# Altium project RK3288.PrjPcb (part 1 of 2)
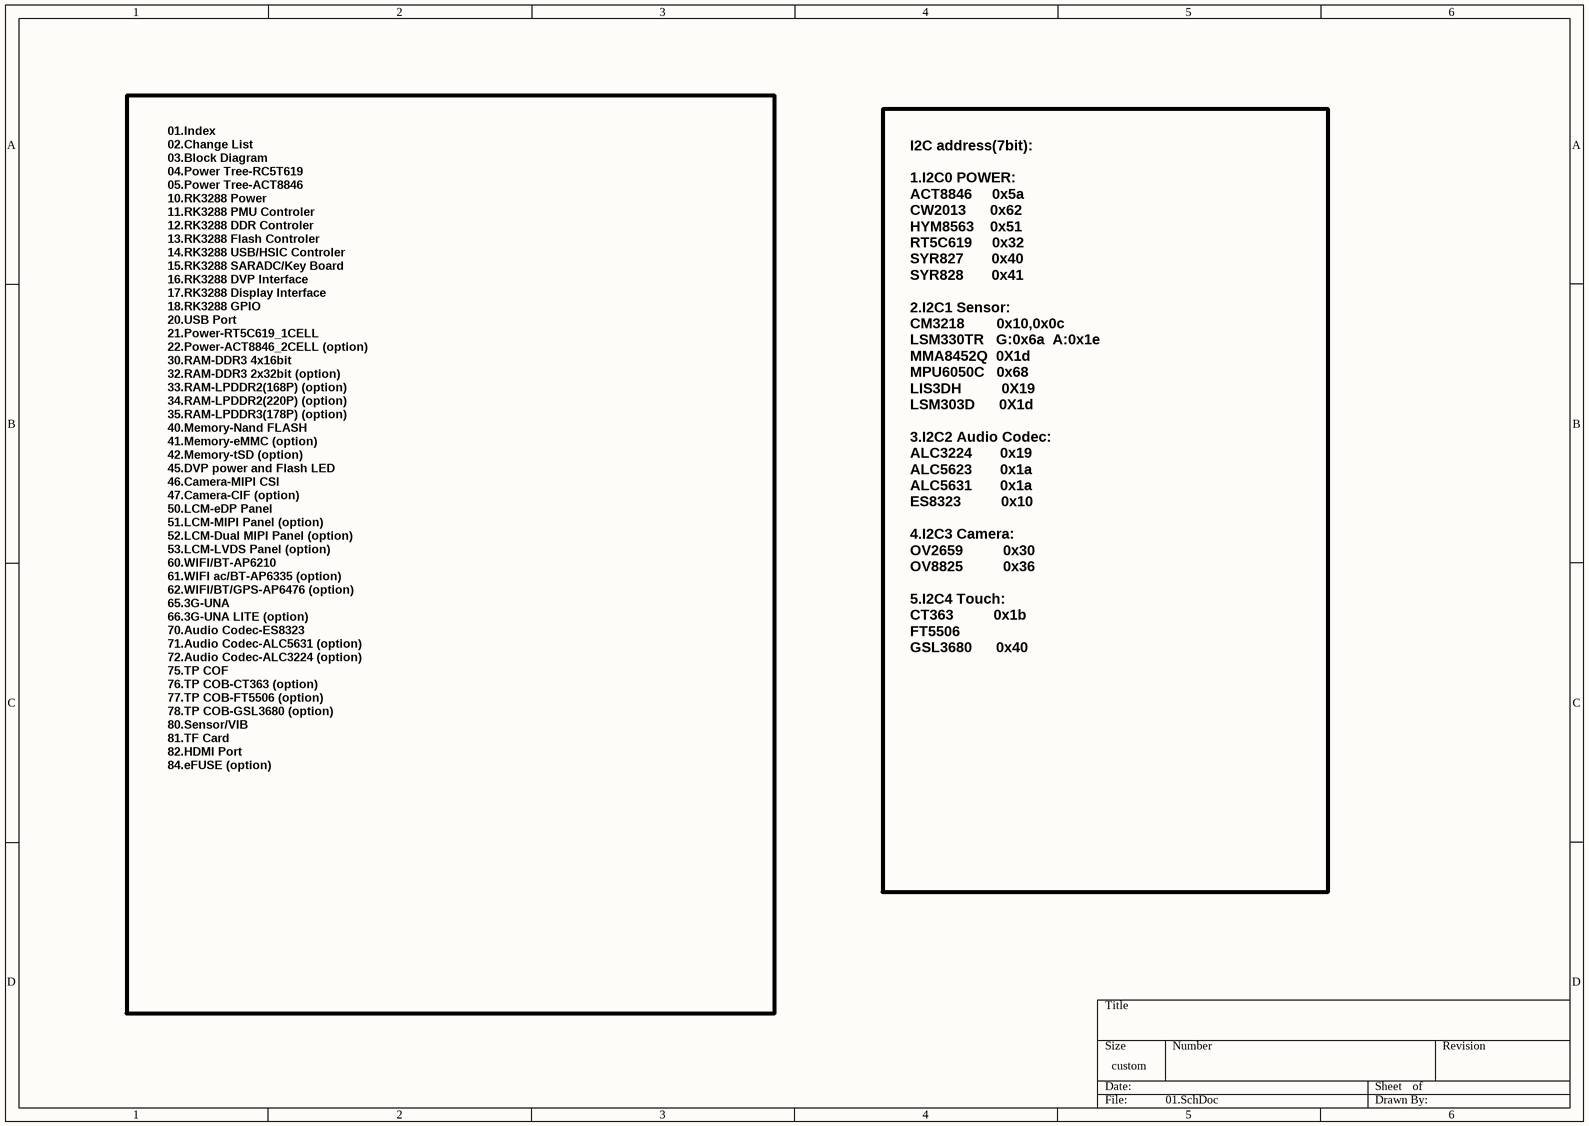
[diagram p0: 01.SchDoc]
24 sheets, 575 parts. Net scope: global (net labels, ports and power ports of the same name join across sheets).
Sheets:
  01.SchDoc
  02.SchDoc
  03.SchDoc
  04.SchDoc
  05.SchDoc
  06.SchDoc
  07.SchDoc
  08.SchDoc
  09.SchDoc
  10.SchDoc
  11.SchDoc
  13.SchDoc
  14.SchDoc
  15.SchDoc
  16.SchDoc
  17.SchDoc
  18.SchDoc
  19.SchDoc
  20.SchDoc
  21.SchDoc
  22.SchDoc
  23.SchDoc
  24.SchDoc
  25.SchDoc

## Sheet 01.SchDoc
size 297 x 209 mm

### Notes on the sheet
- 01.Index
  02.Change List
  03.Block Diagram
  04.Power Tree-RC5T619
  05.Power Tree-ACT8846
  10.RK3288 Power
  11.RK3288 PMU Controler
  12.RK3288 DDR Controler
  13.RK3288 Flash Controler
  14.RK3288 USB/HSIC Controler
  15.RK3288 SARADC/Key Board
  16.RK3288 DVP Interface
  17.RK3288 Display Interface
  18.RK3288 GPIO
  20.USB Port
  21.Power-RT5C619_1CELL
  22.Power-ACT8846_2CELL (option)
  30.RAM-DDR3 4x16bit
  32.RAM-DDR3 2x32bit (option)
  33.RAM-LPDDR2(168P) (option)
  34.RAM-LPDDR2(220P) (option)
  35.RAM-LPDDR3(178P) (option)
  40.Memory-Nand FLASH
  41.Memory-eMMC (option)
  42.Memory-tSD (option)
  45.DVP power and Flash LED
  46.Camera-MIPI CSI
  47.Camera-CIF (option)
  50.LCM-eDP Panel
  51.LCM-MIPI Panel (option)
  52.LCM-Dual MIPI Panel (option)
  53.LCM-LVDS Panel (option)
  60.WIFI/BT-AP6210
  61.WIFI ac/BT-AP6335 (option)
  62.WIFI/BT/GPS-AP6476 (option)
  65.3G-UNA
  66.3G-UNA LITE (option)
  70.Audio Codec-ES8323
  71.Audio Codec-ALC5631 (option)
  72.Audio Codec-ALC3224 (option)
  75.TP COF
  76.TP COB-CT363 (option)
  77.TP COB-FT5506 (option)
  78.TP COB-GSL3680 (option)
  80.Sensor/VIB
  81.TF Card
  82.HDMI Port
  84.eFUSE (option)
- I2C address(7bit):
  1.I2C0 POWER:
  ACT8846     0x5a
  CW2013      0x62
  HYM8563    0x51
  RT5C619     0x32
  SYR827       0x40
  SYR828       0x41
  2.I2C1 Sensor:
  CM3218        0x10,0x0c
  LSM330TR   G:0x6a  A:0x1e
  MMA8452Q  0X1d
  MPU6050C   0x68
  LIS3DH          0X19
  LSM303D      0X1d
  3.I2C2 Audio Codec:
  ALC3224       0x19
  ALC5623       0x1a
  ALC5631       0x1a
  ES8323          0x10
  4.I2C3 Camera:
  OV2659          0x30
  OV8825          0x36
  5.I2C4 Touch:
  CT363          0x1b
  FT5506
  GSL3680      0x40

## Sheet 02.SchDoc
size 297 x 209 mm
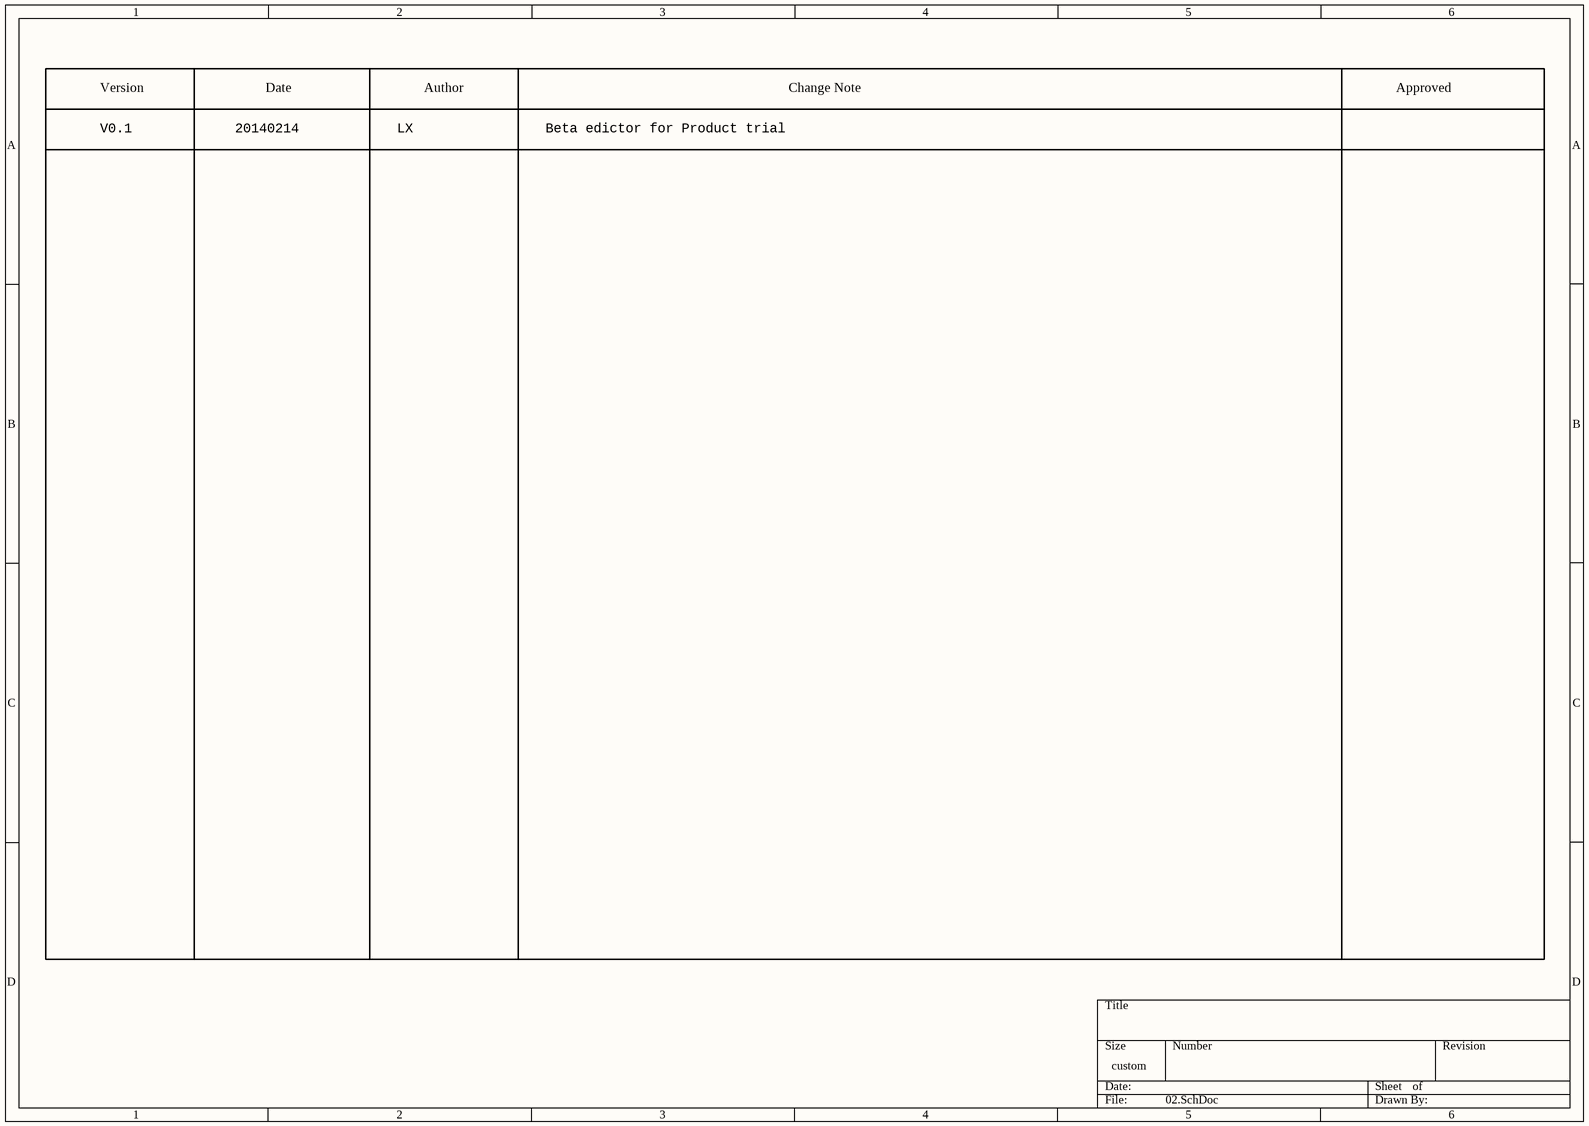
[diagram p1: 02.SchDoc]

### Notes on the sheet
- Version
- V0.1
- 20140214
- Date
- LX
- Author
- Beta edictor for Product trial
- Change Note
- Approved

## Sheet 03.SchDoc
size 420 x 297 mm
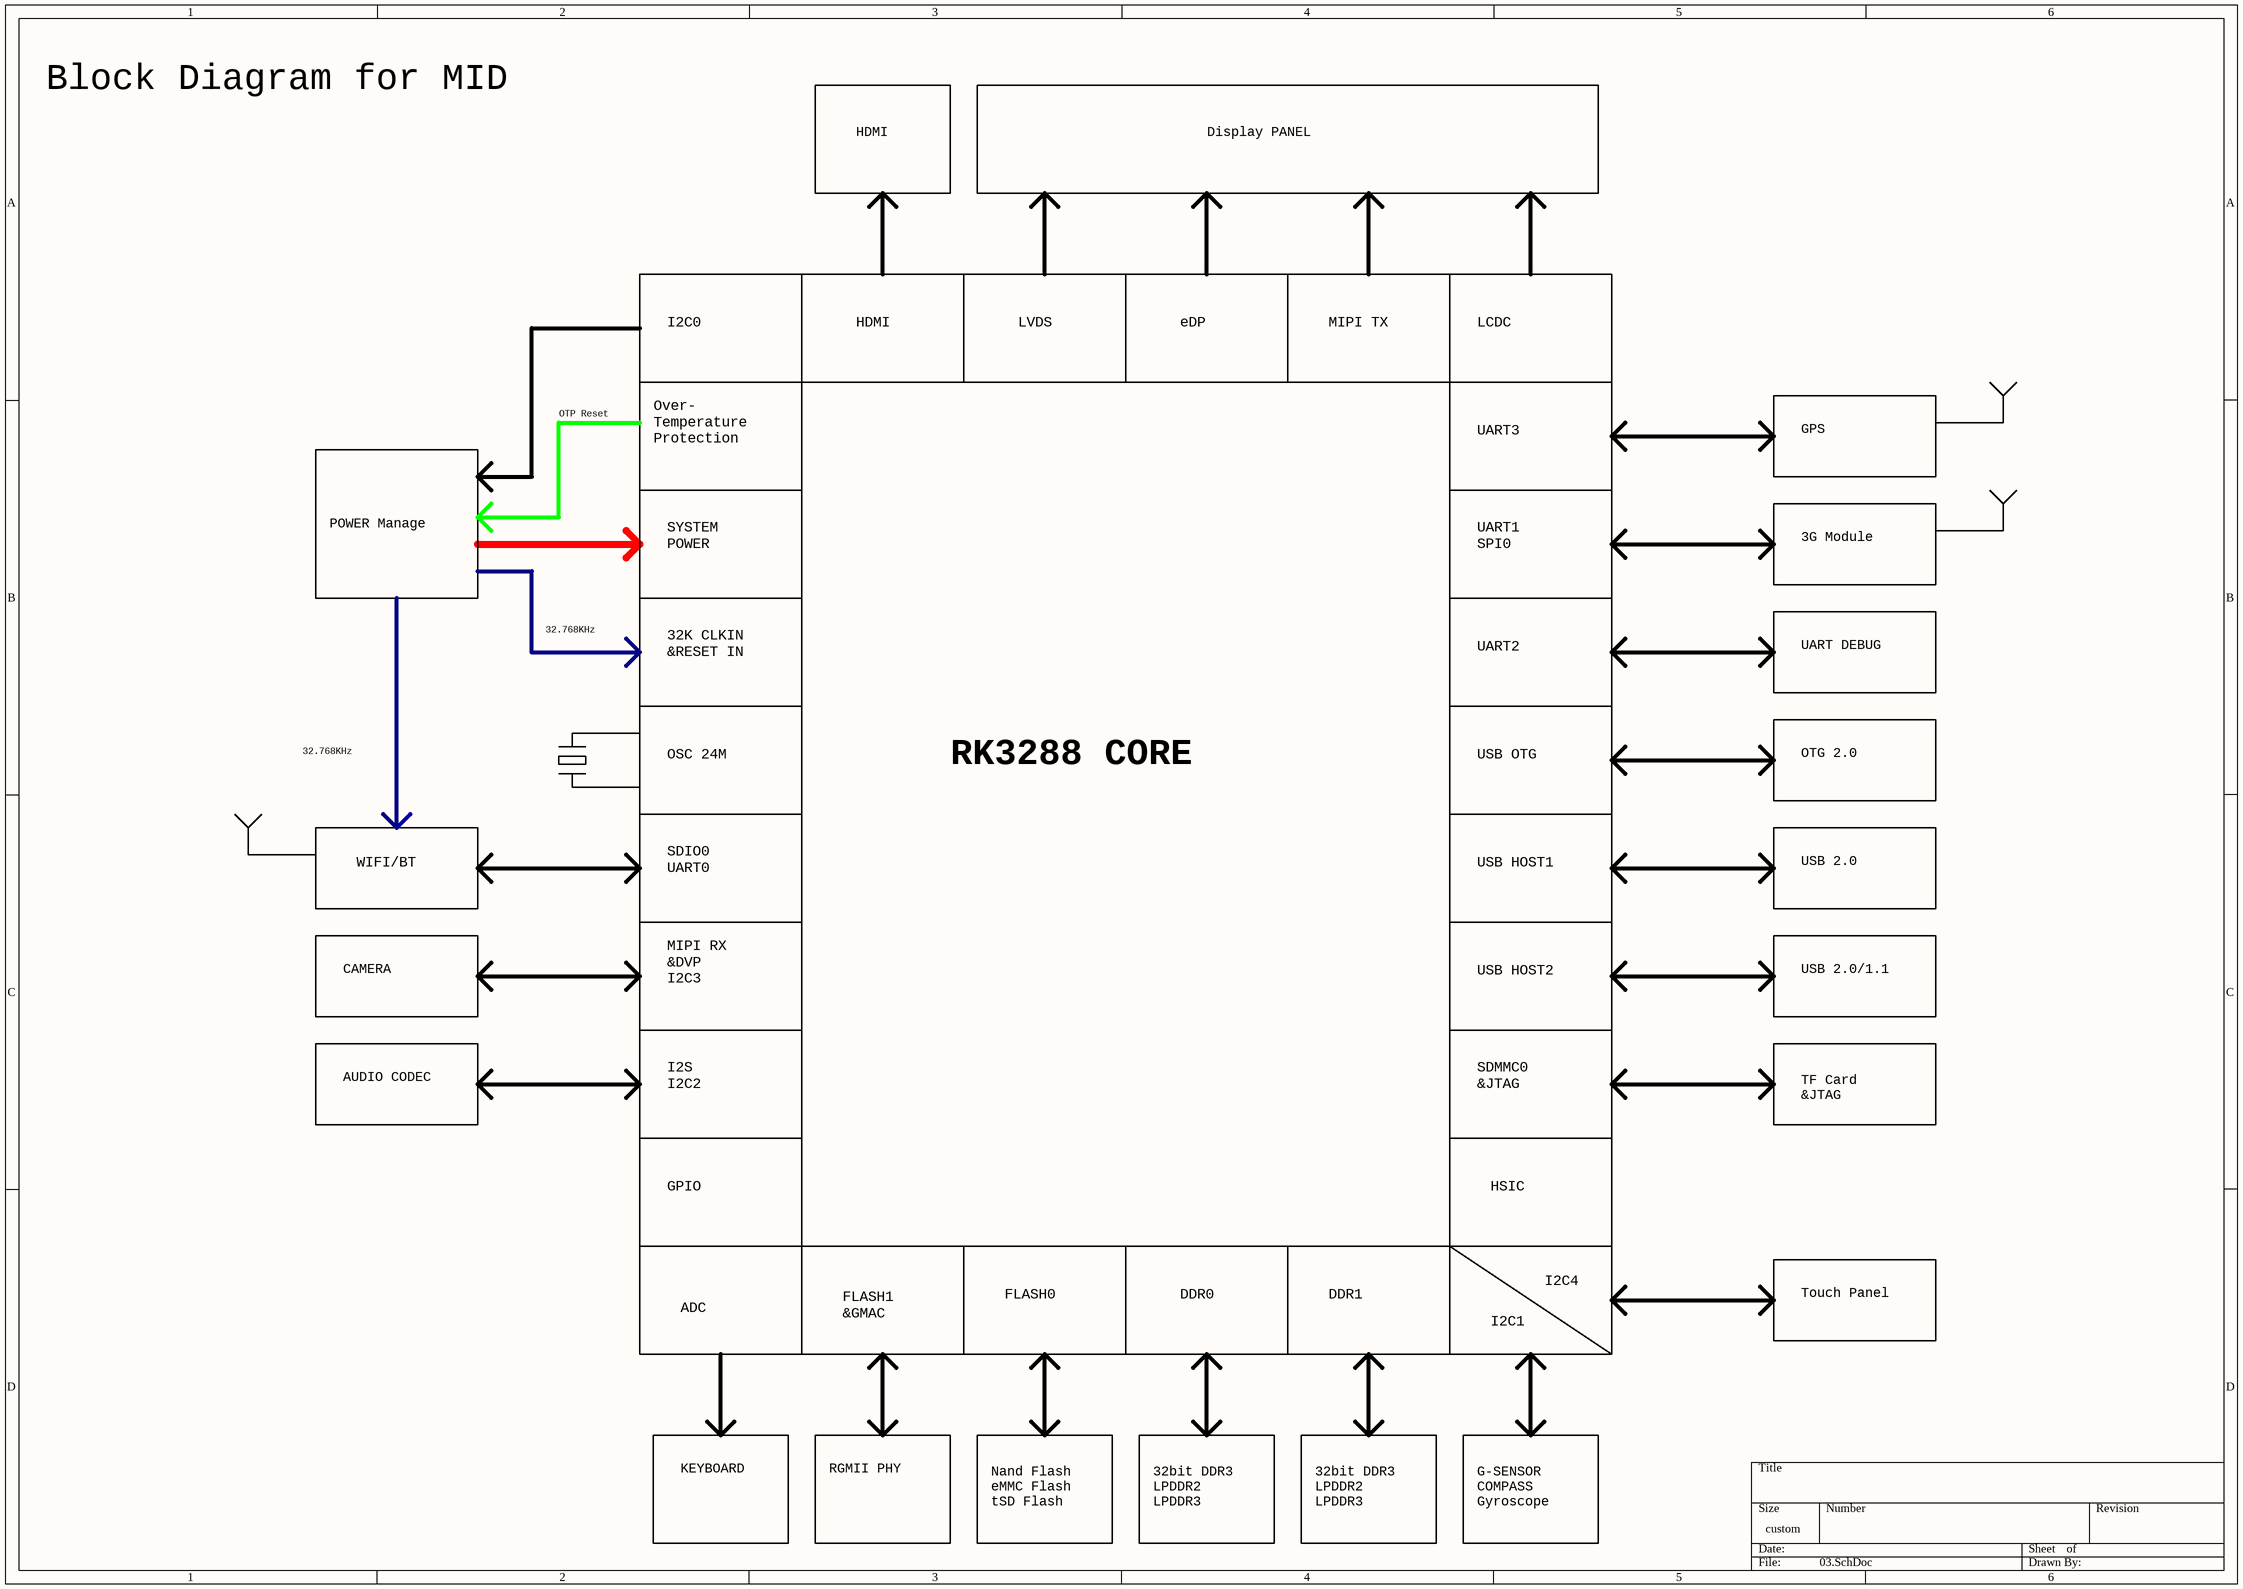
[diagram p2: 03.SchDoc]

### Notes on the sheet
- Block Diagram for MID
- HDMI
- Display PANEL
- I2C0
- LVDS
- eDP
- MIPI TX
- LCDC
- Over-
  Temperature
  Protection
- OTP Reset
- UART3
- GPS
- POWER Manage
- SYSTEM
  POWER
- UART1
  SPI0
- 3G Module
- 32.768KHz
- 32K CLKIN
  &RESET IN
- UART2
- UART DEBUG
- OSC 24M
- RK3288 CORE
- USB OTG
- OTG 2.0
- WIFI/BT
- SDIO0
  UART0
- USB HOST1
- USB 2.0
- MIPI RX
  &DVP
  I2C3
- CAMERA
- USB HOST2
- USB 2.0/1.1
- I2S
  I2C2
- SDMMC0
  &JTAG
- TF Card
  &JTAG
- AUDIO CODEC
- GPIO
- HSIC
- ADC
- FLASH1
  &GMAC
- FLASH0
- DDR0
- DDR1
- I2C1
- I2C4
- Touch Panel
- KEYBOARD
- RGMII PHY
- Nand Flash
  eMMC Flash
  tSD Flash
- 32bit DDR3
  LPDDR2
  LPDDR3
- G-SENSOR
  COMPASS
  Gyroscope

## Sheet 04.SchDoc
size 420 x 297 mm
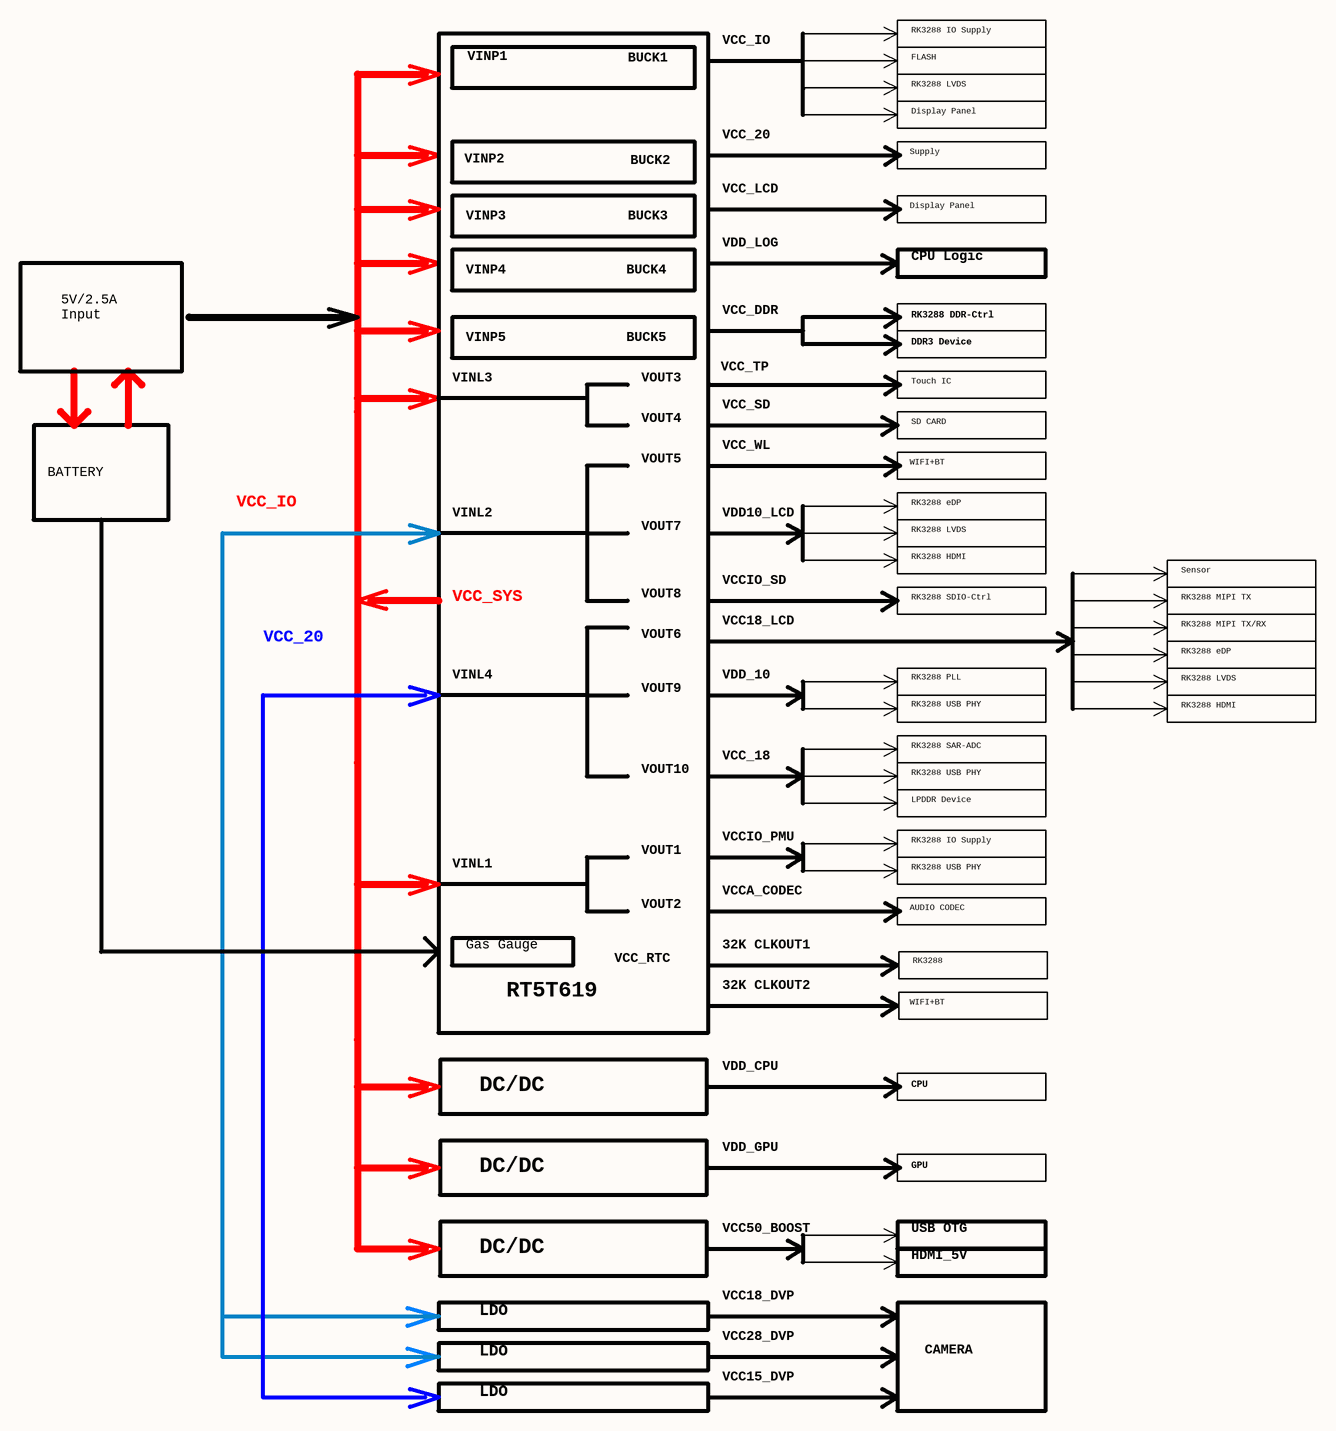
[diagram p3: 04.SchDoc]

### Notes on the sheet
- VINP1
- BUCK1
- VCC_IO
- RK3288 IO Supply
- FLASH
- VCC_20
- RK3288 LVDS
- Display Panel
- VINP2
- BUCK2
- VCC_LCD
- Supply
- VINP4
- VINP3
- BUCK4
- BUCK3
- VDD_LOG
- CPU Logic
- 5V/2.5A
  Input
- VINP5
- BUCK5
- VCC_DDR
- RK3288 DDR-Ctrl
- DDR3 Device
- VINL3
- VOUT3
- VCC_TP
- VCC_SD
- Touch IC
- BATTERY
- VOUT4
- VOUT5
- VCC_WL
- WIFI+BT
- SD CARD
- VINL2
- VOUT7
- VDD10_LCD
- RK3288 eDP
- VCC_SYS
- VOUT8
- VCCIO_SD
- RK3288 HDMI
- RK3288 SDIO-Ctrl
- RK3288 MIPI TX
- Sensor
- VINL4
- VOUT6
- VCC18_LCD
- VDD_10
- RK3288 PLL
- RK3288 MIPI TX/RX
- VOUT9
- RK3288 SAR-ADC
- RK3288 USB PHY
- VOUT10
- VCC_18
- LPDDR Device
- VINL1
- VOUT1
- VCCIO_PMU
- Gas Gauge
- VOUT2
- VCCA_CODEC
- 32K CLKOUT1
- AUDIO CODEC
- RT5T619
- VCC_RTC
- 32K CLKOUT2
- RK3288
- VDD_CPU
- CPU
- DC/DC
- VDD_GPU
- GPU
- VCC50_BOOST
- USB OTG
- HDMI_5V
- LDO
- VCC18_DVP
- VCC28_DVP
- CAMERA
- VCC15_DVP

## Sheet 05.SchDoc
size 496 x 347 mm
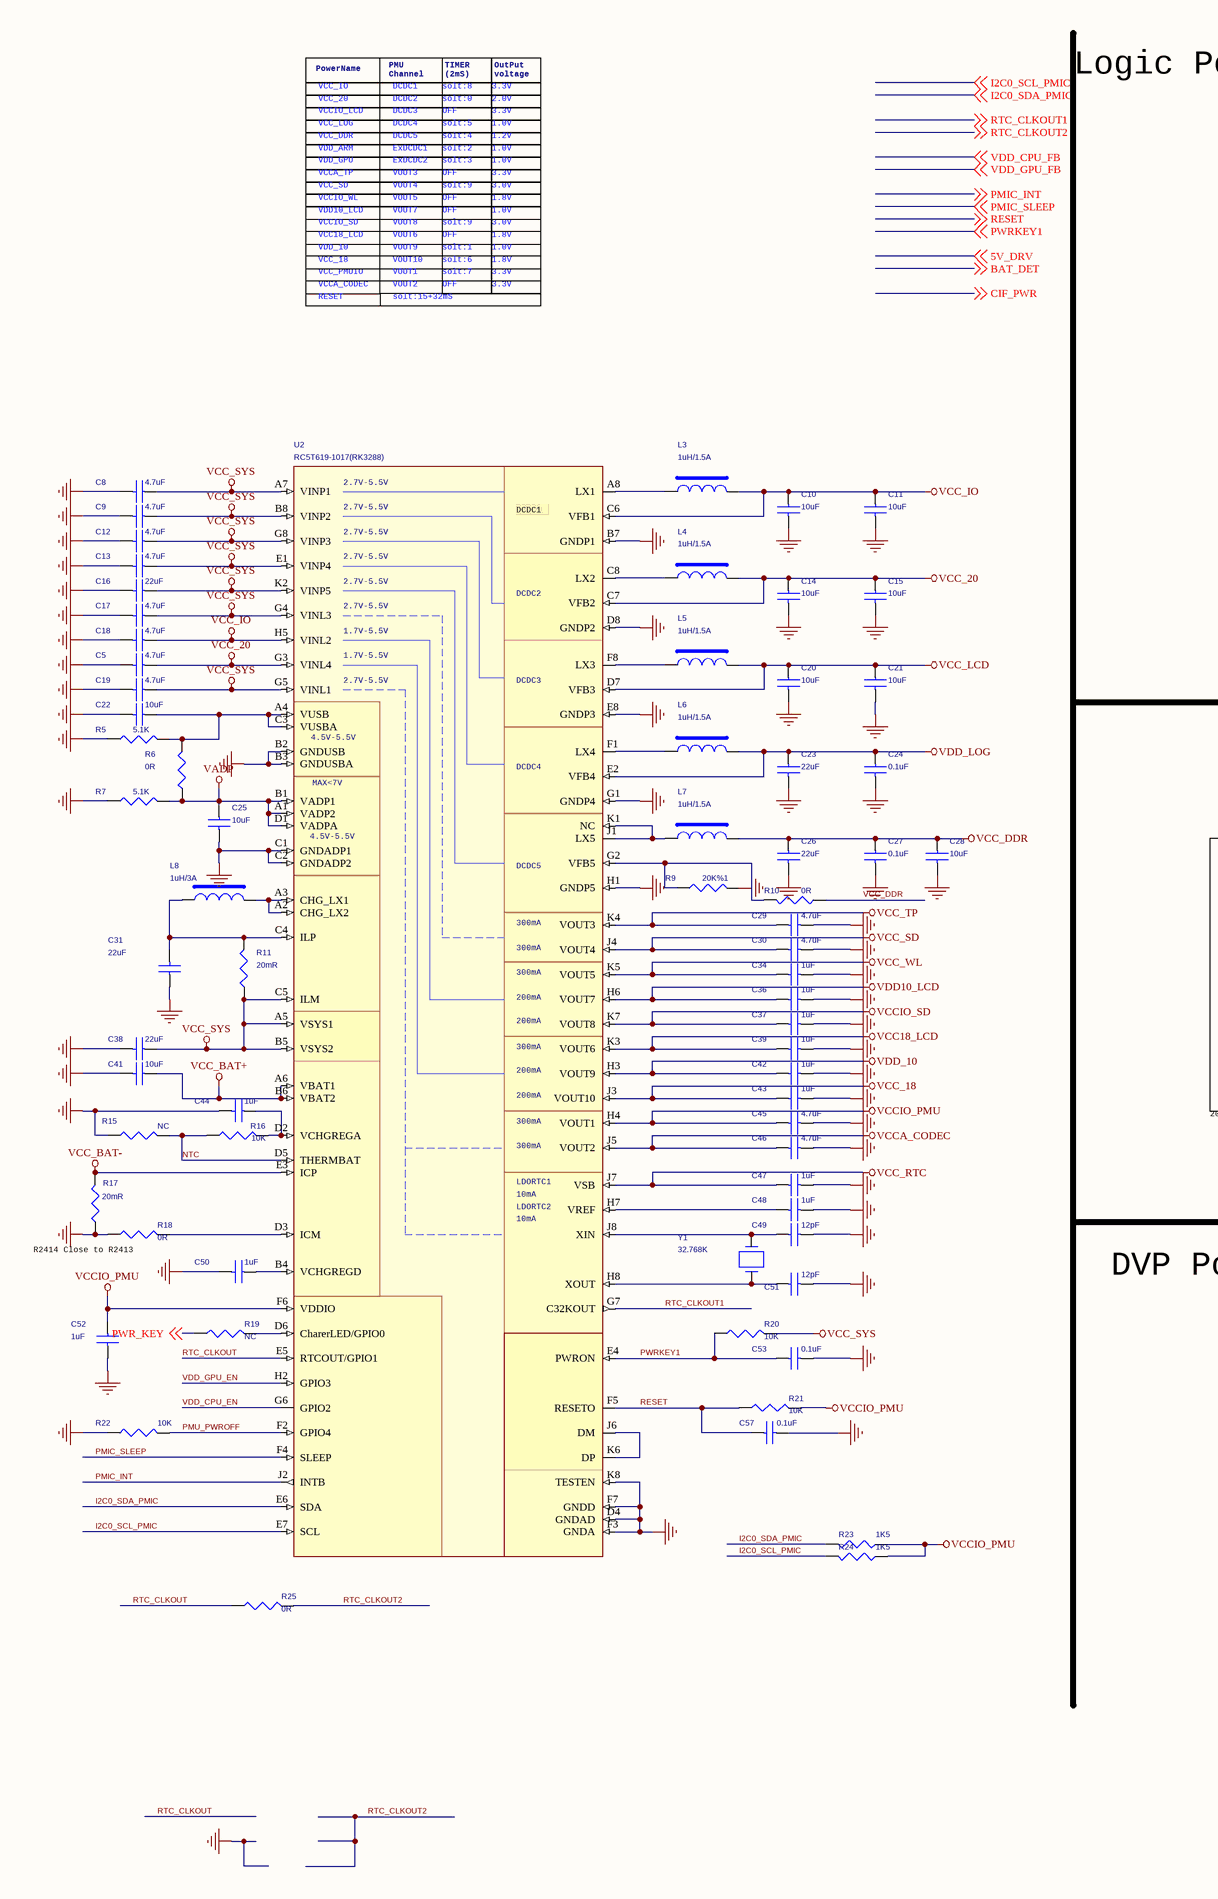
[diagram p4: 05.SchDoc, left]
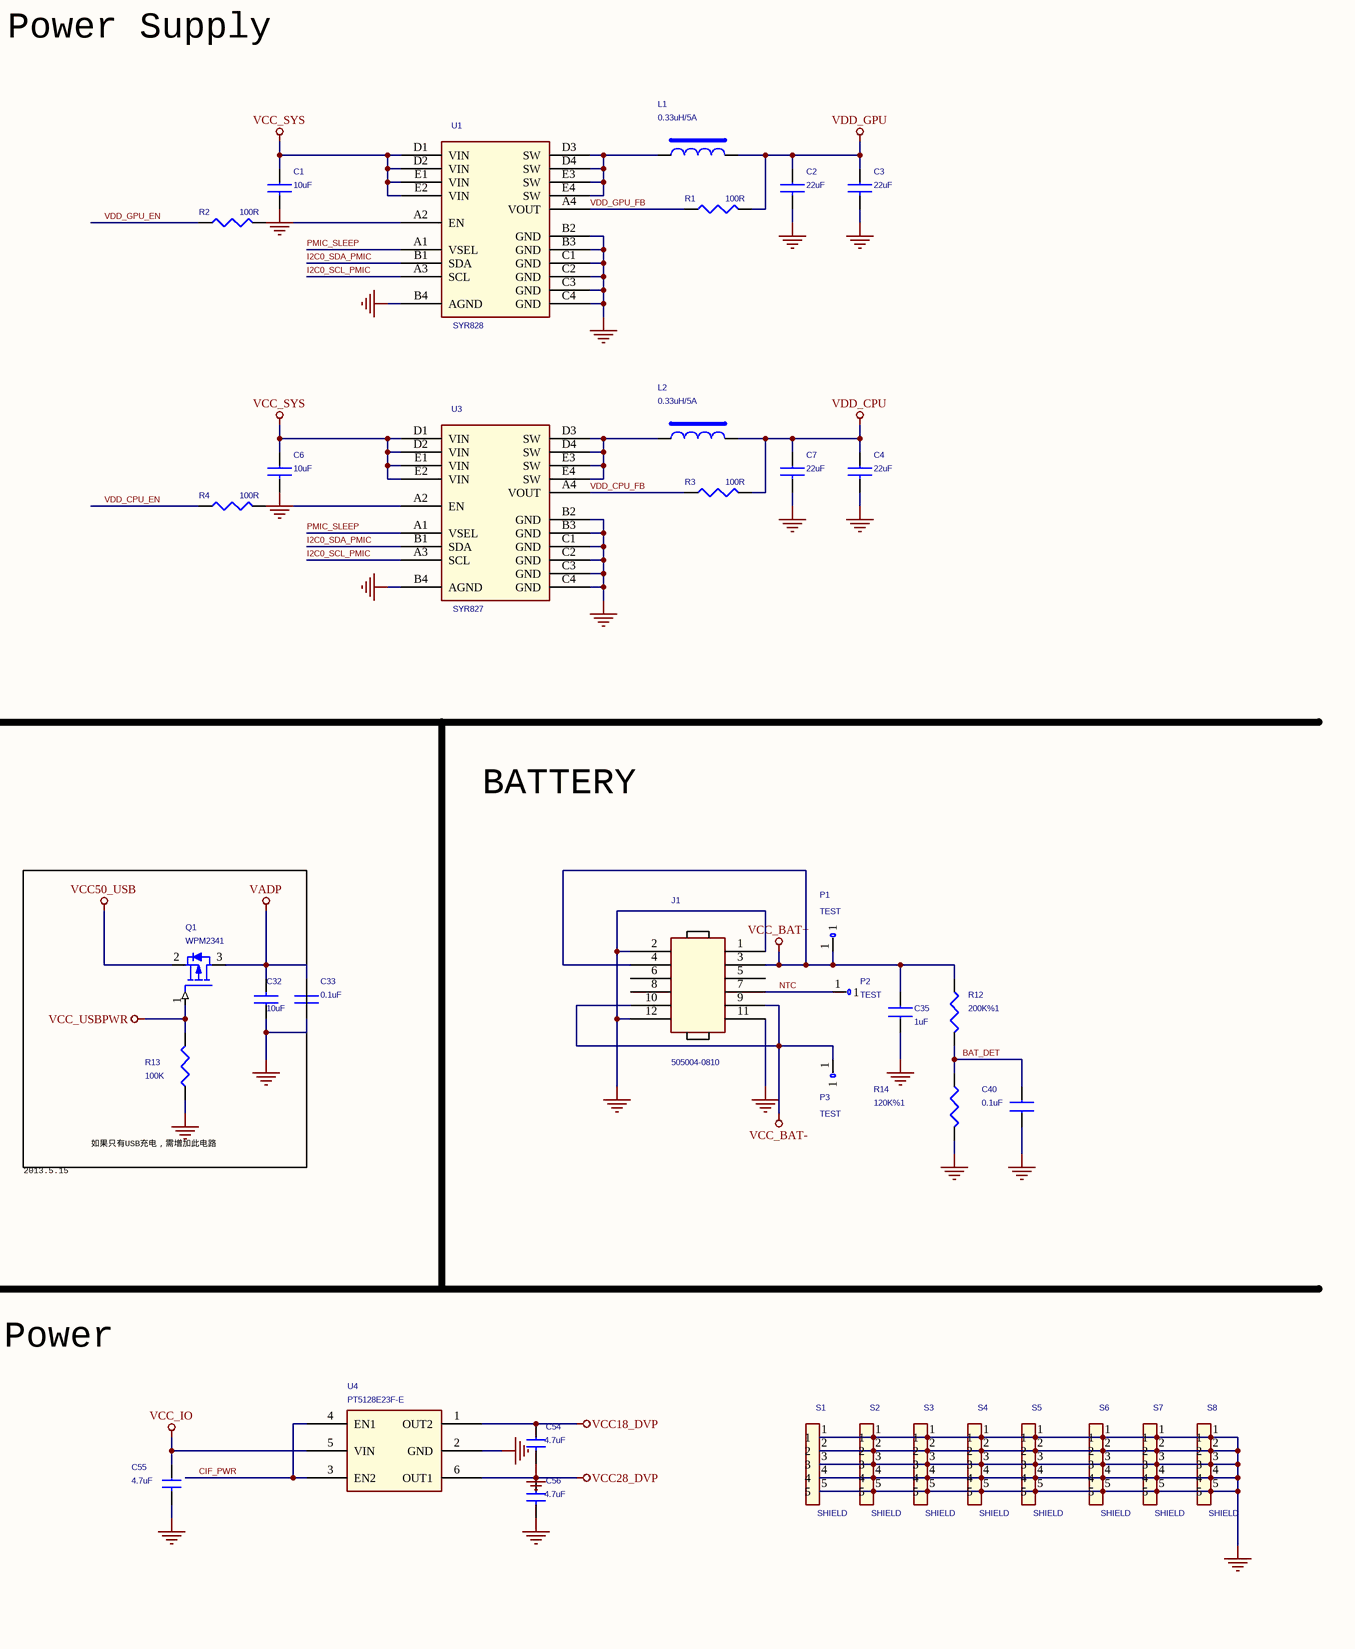
[diagram p5: 05.SchDoc, right]

### Parts
C1  10uF  [C0603]
C2  22uF  [C0805]
C3  22uF  [C0805]
C4  22uF  [C0805]
C5  4.7uF  [C0603]
C6  10uF  [C0603]
C7  22uF  [C0805]
C8  4.7uF  [C0603]
C9  4.7uF  [C0603]
C10  10uF  [C0603]
C11  10uF  [C0603]
C12  4.7uF  [C0603]
C13  4.7uF  [C0603]
C14  10uF  [C0603]
C15  10uF  [C0603]
C16  22uF  [C0805]
C17  4.7uF  [C0603]
C18  4.7uF  [C0603]
C19  4.7uF  [C0603]
C20  10uF  [C0603]
C21  10uF  [C0603]
C22  10uF  [C0603]
C23  22uF  [C0805]
C24  0.1uF  [c0402]
C25  10uF  [C0603]
C26  22uF  [C0805]
C27  0.1uF  [c0402]
C28  10uF  [C0603]
C29  4.7uF  [C0603]
C30  4.7uF  [C0603]
C31  22uF  [C0805]
C32  10uF  [C0603]
C33  0.1uF  [C0402]
C34  1uF  [c0402]
C35  1uF  [C0603]
C36  1uF  [c0402]
C37  1uF  [c0402]
C38  22uF  [C0805]
C39  1uF  [c0402]
C40  0.1uF  [C0603]
C41  10uF  [C0603]
C42  1uF  [c0402]
C43  1uF  [c0402]
C44  1uF  [c0402]
C45  4.7uF  [C0603]
C46  4.7uF  [C0603]
C47  1uF  [c0402]
C48  1uF  [c0402]
C49  12pF  [c0402]
C50  1uF  [c0402]
C51  12pF  [c0402]
C52  1uF  [c0402]
C53  0.1uF  [c0402]
C54  4.7uF  [C0603]
C55  4.7uF  [C0603]
C56  4.7uF  [C0603]
C57  0.1uF  [c0402]
J1  505004-0810  [505004-0810]
L1  0.33uH/5A  [IND-4X4]
L2  0.33uH/5A  [IND-4X4]
L3  1uH/1.5A  [IND-3X3]
L4  1uH/1.5A  [IND-3X3]
L5  1uH/1.5A  [IND-3X3]
L6  1uH/1.5A  [IND-3X3]
L7  1uH/1.5A  [IND-3X3]
L8  1uH/3A  [IND-5X5]
P1  TEST  [TEST]
P2  TEST  [TEST]
P3  TEST  [TEST]
Q1  WPM2341  [SOT23]
R1  100R  [r0402]
R2  100R  [r0402]
R3  100R  [r0402]
R4  100R  [r0402]
R5  5.1K  [r0402]
R6  0R  [R0402]
R7  5.1K  [r0402]
R9  20K%1  [r0402]
R10  0R  [r0402]
R11  20mR  [R1210]
R12  200K%1  [r0402]
R13  100K  [r0402]
R14  120K%1  [r0402]
R15  NC  [r0402]
R16  10K  [r0402]
R17  20mR  [R1210]
R18  0R  [r0402]
R19  NC  [r0402]
R20  10K  [r0402]
R21  10K  [r0402]
R22  10K  [r0402]
R23  1K5  [r0402]
R24  1K5  [r0402]
R25  0R  [r0402]
S1  SHIELD  [0_9MM_SHIELD]
S2  SHIELD  [0_9MM_SHIELD]
S3  SHIELD  [0_9MM_SHIELD]
S4  SHIELD  [0_9MM_SHIELD]
S5  SHIELD  [0_9MM_SHIELD]
S6  SHIELD  [0_9MM_SHIELD]
S7  SHIELD  [0_9MM_SHIELD]
S8  SHIELD  [0_9MM_SHIELD]
U1  SYR828  [WLCSP-20]
U2  RC5T619-1017(RK3288)  [CSP0608-80]
U3  SYR827  [WLCSP-20]
U4  PT5128E23F-E  [SOT26]
Y1  32.768K  [CRY-MC146]

### Blocks framed on the sheet
如果只有USB充电，需增加此电路: C32 Q1 R13

### Nets
GND: C1.2 C2.2 C3.2 C4.2 C5.2 C6.2 C7.2 C8.2 C9.2 C10.2 C11.2 C12.2 C13.2 C14.2 C15.2 C16.2 C17.2 C18.2 C19.2 C20.2 C21.2 C22.2 C23.2 C24.2 C25.2 C26.2 C27.2 C28.2 C29.2 C30.2 C31.1 C32.1 C33.1 C34.2 C35.1 C36.2 C37.2 C38.2 C39.2 C40.1 C41.2 C42.2 C43.2 C44.2 C45.2 C46.2 C47.2 C48.2 C49.2 C50.2 C51.2 C52.2 C53.2 C54.2 C55.2 C56.2 C57.2 J1.1 J1.2 J1.11 J1.12 R5.1 R7.1 R9.2 R13.1 R14.1 R15.2 R17.1 R18.2 R22.1 S1.1 S1.2 S1.3 S1.4 S1.5 S2.1 S2.2 S2.3 S2.4 S2.5 S3.1 S3.2 S3.3 S3.4 S3.5 S4.1 S4.2 S4.3 S4.4 S4.5 S5.1 S5.2 S5.3 S5.4 S5.5 S6.1 S6.2 S6.3 S6.4 S6.5 S7.1 S7.2 S7.3 S7.4 S7.5 S8.1 S8.2 S8.3 S8.4 S8.5 U1.B2(GND) U1.B3(GND) U1.B4(AGND) U1.C1(GND) U1.C2(GND) U1.C3(GND) U1.C4(GND) U2.B2(GNDUSB) U2.B3(GNDUSBA) U2.B7(GNDP1) U2.C1(GNDADP1) U2.C2(GNDADP2) U2.D4(GNDAD) U2.D8(GNDP2) U2.E8(GNDP3) U2.F3(GNDA) U2.F7(GNDD) U2.G1(GNDP4) U2.H1(GNDP5) U2.K8(TESTEN) U3.B2(GND) U3.B3(GND) U3.B4(AGND) U3.C1(GND) U3.C2(GND) U3.C3(GND) U3.C4(GND) U4.2(GND)
VADP: C25.1 C32.2 C33.2 Q1.3(DRAIN) R6.1 R7.2 U2.A1(VADP2) U2.B1(VADP1) U2.D1(VADPA)
VCC18_DVP: C54.1 U4.1(OUT2)
VCC18_LCD: C39.1 U2.K3(VOUT6)
VCC28_DVP: C56.1 U4.6(OUT1)
VCC50_USB: Q1.2(SOURCE)
VCC_18: C43.1 U2.J3(VOUT10)
VCC_20: C5.1 C14.1 C15.1 L4.2 U2.C7(VFB2) U2.G3(VINL4)
VCC_BAT+: C35.2 C41.1 J1.3 J1.4 P1.1 R12.2 U2.A6(VBAT1) U2.B6(VBAT2)
VCC_BAT-: J1.9 J1.10 P3.1 R17.2 U2.E3(ICP)
VCC_DDR: C26.1 C27.1 C28.1 L7.2 R10.1
VCC_IO: C10.1 C11.1 C18.1 C55.1 L3.2 U2.C6(VFB1) U2.H5(VINL2) U4.5(VIN)
VCC_LCD: C20.1 C21.1 L5.2 U2.D7(VFB3)
VCC_RTC: C47.1 U2.J7(VSB)
VCC_SD: C30.1 U2.J4(VOUT4)
VCC_SYS: C1.1 C6.1 C8.1 C9.1 C12.1 C13.1 C16.1 C17.1 C19.1 C38.1 R11.1 R20.2 U1.D1(VIN) U1.D2(VIN) U1.E1(VIN) U1.E2(VIN) U2.A5(VSYS1) U2.A7(VINP1) U2.B5(VSYS2) U2.B8(VINP2) U2.C5(ILM) U2.E1(VINP4) U2.G4(VINL3) U2.G5(VINL1) U2.G8(VINP3) U2.K2(VINP5) U3.D1(VIN) U3.D2(VIN) U3.E1(VIN) U3.E2(VIN)
VCC_TP: C29.1 U2.K4(VOUT3)
VCC_USBPWR: Q1.1(GATE) R13.2
VCC_WL: C34.1 U2.K5(VOUT5)
VCCA_CODEC: C46.1 U2.J5(VOUT2)
VCCIO_PMU: C45.1 C52.1 R21.1 R23.2 R24.2 U2.F6(VDDIO) U2.H4(VOUT1)
VCCIO_SD: C37.1 U2.K7(VOUT8)
VDD10_LCD: C36.1 U2.H6(VOUT7)
VDD_10: C42.1 U2.H3(VOUT9)
VDD_CPU: C4.1 C7.1 L2.2 R3.1
VDD_GPU: C2.1 C3.1 L1.2 R1.1
VDD_LOG: C23.1 C24.1 L6.2 U2.E2(VFB4)
BAT_DET: C40.2 R12.1 R14.2 ; off-sheet BAT_DET
CIF_PWR: U4.3(EN2) U4.4(EN1) ; off-sheet CIF_PWR
I2C0_SCL_PMIC: R24.1 U1.A3(SCL) U2.E7(SCL) U3.A3(SCL) ; off-sheet I2C0_SCL_PMIC
I2C0_SDA_PMIC: R23.1 U1.B1(SDA) U2.E6(SDA) U3.B1(SDA) ; off-sheet I2C0_SDA_PMIC
NTC: J1.7 P2.1 R15.1 R16.2 U2.D5(THERMBAT)
PMIC_INT: U2.J2(INTB) ; off-sheet PMIC_INT
PMIC_SLEEP: U1.A1(VSEL) U2.F4(SLEEP) U3.A1(VSEL) ; off-sheet PMIC_SLEEP
PMU_PWROFF: R22.2 U2.F2(GPIO4)
PWR_KEY: R19.1 ; off-sheet PWR_KEY
PWRKEY1: C53.1 R20.1 U2.E4(PWRON) ; off-sheet PWRKEY1
RESET: C57.1 R21.2 U2.F5(RESETO) ; off-sheet RESET
RTC_CLKOUT: R25.2 U2.E5(RTCOUT/GPIO1)
RTC_CLKOUT1: U2.G7(C32KOUT) ; off-sheet RTC_CLKOUT1
RTC_CLKOUT2: R25.1 ; off-sheet RTC_CLKOUT2
VDD_CPU_EN: R4.2 U2.G6(GPIO2)
VDD_CPU_FB: R3.2 U3.A4(VOUT) ; off-sheet VDD_CPU_FB
VDD_GPU_EN: R2.2 U2.H2(GPIO3)
VDD_GPU_FB: R1.2 U1.A4(VOUT) ; off-sheet VDD_GPU_FB
NetC22_1: C22.1 R5.2 R6.2 U2.A4(VUSB) U2.C3(VUSBA)
NetC31_2: C31.2 L8.1 R11.2 U2.C4(ILP)
NetC44_1: C44.1 R16.1 U2.D2(VCHGREGA)
NetC48_1: C48.1 U2.H7(VREF)
NetC49_1: C49.1 U2.J8(XIN) Y1.1
NetC50_1: C50.1 U2.B4(VCHGREGD)
NetC51_1: C51.1 U2.H8(XOUT) Y1.2
NetL1_1: L1.1 U1.D3(SW) U1.D4(SW) U1.E3(SW) U1.E4(SW)
NetL2_1: L2.1 U3.D3(SW) U3.D4(SW) U3.E3(SW) U3.E4(SW)
NetL3_1: L3.1 U2.A8(LX1)
NetL4_1: L4.1 U2.C8(LX2)
NetL5_1: L5.1 U2.F8(LX3)
NetL6_1: L6.1 U2.F1(LX4)
NetL7_1: L7.1 U2.J1(LX5) U2.K1(NC)
NetL8_2: L8.2 U2.A2(CHG_LX2) U2.A3(CHG_LX1)
NetR2_1: R2.1 U1.A2(EN)
NetR4_1: R4.1 U3.A2(EN)
NetR9_1: R9.1 R10.2 U2.G2(VFB5)
NetR18_1: R18.1 U2.D3(ICM)
NetR19_2: R19.2 U2.D6(CharerLED/GPIO0)
NetU2_J6: U2.J6(DM) U2.K6(DP)

Not connected (* = marked no-connect by the designer): J1 5 6 8

### Notes on the sheet
- PowerName
- VCCIO_LCD
- VCC_IO
- VCC_20
- PMU
  Channel
- DCDC1
- DCDC3
- DCDC2
- solt:8
- solt:0
- OFF
- TIMER
  (2mS)
- 3.3V
- 2.0V
- OutPut
  voltage
- Logic Power Supply
- VDD_ARM
- VCC_DDR
- VCC_LOG
- VDD_GPU
- VCCA_TP
- ExDCDC2
- DCDC4
- ExDCDC1
- VOUT3
- DCDC5
- solt:4
- solt:2
- solt:5
- solt:3
- 1.0V
- 1.2V
- VCC_SD
- VCCIO_WL
- VCC18_LCD
- VDD10_LCD
- VCCIO_SD
- VOUT4
- VOUT6
- VOUT8
- VOUT7
- VOUT5
- solt:9
- 3.0V
- 1.8V
- VCCA_CODEC
- VCC_18
- VDD_10
- VCC_PMUIO
- RESET
- VOUT2
- VOUT10
- VOUT9
- VOUT1
- solt:15+32mS
- solt:6
- solt:1
- solt:7
- BATTERY
- 2013.5.15
- R2414 Close to R2413
- DVP Power
- (in symbol 5T619_2) 2.7V-5.5V; DCDC1 /; DCDC2; 1.7V-5.5V; DCDC3; 4.5V-5.5V; DCDC4; MAX<7V; DCDC5; 300mA; 200mA; LDORTC1; 10mA; LDORTC2

### Library data of the parts
C1-C4 C6 C7 C49 C51 = CAP NP_4: ROOM: 5
C5 C8-C31 C34 C36-C39 C41-C48 C50 C52 C53 C57 = CAP NP_2: ROOM: 5
C32 = CAP NP_1: RoHS CHIP CAP 10uF +10/-10% X5R; ROOM: 5; MARK: 106
C33 = CAP NP_Dup2: RoHS CHIP CAP 0.1uF +10/-10% X7R; ROOM: 5
C35 = CAP NP_Dup3: RoHS CHIP CAP 1uF +10/-10% 16V X5R; ROOM: 5
C40 = CAP NP_Dup3: RoHS CHIP CAP 0.1uF +10/-10% X7R; ROOM: 5
C54-C56 = SMALL CAP: 贴片电容; ROOM: 5
J1 = HEADER 6X2: ROOM: 5
L1-L8 = INDUCTORS OF FERRITE_Dup1: ROOM: 5
P1-P3 = TEST_0: ROOM: 5
Q1 = MOSFET P: MOSFET-P,WPM2341 ,-20V,+/-8V,-2.8A,56m Ohm@Vgs=-2.5V,44m Ohm@Vgs=-4.5V,SOT23; ROOM: 5
R1-R4 R23 R24 = RESISTOR_1_Dup2: RES,thick film,47KOhm,+/-5%,1/16W,SMD0402; ROOM: 5
R5 R7 R9 R17 R18 R21 R22 R25 = RESISTOR_1: 贴片电阻; MARK: 51K; ROOM: 5
R6 R10 R11 R15 R16 R19 R20 = RESISTOR_1: 贴片电阻; ROOM: 5; MARK: 51K
R12 R14 = RES 1B_Dup1: ROHS CHIP RES 100K 1/16W 1%; ROOM: 5
R13 = RESISTOR: ROHS CHIP RES 10K 1/16W +/-5%; ROOM: 5; MARK: 51K
S1-S8 = SHIELD: ROOM: 5
U1 U3 = BB27_1: ROOM: 5
U2 = 5T619_2: ROOM: 5
U4 = PT5127: ROOM: 5; Name: INS52770960
Y1 = CRYSTAL: Crystal,32.768KHz,+/-30ppm,12pF,MC146,-10°C ~ +60   °C; ROOM: 5; Part Type: 晶体类\无源晶体

## Sheet 06.SchDoc
size 420 x 297 mm
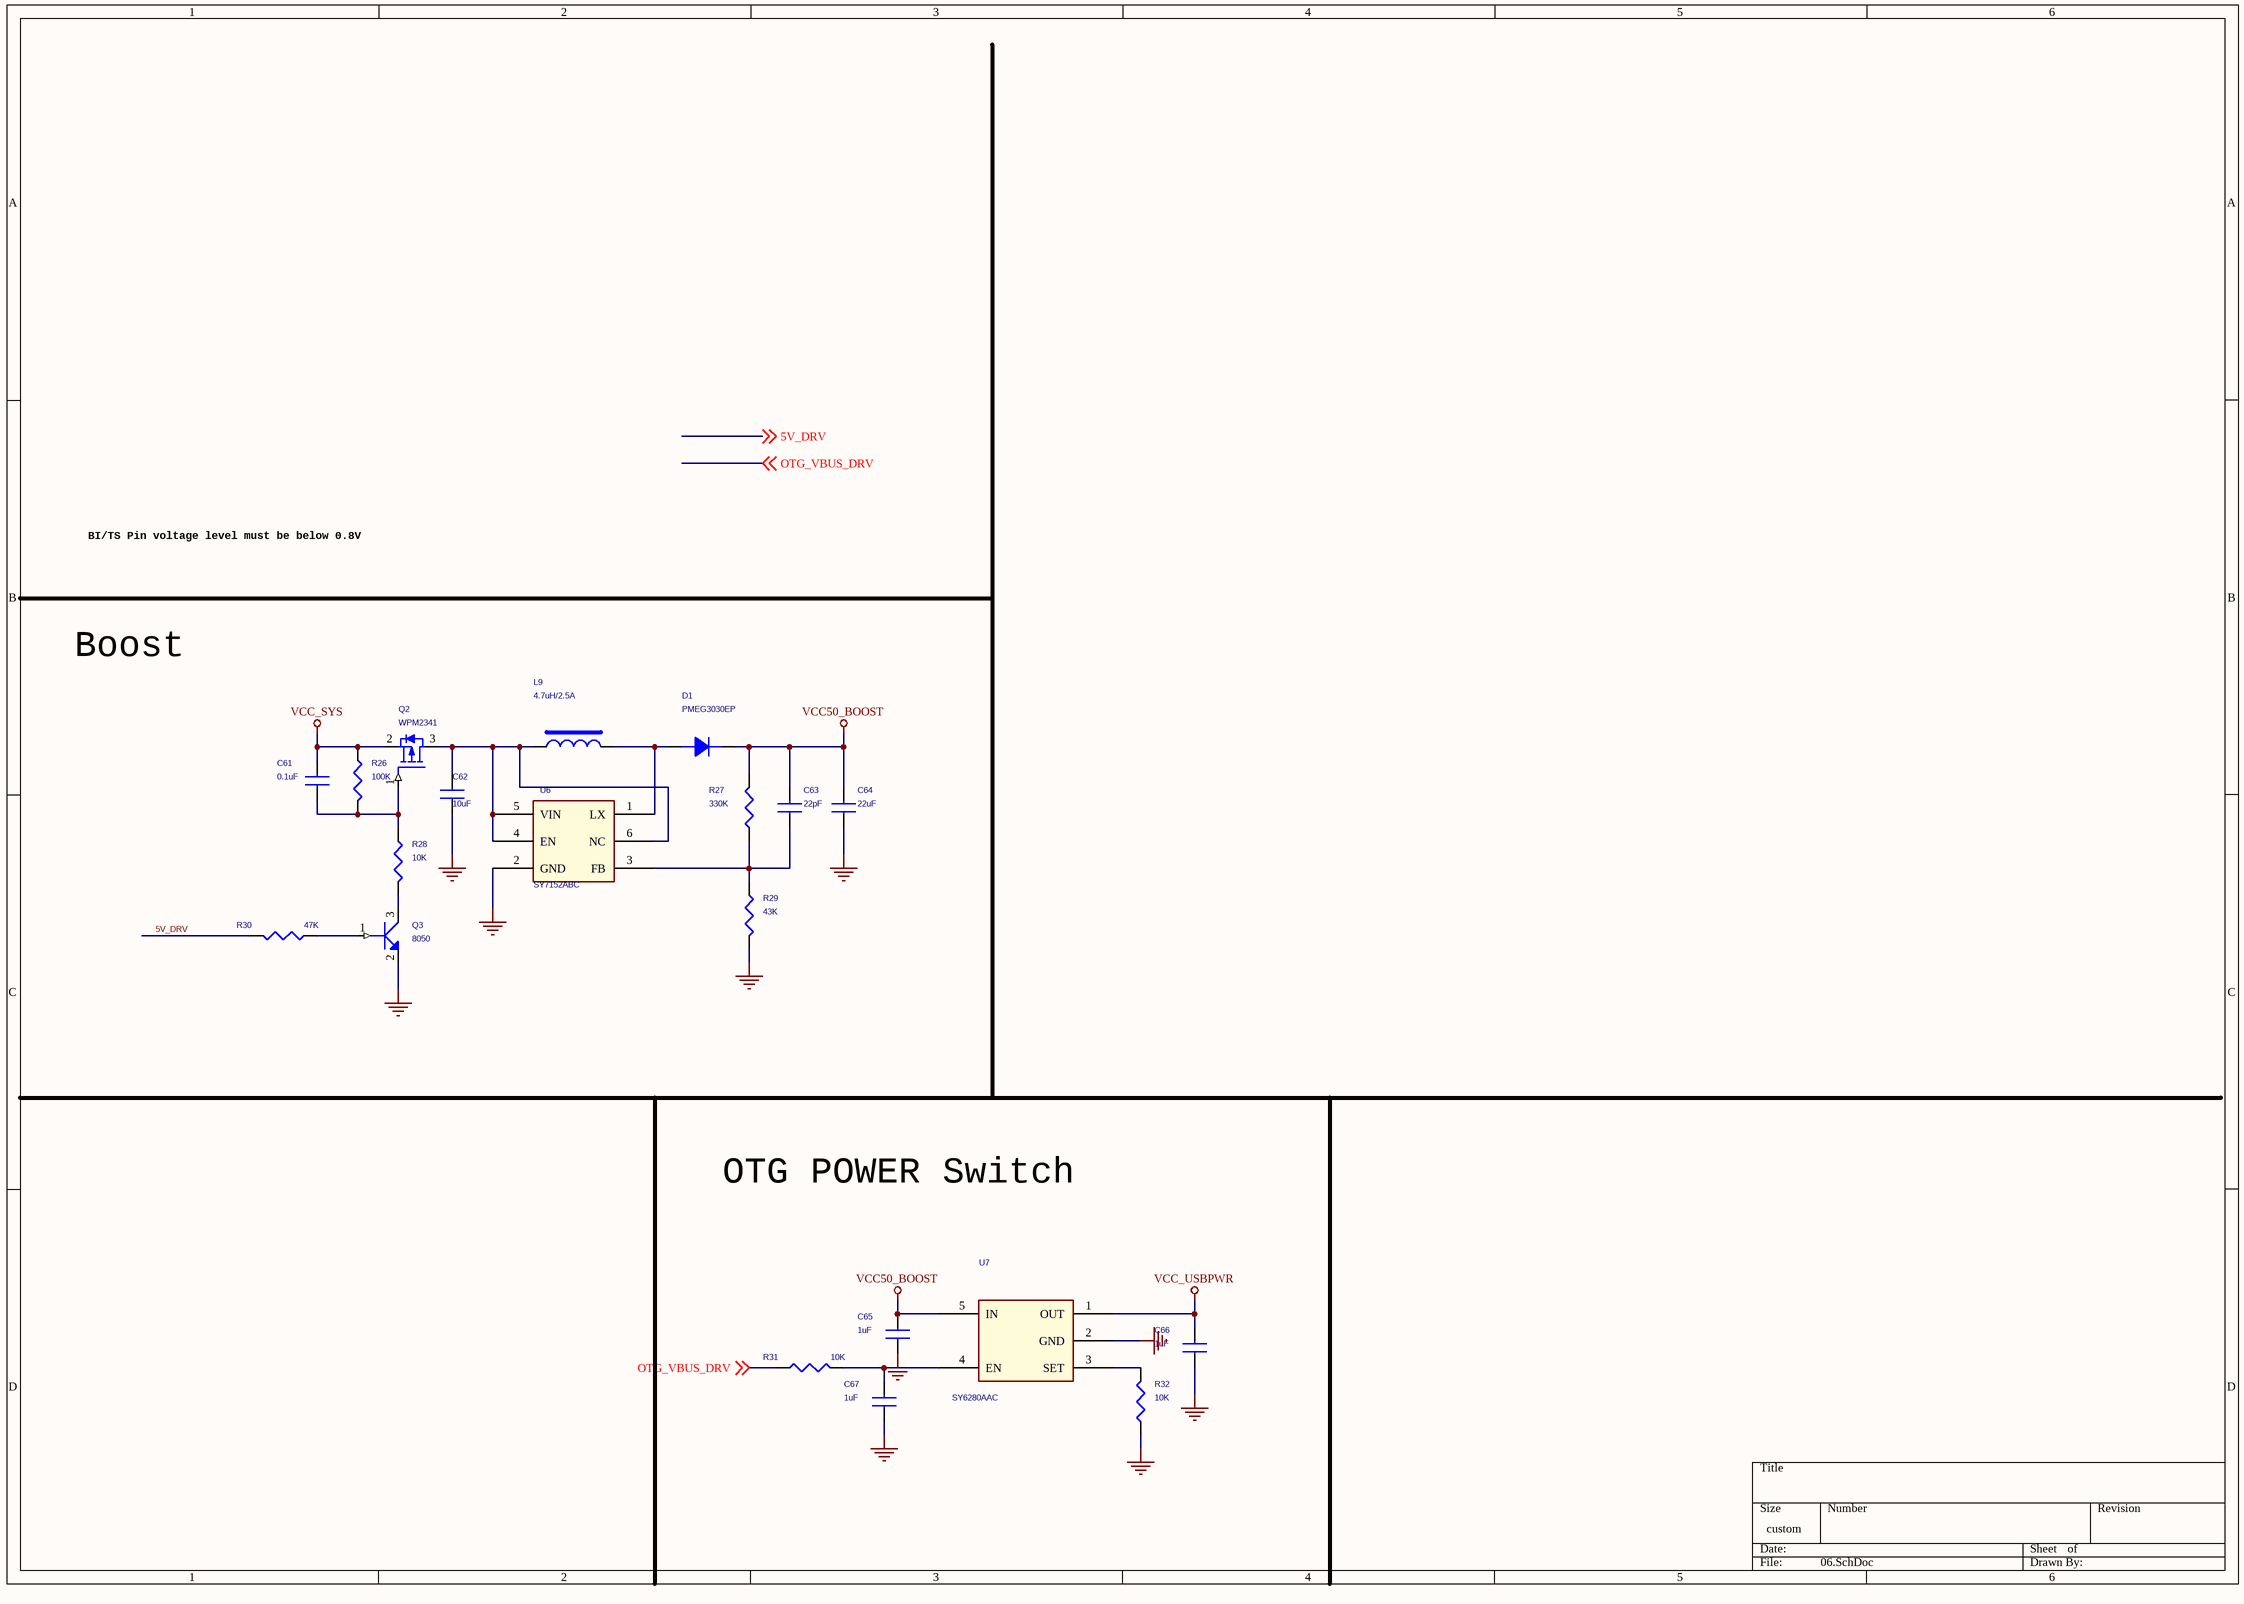
[diagram p6: 06.SchDoc]

### Parts
C61  0.1uF  [C0603]
C62  10uF  [C0603]
C63  22pF  [C0603]
C64  22uF  [C0603]
C65  1uF  [C0603]
C66  1uF  [C0603]
C67  1uF  [C0603]
D1  PMEG3030EP  [DO214AC]
L9  4.7uH/2.5A  [IND-3X3]
Q2  WPM2341  [SOT23]
Q3  8050  [SOT23]
R26  100K  [r0402]
R27  330K  [r0402]
R28  10K  [r0402]
R29  43K  [r0402]
R30  47K  [r0402]
R31  10K  [R0402]
R32  10K  [R0402]
U6  SY7152ABC  [SOT26]
U7  SY6280AAC  [SOT25]

### Nets
GND: C62.1 C64.1 C65.1 C66.1 C67.1 Q3.2(E) R29.2 R32.1 U6.2(GND) U7.2(GND)
VCC50_BOOST: C63.2 C64.2 C65.2 D1.2(K) R27.1 U7.5(IN)
VCC_SYS: C61.2 Q2.2(SOURCE) R26.2
VCC_USBPWR: C66.2 U7.1(OUT)
5V_DRV: R30.1 ; off-sheet 5V_DRV
OTG_VBUS_DRV: R31.2 ; off-sheet OTG_VBUS_DRV
NetC61_1: C61.1 Q2.1(GATE) R26.1 R28.2
NetC62_2: C62.2 L9.1 Q2.3(DRAIN) U6.4(EN) U6.5(VIN) U6.6(NC)
NetC63_1: C63.1 R27.2 R29.1 U6.3(FB)
NetC67_2: C67.2 R31.1 U7.4(EN)
NetD1_1: D1.1(A) L9.2 U6.1(LX)
NetQ3_1: Q3.1(B) R30.2
NetQ3_3: Q3.3(C) R28.1
NetR32_2: R32.2 U7.3(SET)

### Notes on the sheet
- BI/TS Pin voltage level must be below 0.8V
- Boost
- OTG POWER Switch

### Library data of the parts
C61 C65-C67 = CAP NP_Dup3: RoHS CHIP CAP 0.1uF +10/-10% X7R
C62 C64 = CAP NP_Dup3: RoHS CHIP CAP 10uF +10/-10% X5R; MARK: 106
C63 = CAP NP_Dup3: RoHS CHIP CAP 22pF 1% NPO
D1 = DIODE_Dup2: RoHS 1.0A SURFACE MOUNT SCHOTTKY BARRIER RECTIFIER 1N5819
L9 = INDUCTOR_1: CoilInd,Shielded(SHLD),4.7uH@100KHz,+/-30%,1.5A,45mOhm,SMD,4.0*4.0*2.0
Q2 = MOSFET P: MOSFET-P,WPM2341 ,-20V,+/-8V,-2.8A,56m Ohm@Vgs=-2.5V,44m Ohm@Vgs=-4.5V,SOT23; ROOM: CHG
Q3 = NPN4
R26 = RES 1B_Dup1: ROHS CHIP RES 100K 1/16W 1%
R27 = RESISTOR_0_Dup2: ROHS CHIP RES 330K 1/16W +/-5%; MARK: 51K
R28 R30 = RESISTOR_1_Dup2: RES,thick film,47KOhm,+/-5%,1/16W,SMD0402
R29 = RESISTOR_0_Dup2: ROHS CHIP RES 43K 1/16W +/-5%; MARK: 51K
R31 = RESISTOR_Dup1: ROHS CHIP RES 4.7K 1/16W +/-5%
R32 = RESISTOR_Dup1: ROHS CHIP RES 10K 1/16W +/-5%
U6 = G5121_1: SY7208/TCS9208/LP6218 High Efficiency 1MHz, 2A Step Up Regulator
U7 = LPW5206H: Power switch,LPW5206H,2.4V~5.5V,SOT23-5,-40°C~+ 85°C; MARK: RT9701/G5250

## Sheet 07.SchDoc
size 297 x 209 mm
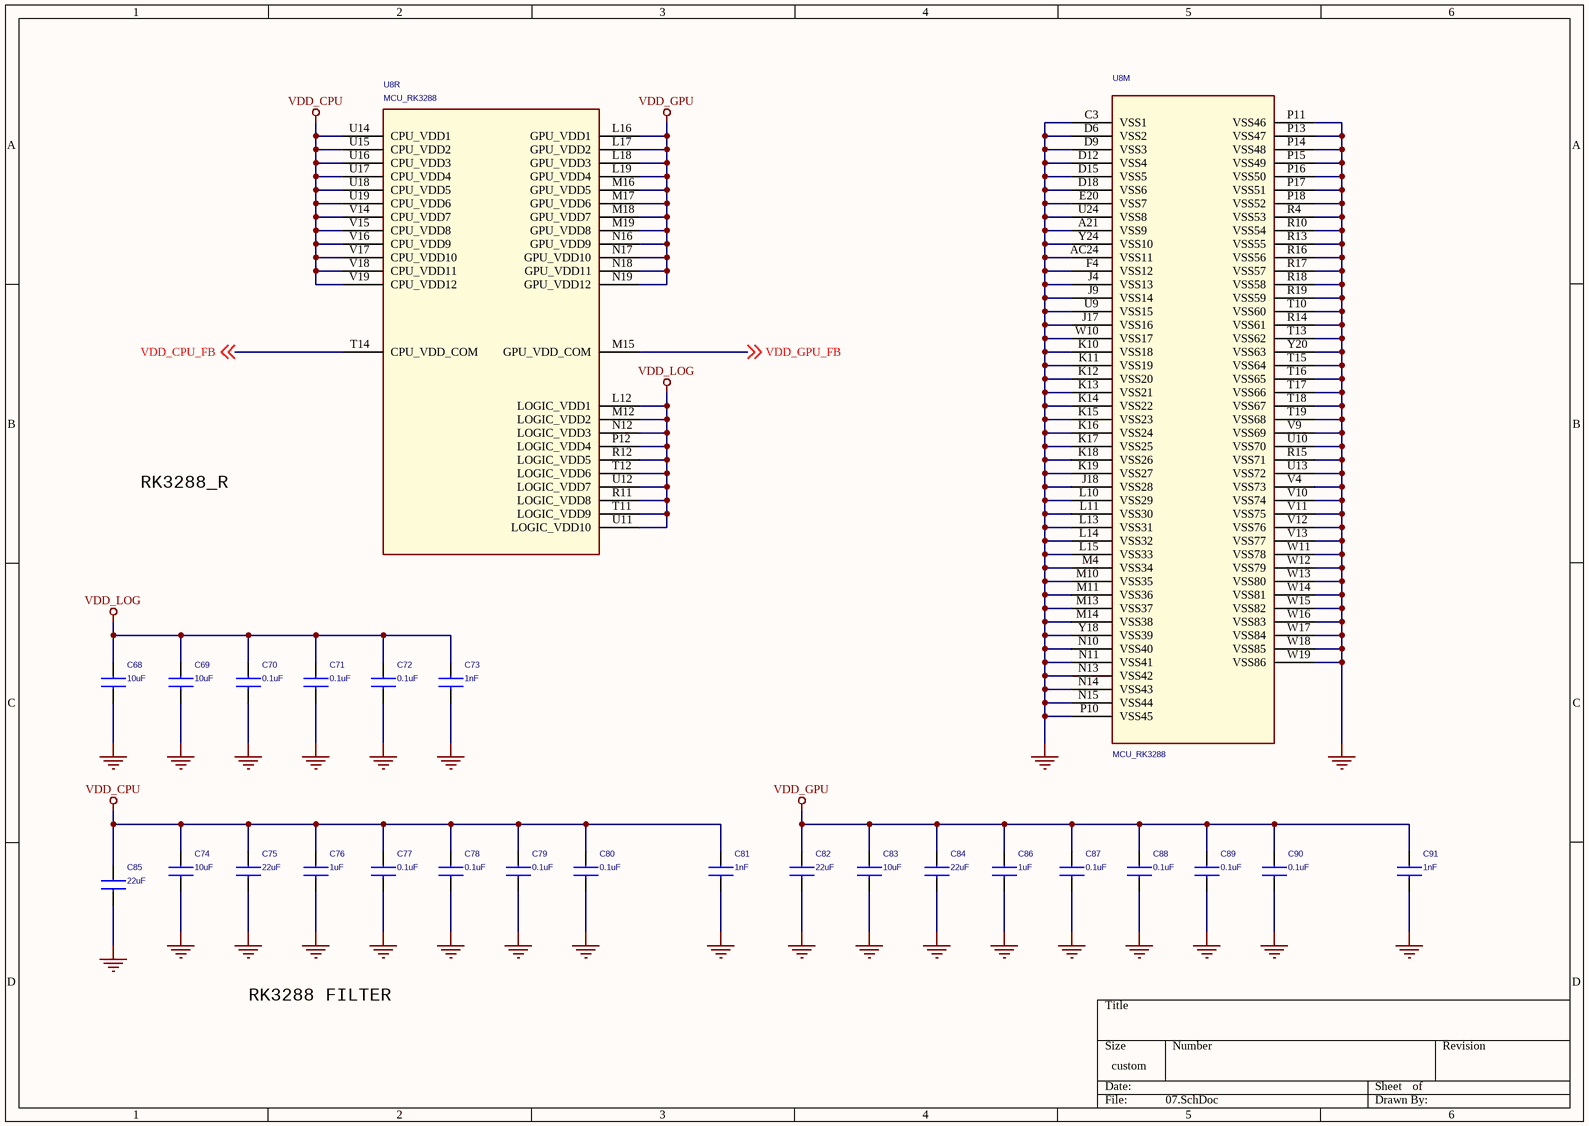
[diagram p7: 07.SchDoc]

### Parts
C68  10uF  [C0603]
C69  10uF  [C0603]
C70  0.1uF  [C0603]
C71  0.1uF  [C0603]
C72  0.1uF  [C0603]
C73  1nF  [C0603]
C74  10uF  [C0603]
C75  22uF  [C0603]
C76  1uF  [C0603]
C77  0.1uF  [C0603]
C78  0.1uF  [C0603]
C79  0.1uF  [C0603]
C80  0.1uF  [C0603]
C81  1nF  [C0603]
C82  22uF  [C0603]
C83  10uF  [C0603]
C84  22uF  [C0603]
C85  22uF  [C0603]
C86  1uF  [C0603]
C87  0.1uF  [C0603]
C88  0.1uF  [C0603]
C89  0.1uF  [C0603]
C90  0.1uF  [C0603]
C91  1nF  [C0603]
U8  MCU_RK3288  [BGA453-19X19]  (parts M,R of 24)

### Nets
GND: C68.1 C69.2 C70.2 C71.2 C72.2 C73.2 C74.1 C75.1 C76.2 C77.2 C78.2 C79.2 C80.2 C81.2 C82.1 C83.1 C84.1 C85.2 C86.2 C87.2 C88.2 C89.2 C90.2 C91.2 U8.A21(VSS9) U8.AC24(VSS11) U8.C3(VSS1) U8.D6(VSS2) U8.D9(VSS3) U8.D12(VSS4) U8.D15(VSS5) U8.D18(VSS6) U8.E20(VSS7) U8.F4(VSS12) U8.J4(VSS13) U8.J9(VSS14) U8.J17(VSS16) U8.J18(VSS28) U8.K10(VSS18) U8.K11(VSS19) U8.K12(VSS20) U8.K13(VSS21) U8.K14(VSS22) U8.K15(VSS23) U8.K16(VSS24) U8.K17(VSS25) U8.K18(VSS26) U8.K19(VSS27) U8.L10(VSS29) U8.L11(VSS30) U8.L13(VSS31) U8.L14(VSS32) U8.L15(VSS33) U8.M4(VSS34) U8.M10(VSS35) U8.M11(VSS36) U8.M13(VSS37) U8.M14(VSS38) U8.N10(VSS40) U8.N11(VSS41) U8.N13(VSS42) U8.N14(VSS43) U8.N15(VSS44) U8.P10(VSS45) U8.P11(VSS46) U8.P13(VSS47) U8.P14(VSS48) U8.P15(VSS49) U8.P16(VSS50) U8.P17(VSS51) U8.P18(VSS52) U8.R4(VSS53) U8.R10(VSS54) U8.R13(VSS55) U8.R14(VSS61) U8.R15(VSS71) U8.R16(VSS56) U8.R17(VSS57) U8.R18(VSS58) U8.R19(VSS59) U8.T10(VSS60) U8.T13(VSS62) U8.T15(VSS64) U8.T16(VSS65) U8.T17(VSS66) U8.T18(VSS67) U8.T19(VSS68) U8.U9(VSS15) U8.U10(VSS70) U8.U13(VSS72) U8.U24(VSS8) U8.V4(VSS73) U8.V9(VSS69) U8.V10(VSS74) U8.V11(VSS75) U8.V12(VSS76) U8.V13(VSS77) U8.W10(VSS17) U8.W11(VSS78) U8.W12(VSS79) U8.W13(VSS80) U8.W14(VSS81) U8.W15(VSS82) U8.W16(VSS83) U8.W17(VSS84) U8.W18(VSS85) U8.W19(VSS86) U8.Y18(VSS39) U8.Y20(VSS63) U8.Y24(VSS10)
VDD_CPU: C74.2 C75.2 C76.1 C77.1 C78.1 C79.1 C80.1 C81.1 C85.1 U8.U14(CPU_VDD1) U8.U15(CPU_VDD2) U8.U16(CPU_VDD3) U8.U17(CPU_VDD4) U8.U18(CPU_VDD5) U8.U19(CPU_VDD6) U8.V14(CPU_VDD7) U8.V15(CPU_VDD8) U8.V16(CPU_VDD9) U8.V17(CPU_VDD10) U8.V18(CPU_VDD11) U8.V19(CPU_VDD12)
VDD_GPU: C82.2 C83.2 C84.2 C86.1 C87.1 C88.1 C89.1 C90.1 C91.1 U8.L16(GPU_VDD1) U8.L17(GPU_VDD2) U8.L18(GPU_VDD3) U8.L19(GPU_VDD4) U8.M16(GPU_VDD5) U8.M17(GPU_VDD6) U8.M18(GPU_VDD7) U8.M19(GPU_VDD8) U8.N16(GPU_VDD9) U8.N17(GPU_VDD10) U8.N18(GPU_VDD11) U8.N19(GPU_VDD12)
VDD_LOG: C68.2 C69.1 C70.1 C71.1 C72.1 C73.1 U8.L12(LOGIC_VDD1) U8.M12(LOGIC_VDD2) U8.N12(LOGIC_VDD3) U8.P12(LOGIC_VDD4) U8.R11(LOGIC_VDD8) U8.R12(LOGIC_VDD5) U8.T11(LOGIC_VDD9) U8.T12(LOGIC_VDD6) U8.U11(LOGIC_VDD10) U8.U12(LOGIC_VDD7)
VDD_CPU_FB: U8.T14(CPU_VDD_COM) ; off-sheet VDD_CPU_FB
VDD_GPU_FB: U8.M15(GPU_VDD_COM) ; off-sheet VDD_GPU_FB

### Notes on the sheet
- RK3288_R
- RK3288 FILTER

### Library data of the parts
C68 C83 = CAP NP_Dup3: CAP,MLCC,10uF,+/-10%,X5R,6.3V,SMD0805
C69-C82 C84 C86-C91 = CAP NP_Dup3
C85 = CAP NP_Dup3: CAP,MLCC,47uF,+/-10%,X5R,4V,SMD1210
U8 = MCU_RK3288_3

## Sheet 08.SchDoc
size 297 x 209 mm
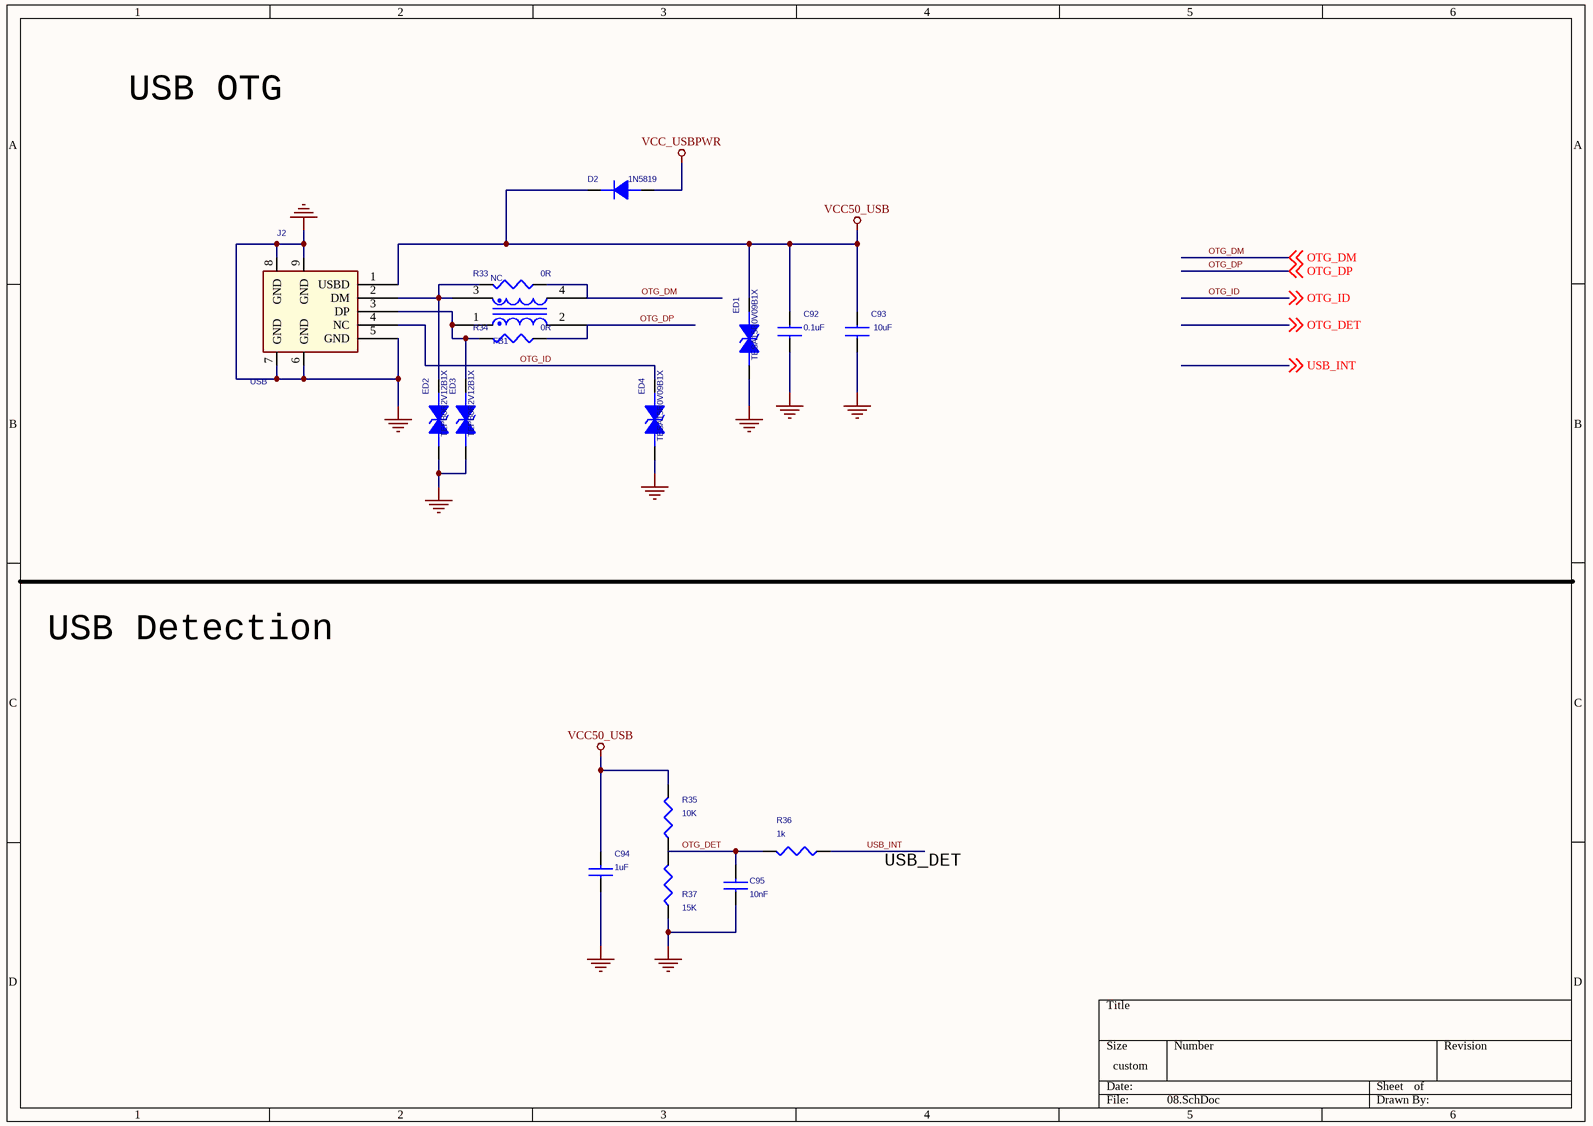
[diagram p8: 08.SchDoc]

### Parts
C92  0.1uF  [C0603]
C93  10uF  [C0603]
C94  1uF  [C0402]
C95  10nF  [C0402]
D2  1N5819  [SOD123]
ED1  TESA15R0V09B1X  [E0402N]
ED2  TEPB0R2V12B1X  [E0402N]
ED3  TEPB0R2V12B1X  [E0402N]
ED4  TESA15R0V09B1X  [E0402N]
FB1  NC  [LL-4]
J2  USB  [MICRO_USB_DIP]
R33  0R  [r0402]
R34  0R  [r0402]
R35  10K  [R0402]
R36  1k  [R0402]
R37  15K  [R0402]

### Nets
GND: C92.1 C93.2 C94.1 C95.1 ED1.2 ED2.2 ED3.2 ED4.2 J2.5(GND) J2.6(GND) J2.7(GND) J2.8(GND) J2.9(GND) R37.1
VCC50_USB: C92.2 C93.1 C94.2 D2.2(K) ED1.1 J2.1(USBD) R35.2
VCC_USBPWR: D2.1(A)
OTG_DET: C95.2 R35.1 R36.2 R37.2 ; off-sheet OTG_DET
OTG_DM: FB1.4 R33.1 ; off-sheet OTG_DM
OTG_DP: FB1.2 R34.1 ; off-sheet OTG_DP
OTG_ID: ED4.1 J2.4(NC) ; off-sheet OTG_ID
USB_INT: R36.1 ; off-sheet USB_INT
NetED2_1: ED2.1 FB1.3 J2.2(DM) R33.2
NetED3_1: ED3.1 FB1.1 J2.3(DP) R34.2

### Notes on the sheet
- USB OTG
- USB Detection
- USB_DET

### Library data of the parts
C92 = CAP NP_Dup3: 贴片电容; ROOM: USB+5V; MARK: 106
C93 = CAP NP_Dup3
C94 = CAP NP_Dup2: RoHS CHIP CAP 1uF +10/-10% X5R; MARK: 105
C95 = CAP NP_Dup2: RoHS CHIP CAP 10nF +10/-10% X7R
D2 = DIODE: Diode,Schottky,1N5819HW,40V,500mA,450mV; Supplier: DIODES; Supplier P/N: 1N5819HW
ED1-ED4 = TVS: ESD Component,5V,30P,SMD,0402
FB1 = L_CHOKE CM14: Chip common mode choke coil,90 ohm@100MHz,0.35 ohm/DCR,50V,330mA,-40°C~+ 85°C
J2 = MINI USB_0
R33 R34 = RESISTOR_0_Dup3: RES,thick film,10KOhm,+/-5%,1/16W,SMD0402
R35 R36 = RESISTOR_Dup1: ROHS CHIP RES 10K 1/16W 5%
R37 = RESISTOR_Dup1: ROHS CHIP RES 15K 1/16W 5%

## Sheet 09.SchDoc
size 297 x 209 mm
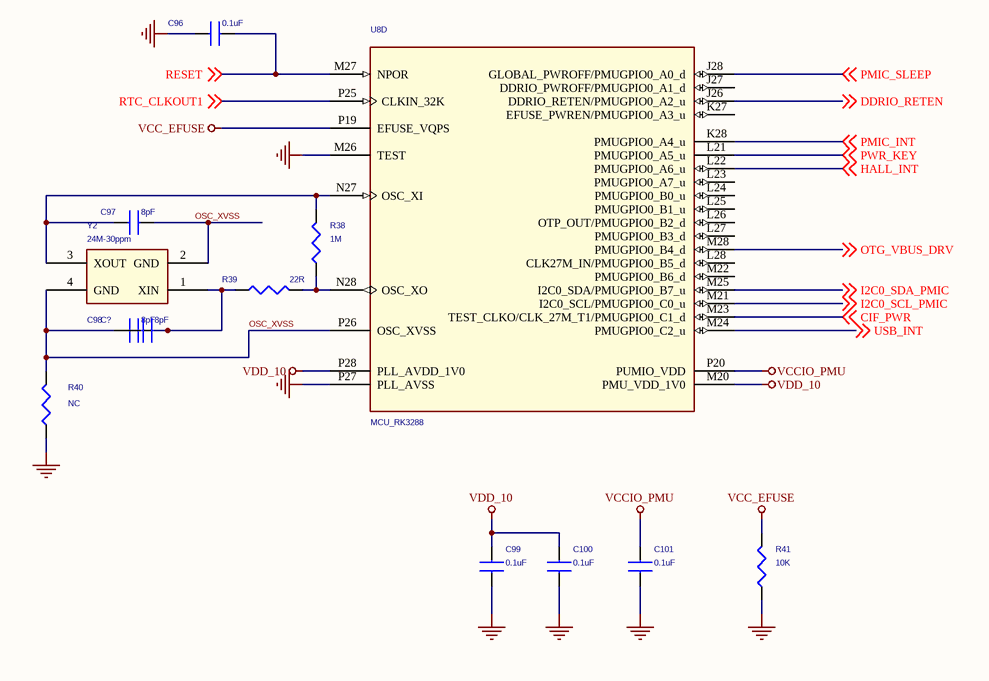
[diagram p9: 09.SchDoc]

### Parts
C96  0.1uF  [C0603]
C97  8pF  [C0603]
C98  8pF  [C0603]
C99  0.1uF  [C0603]
C100  0.1uF  [C0603]
C101  0.1uF  [C0603]
C?  8pF  [C0603]
R38  1M  [r0402]
R39  22R  [r0402]
R40  NC  [r0402]
R41  10K  [r0402]
U8  MCU_RK3288  [BGA453-19X19]  (part D of 24)
Y2  24M-30ppm  [CRY-3225]

### Nets
GND: C96.1 C99.1 C100.1 C101.1 R40.1 R41.1 U8.M26(TEST) U8.P27(PLL_AVSS)
VCC_EFUSE: R41.2 U8.P19(EFUSE_VQPS)
VCCIO_PMU: C101.2 U8.P20(PUMIO_VDD)
VDD_10: C99.2 C100.2 U8.M20(PMU_VDD_1V0) U8.P28(PLL_AVDD_1V0)
CIF_PWR: U8.M23(TEST_CLKO/CLK_27M_T1/PMUGPIO0_C1_d) ; off-sheet CIF_PWR
DDRIO_RETEN: U8.J26(DDRIO_RETEN/PMUGPIO0_A2_u) ; off-sheet DDRIO_RETEN
HALL_INT: U8.L22(PMUGPIO0_A6_u) ; off-sheet HALL_INT
I2C0_SCL_PMIC: U8.M21(I2C0_SCL/PMUGPIO0_C0_u) ; off-sheet I2C0_SCL_PMIC
I2C0_SDA_PMIC: U8.M25(I2C0_SDA/PMUGPIO0_B7_u) ; off-sheet I2C0_SDA_PMIC
OSC_XVSS: C97.2 C98.2 R40.2 U8.P26(OSC_XVSS) Y2.2(GND) Y2.4(GND)
OTG_VBUS_DRV: U8.M28(PMUGPIO0_B4_d) ; off-sheet OTG_VBUS_DRV
PMIC_INT: U8.K28(PMUGPIO0_A4_u) ; off-sheet PMIC_INT
PMIC_SLEEP: U8.J28(GLOBAL_PWROFF/PMUGPIO0_A0_d) ; off-sheet PMIC_SLEEP
PWR_KEY: U8.L21(PMUGPIO0_A5_u) ; off-sheet PWR_KEY
RESET: C96.2 U8.M27(NPOR) ; off-sheet RESET
RTC_CLKOUT1: U8.P25(CLKIN_32K) ; off-sheet RTC_CLKOUT1
USB_INT: U8.M24(PMUGPIO0_C2_u) ; off-sheet USB_INT
NetC97_1: C97.1 R38.2 U8.N27(OSC_XI) Y2.3(XOUT)
NetC98_1: C98.1 C?.1 R39.1 Y2.1(XIN)
NetR38_1: R38.1 R39.2 U8.N28(OSC_XO)

Not connected (* = marked no-connect by the designer): C? 2; U8 J27(DDRIO_PWROFF/PMUGPIO0_A1_d) K27(EFUSE_PWREN/PMUGPIO0_A3_u) L23(PMUGPIO0_A7_u) L24(PMUGPIO0_B0_u) L25(PMUGPIO0_B1_u) L26(OTP_OUT/PMUGPIO0_B2_d) L27(PMUGPIO0_B3_d) L28(CLK27M_IN/PMUGPIO0_B5_d) M22(PMUGPIO0_B6_d)

### Library data of the parts
C96 C101 = CAP NP_Dup3: 贴片电容; ROOM: USB+5V; MARK: 106
C97 C98 C? = CAP NP_Dup3
C99 C100 = CAP NP_Dup3: 贴片电容; MARK: 106; ROOM: USB+5V
R38-R40 = RESISTOR_1_Dup2
R41 = RESISTOR_0_Dup3: RES,thick film,100KOhm,+/-5%,1/16W,SMD0402; MARK: 51K
U8 = MCU_RK3288_3
Y2 = CRYSTAL-4_1

## Sheet 10.SchDoc
size 297 x 209 mm
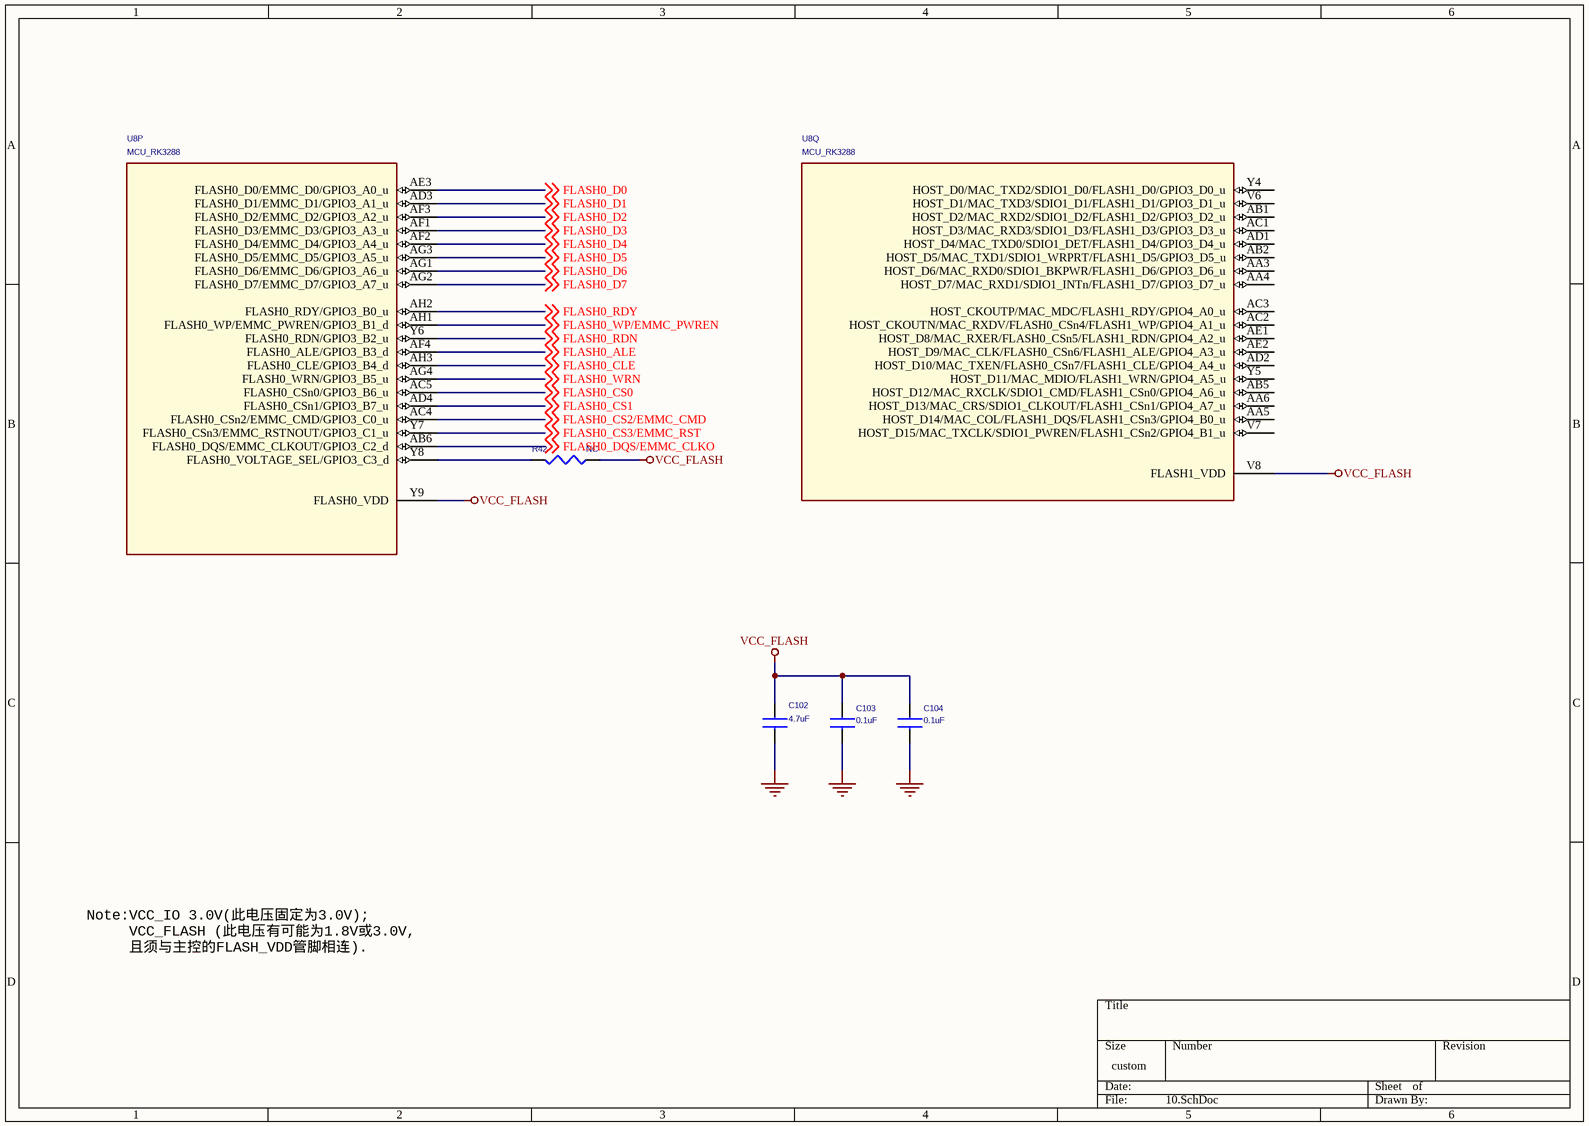
[diagram p10: 10.SchDoc]

### Parts
C102  4.7uF  [C0603]
C103  0.1uF  [C0603]
C104  0.1uF  [C0603]
R42  NC  [r0402]
U8  MCU_RK3288  [BGA453-19X19]  (parts P,Q of 24)

### Nets
GND: C102.2 C103.2 C104.2
VCC_FLASH: C102.1 C103.1 C104.1 R42.1 U8.V8(FLASH1_VDD) U8.Y9(FLASH0_VDD)
FLASH0_ALE: U8.AF4(FLASH0_ALE/GPIO3_B3_d) ; off-sheet FLASH0_ALE
FLASH0_CLE: U8.AH3(FLASH0_CLE/GPIO3_B4_d) ; off-sheet FLASH0_CLE
FLASH0_CS0: U8.AC5(FLASH0_CSn0/GPIO3_B6_u) ; off-sheet FLASH0_CS0
FLASH0_CS1: U8.AD4(FLASH0_CSn1/GPIO3_B7_u) ; off-sheet FLASH0_CS1
FLASH0_CS2/EMMC_CMD: U8.AC4(FLASH0_CSn2/EMMC_CMD/GPIO3_C0_u) ; off-sheet FLASH0_CS2/EMMC_CMD
FLASH0_CS3/EMMC_RST: U8.Y7(FLASH0_CSn3/EMMC_RSTNOUT/GPIO3_C1_u) ; off-sheet FLASH0_CS3/EMMC_RST
FLASH0_D0: U8.AE3(FLASH0_D0/EMMC_D0/GPIO3_A0_u) ; off-sheet FLASH0_D0
FLASH0_D1: U8.AD3(FLASH0_D1/EMMC_D1/GPIO3_A1_u) ; off-sheet FLASH0_D1
FLASH0_D2: U8.AF3(FLASH0_D2/EMMC_D2/GPIO3_A2_u) ; off-sheet FLASH0_D2
FLASH0_D3: U8.AF1(FLASH0_D3/EMMC_D3/GPIO3_A3_u) ; off-sheet FLASH0_D3
FLASH0_D4: U8.AF2(FLASH0_D4/EMMC_D4/GPIO3_A4_u) ; off-sheet FLASH0_D4
FLASH0_D5: U8.AG3(FLASH0_D5/EMMC_D5/GPIO3_A5_u) ; off-sheet FLASH0_D5
FLASH0_D6: U8.AG1(FLASH0_D6/EMMC_D6/GPIO3_A6_u) ; off-sheet FLASH0_D6
FLASH0_D7: U8.AG2(FLASH0_D7/EMMC_D7/GPIO3_A7_u) ; off-sheet FLASH0_D7
FLASH0_DQS/EMMC_CLKO: U8.AB6(FLASH0_DQS/EMMC_CLKOUT/GPIO3_C2_d) ; off-sheet FLASH0_DQS/EMMC_CLKO
FLASH0_RDN: U8.Y6(FLASH0_RDN/GPIO3_B2_u) ; off-sheet FLASH0_RDN
FLASH0_RDY: U8.AH2(FLASH0_RDY/GPIO3_B0_u) ; off-sheet FLASH0_RDY
FLASH0_WP/EMMC_PWREN: U8.AH1(FLASH0_WP/EMMC_PWREN/GPIO3_B1_d) ; off-sheet FLASH0_WP/EMMC_PWREN
FLASH0_WRN: U8.AG4(FLASH0_WRN/GPIO3_B5_u) ; off-sheet FLASH0_WRN
NetR42_2: R42.2 U8.Y8(FLASH0_VOLTAGE_SEL/GPIO3_C3_d)

Not connected (* = marked no-connect by the designer): U8 AA3(HOST_D6/MAC_RXD0/SDIO1_BKPWR/FLASH1_D6/GPIO3_D6_u) AA4(HOST_D7/MAC_RXD1/SDIO1_INTn/FLASH1_D7/GPIO3_D7_u) AA5(HOST_D14/MAC_COL/FLASH1_DQS/FLASH1_CSn3/GPIO4_B0_u) AA6(HOST_D13/MAC_CRS/SDIO1_CLKOUT/FLASH1_CSn1/GPIO4_A7_u) AB1(HOST_D2/MAC_RXD2/SDIO1_D2/FLASH1_D2/GPIO3_D2_u) AB2(HOST_D5/MAC_TXD1/SDIO1_WRPRT/FLASH1_D5/GPIO3_D5_u) AB5(HOST_D12/MAC_RXCLK/SDIO1_CMD/FLASH1_CSn0/GPIO4_A6_u) AC1(HOST_D3/MAC_RXD3/SDIO1_D3/FLASH1_D3/GPIO3_D3_u) AC2(HOST_CKOUTN/MAC_RXDV/FLASH0_CSn4/FLASH1_WP/GPIO4_A1_u) AC3(HOST_CKOUTP/MAC_MDC/FLASH1_RDY/GPIO4_A0_u) AD1(HOST_D4/MAC_TXD0/SDIO1_DET/FLASH1_D4/GPIO3_D4_u) AD2(HOST_D10/MAC_TXEN/FLASH0_CSn7/FLASH1_CLE/GPIO4_A4_u) AE1(HOST_D8/MAC_RXER/FLASH0_CSn5/FLASH1_RDN/GPIO4_A2_u) AE2(HOST_D9/MAC_CLK/FLASH0_CSn6/FLASH1_ALE/GPIO4_A3_u) V6(HOST_D1/MAC_TXD3/SDIO1_D1/FLASH1_D1/GPIO3_D1_u) V7(HOST_D15/MAC_TXCLK/SDIO1_PWREN/FLASH1_CSn2/GPIO4_B1_u) Y4(HOST_D0/MAC_TXD2/SDIO1_D0/FLASH1_D0/GPIO3_D0_u) Y5(HOST_D11/MAC_MDIO/FLASH1_WRN/GPIO4_A5_u)

### Notes on the sheet
- Note:VCC_IO 3.0V(此电压固定为3.0V);
  VCC_FLASH (此电压有可能为1.8V或3.0V,
  且须与主控的FLASH_VDD管脚相连).

### Library data of the parts
C102 = CAP NP_Dup3: 贴片电容
C103 C104 = CAP NP_Dup3: RoHS CHIP CAP 0.1uF +10/-10% X7R
R42 = RESISTOR_1_Dup2
U8 = MCU_RK3288_3

## Sheet 11.SchDoc
size 635 x 406 mm
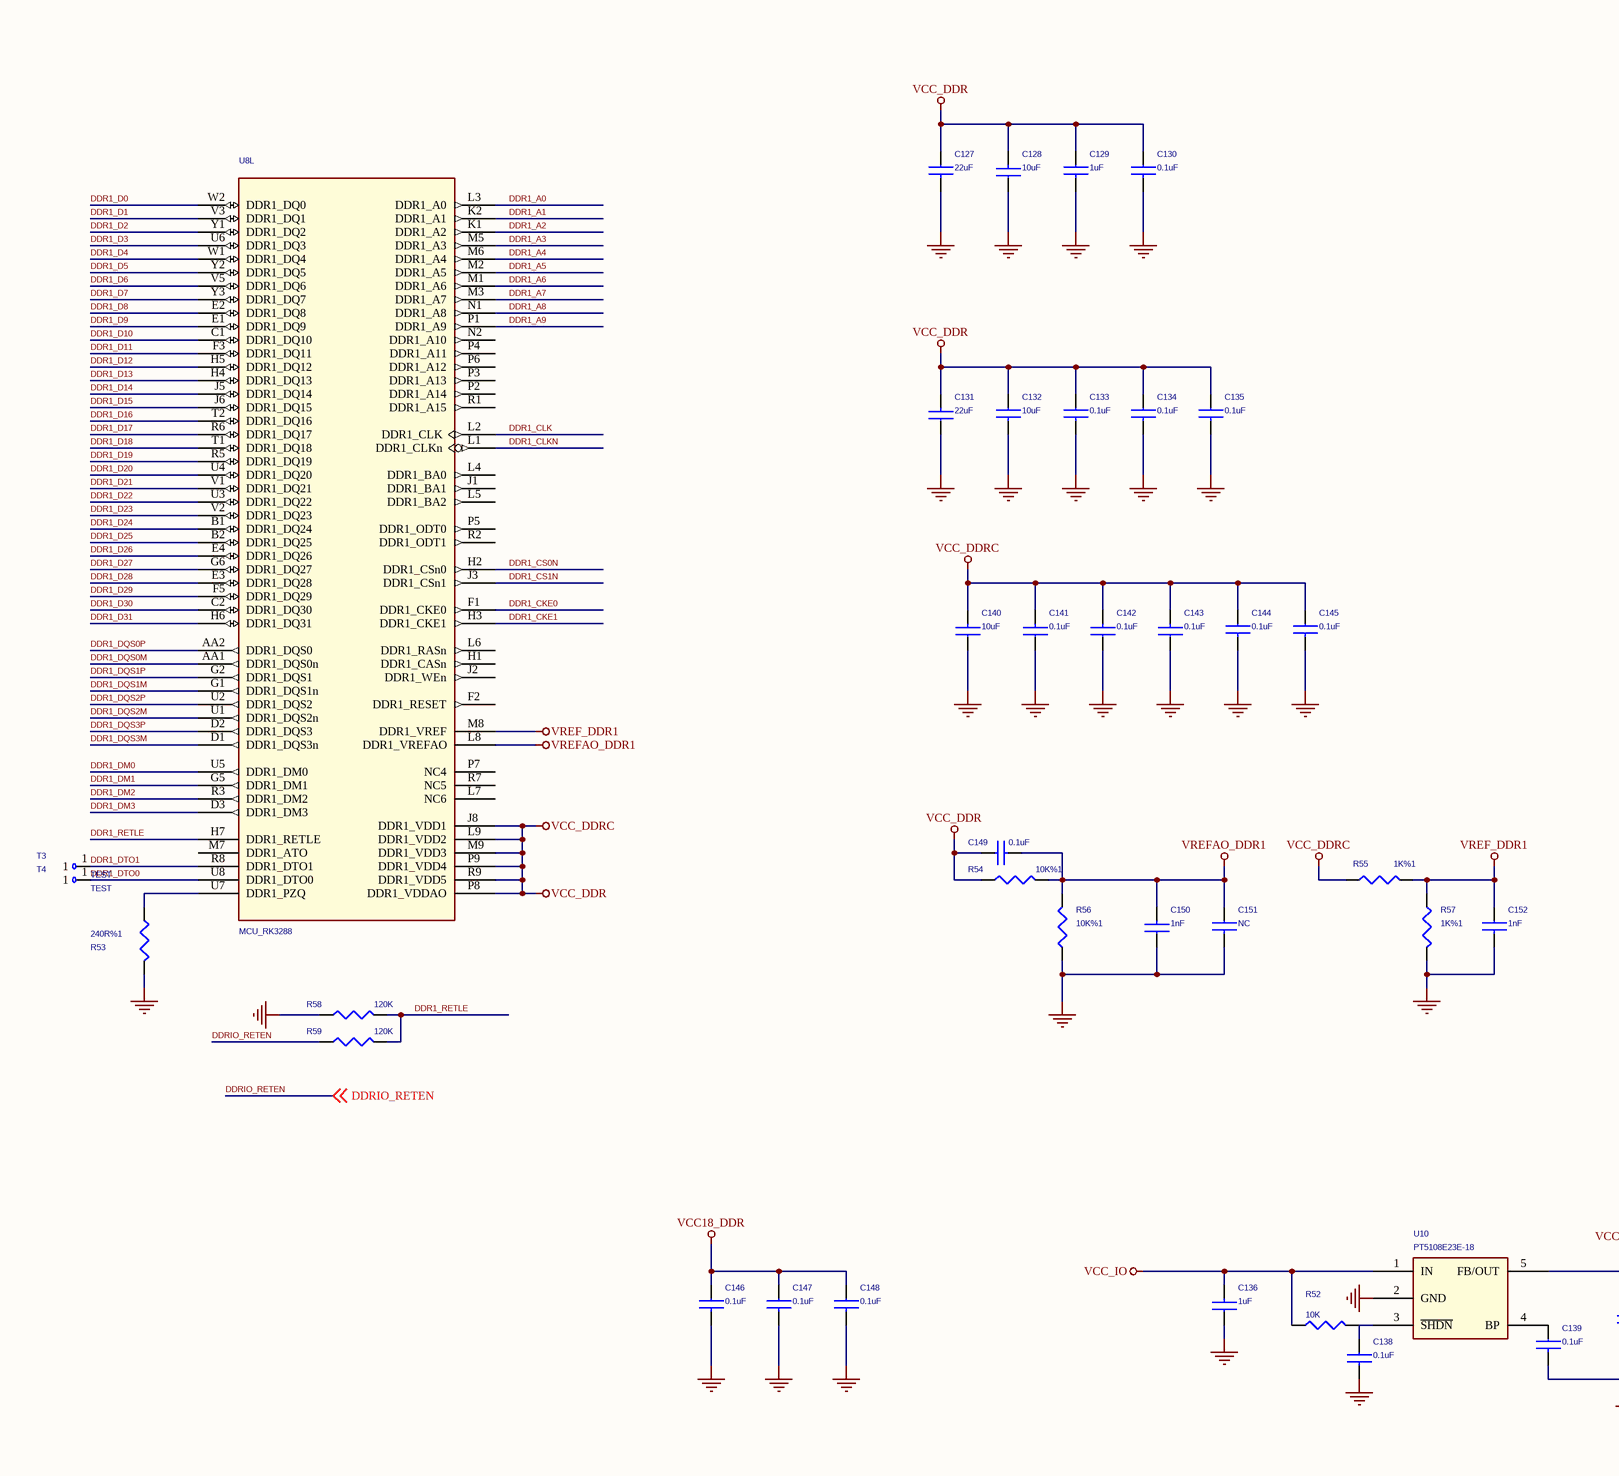
[diagram p11: 11.SchDoc, left]
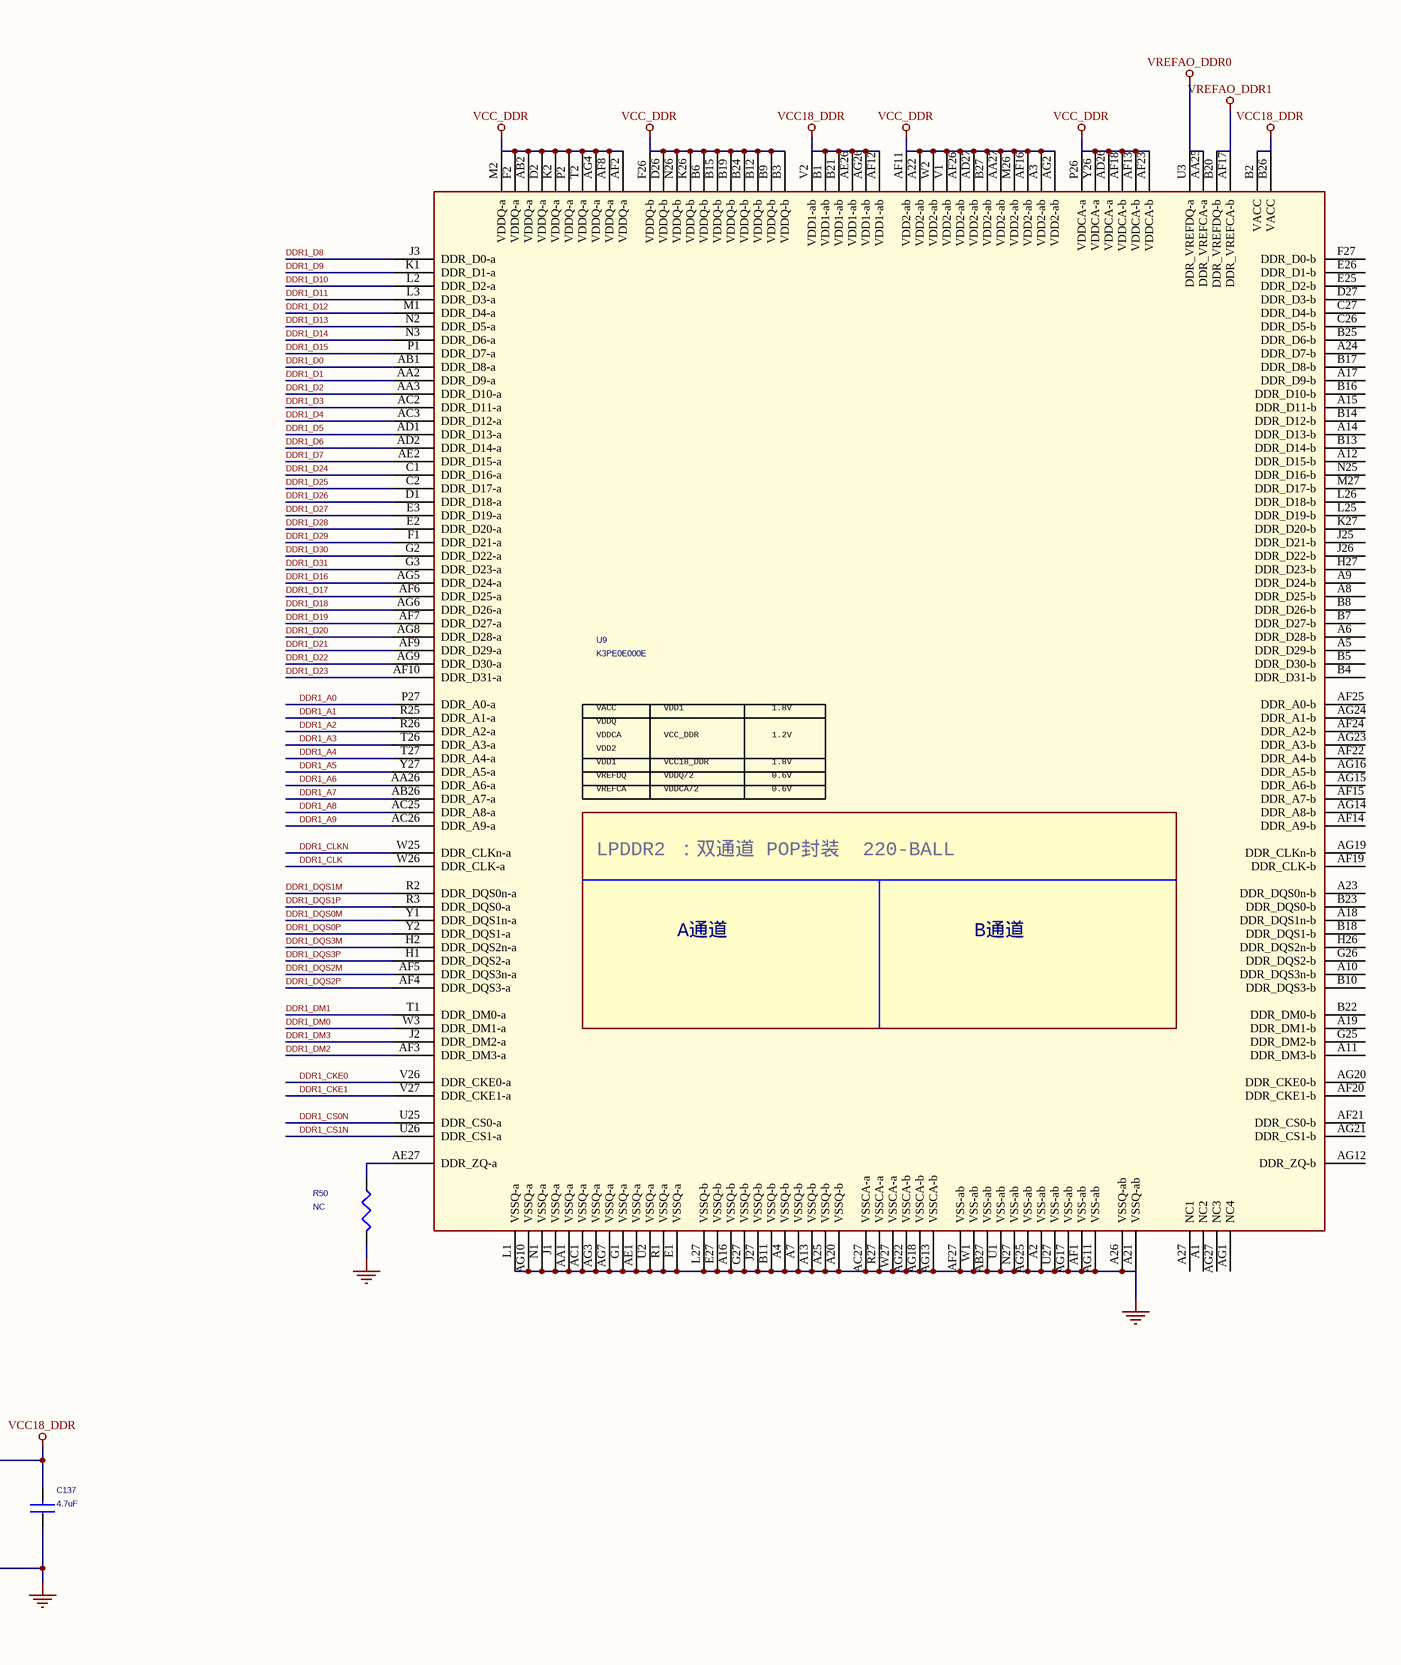
[diagram p12: 11.SchDoc, right]

### Parts
C127  22uF  [C0805]
C128  10uF  [C0603]
C129  1uF  [c0402]
C130  0.1uF  [c0402]
C131  22uF  [C0805]
C132  10uF  [C0603]
C133  0.1uF  [c0402]
C134  0.1uF  [c0402]
C135  0.1uF  [C0201]
C136  1uF  [c0402]
C137  4.7uF  [C0603]
C138  0.1uF  [c0402]
C139  0.1uF  [c0402]
C140  10uF  [C0603]
C141  0.1uF  [c0402]
C142  0.1uF  [c0402]
C143  0.1uF  [c0402]
C144  0.1uF  [c0402]
C145  0.1uF  [c0402]
C146  0.1uF  [c0402]
C147  0.1uF  [c0402]
C148  0.1uF  [C0201]
C149  0.1uF  [c0402]
C150  1nF  [C0201]
C151  NC  [c0402]
C152  1nF  [c0402]
R50  NC  [r0402]
R52  10K  [r0402]
R53  240R%1  [r0402]
R54  10K%1  [r0402]
R55  1K%1  [r0402]
R56  10K%1  [r0402]
R57  1K%1  [r0402]
R58  120K  [r0402]
R59  120K  [r0402]
T3  TEST  [TEST]
T4  TEST  [TEST]
U8  MCU_RK3288  [BGA453-19X19]  (part L of 24)
U9  K3PE0E000E  [FBGA220-14X14]
U10  PT5108E23E-18  [SOT25]

### Nets
GND: C127.2 C128.1 C129.2 C130.2 C131.1 C132.2 C133.2 C134.2 C135.2 C136.1 C137.1 C138.2 C139.2 C140.1 C141.1 C142.1 C143.1 C144.2 C145.2 C146.2 C147.2 C148.2 C150.1 C151.2 C152.2 R50.2 R53.2 R56.1 R57.2 R58.2 U9.A2(VSS-ab) U9.A4(VSSQ-b) U9.A7(VSSQ-b) U9.A13(VSSQ-b) U9.A16(VSSQ-b) U9.A20(VSSQ-b) U9.A21(VSSQ-ab) U9.A25(VSSQ-b) U9.A26(VSSQ-ab) U9.AA1(VSSQ-a) U9.AB27(VSS-ab) U9.AC1(VSSQ-a) U9.AC27(VSSCA-a) U9.AE1(VSSQ-a) U9.AF1(VSS-ab) U9.AF27(VSS-ab) U9.AG3(VSSQ-a) U9.AG7(VSSQ-a) U9.AG10(VSSQ-a) U9.AG11(VSS-ab) U9.AG13(VSSCA-b) U9.AG17(VSS-ab) U9.AG18(VSSCA-b) U9.AG22(VSSCA-b) U9.AG25(VSS-ab) U9.B11(VSSQ-b) U9.E1(VSSQ-a) U9.E27(VSSQ-b) U9.G1(VSSQ-a) U9.G27(VSSQ-b) U9.J1(VSSQ-a) U9.J27(VSSQ-b) U9.L1(VSSQ-a) U9.L27(VSSQ-b) U9.N1(VSSQ-a) U9.N27(VSS-ab) U9.R1(VSSQ-a) U9.R27(VSSCA-a) U9.U1(VSS-ab) U9.U2(VSSQ-a) U9.U27(VSS-ab) U9.W1(VSS-ab) U9.W27(VSSCA-a) U10.2(GND)
VCC18_DDR: C137.2 C146.1 C147.1 C148.1 U9.AE26(VDD1-ab) U9.AF12(VDD1-ab) U9.AG26(VDD1-ab) U9.B1(VDD1-ab) U9.B2(VACC) U9.B21(VDD1-ab) U9.B26(VACC) U9.V2(VDD1-ab) U10.5(FB/OUT)
VCC_DDR: C127.1 C128.2 C129.1 C130.1 C131.2 C132.1 C133.1 C134.1 C135.1 C140.2 C141.2 C142.2 C143.2 C144.1 C145.1 C149.1 R54.1 R55.1 U8.J8(DDR1_VDD1) U8.L9(DDR1_VDD2) U8.M9(DDR1_VDD3) U8.P8(DDR1_VDDAO) U8.P9(DDR1_VDD4) U8.R9(DDR1_VDD5) U9.A3(VDD2-ab) U9.A22(VDD2-ab) U9.AA27(VDD2-ab) U9.AB2(VDDQ-a) U9.AD26(VDDCA-a) U9.AD27(VDD2-ab) U9.AF2(VDDQ-a) U9.AF8(VDDQ-a) U9.AF11(VDD2-ab) U9.AF13(VDDCA-b) U9.AF16(VDD2-ab) U9.AF18(VDDCA-b) U9.AF23(VDDCA-b) U9.AF26(VDD2-ab) U9.AG2(VDD2-ab) U9.AG4(VDDQ-a) U9.B3(VDDQ-b) U9.B6(VDDQ-b) U9.B9(VDDQ-b) U9.B12(VDDQ-b) U9.B15(VDDQ-b) U9.B19(VDDQ-b) U9.B24(VDDQ-b) U9.B27(VDD2-ab) U9.D2(VDDQ-a) U9.D26(VDDQ-b) U9.F2(VDDQ-a) U9.F26(VDDQ-b) U9.K2(VDDQ-a) U9.K26(VDDQ-b) U9.M2(VDDQ-a) U9.M26(VDD2-ab) U9.N26(VDDQ-b) U9.P2(VDDQ-a) U9.P26(VDDCA-a) U9.T2(VDDQ-a) U9.V1(VDD2-ab) U9.W2(VDD2-ab) U9.Y26(VDDCA-a)  [also labelled VCC_DDRC]
VCC_IO: C136.2 R52.1 U10.1(IN)
VREF_DDR1: C152.1 R55.2 R57.1 U8.M8(DDR1_VREF)
VREFAO_DDR0: U9.AA25(DDR_VREFCA-a) U9.U3(DDR_VREFDQ-a)
VREFAO_DDR1: C149.2 C150.2 C151.1 R54.2 R56.2 U8.L8(DDR1_VREFAO) U9.AF17(DDR_VREFCA-b) U9.B20(DDR_VREFDQ-b)
DDR1_A0: U8.L3(DDR1_A0) U9.P27(DDR_A0-a)
DDR1_A1: U8.K2(DDR1_A1) U9.R25(DDR_A1-a)
DDR1_A2: U8.K1(DDR1_A2) U9.R26(DDR_A2-a)
DDR1_A3: U8.M5(DDR1_A3) U9.T26(DDR_A3-a)
DDR1_A4: U8.M6(DDR1_A4) U9.T27(DDR_A4-a)
DDR1_A5: U8.M2(DDR1_A5) U9.Y27(DDR_A5-a)
DDR1_A6: U8.M1(DDR1_A6) U9.AA26(DDR_A6-a)
DDR1_A7: U8.M3(DDR1_A7) U9.AB26(DDR_A7-a)
DDR1_A8: U8.N1(DDR1_A8) U9.AC25(DDR_A8-a)
DDR1_A9: U8.P1(DDR1_A9) U9.AC26(DDR_A9-a)
DDR1_CKE0: U8.F1(DDR1_CKE0) U9.V26(DDR_CKE0-a)
DDR1_CKE1: U8.H3(DDR1_CKE1) U9.V27(DDR_CKE1-a)
DDR1_CLK: U8.L2(DDR1_CLK) U9.W26(DDR_CLK-a)
DDR1_CLKN: U8.L1(DDR1_CLKn) U9.W25(DDR_CLKn-a)
DDR1_CS0N: U8.H2(DDR1_CSn0) U9.U25(DDR_CS0-a)
DDR1_CS1N: U8.J3(DDR1_CSn1) U9.U26(DDR_CS1-a)
DDR1_D0: U8.W2(DDR1_DQ0) U9.AB1(DDR_D8-a)
DDR1_D1: U8.V3(DDR1_DQ1) U9.AA2(DDR_D9-a)
DDR1_D2: U8.Y1(DDR1_DQ2) U9.AA3(DDR_D10-a)
DDR1_D3: U8.U6(DDR1_DQ3) U9.AC2(DDR_D11-a)
DDR1_D4: U8.W1(DDR1_DQ4) U9.AC3(DDR_D12-a)
DDR1_D5: U8.Y2(DDR1_DQ5) U9.AD1(DDR_D13-a)
DDR1_D6: U8.V5(DDR1_DQ6) U9.AD2(DDR_D14-a)
DDR1_D7: U8.Y3(DDR1_DQ7) U9.AE2(DDR_D15-a)
DDR1_D8: U8.E2(DDR1_DQ8) U9.J3(DDR_D0-a)
DDR1_D9: U8.E1(DDR1_DQ9) U9.K1(DDR_D1-a)
DDR1_D10: U8.C1(DDR1_DQ10) U9.L2(DDR_D2-a)
DDR1_D11: U8.F3(DDR1_DQ11) U9.L3(DDR_D3-a)
DDR1_D12: U8.H5(DDR1_DQ12) U9.M1(DDR_D4-a)
DDR1_D13: U8.H4(DDR1_DQ13) U9.N2(DDR_D5-a)
DDR1_D14: U8.J5(DDR1_DQ14) U9.N3(DDR_D6-a)
DDR1_D15: U8.J6(DDR1_DQ15) U9.P1(DDR_D7-a)
DDR1_D16: U8.T2(DDR1_DQ16) U9.AG5(DDR_D24-a)
DDR1_D17: U8.R6(DDR1_DQ17) U9.AF6(DDR_D25-a)
DDR1_D18: U8.T1(DDR1_DQ18) U9.AG6(DDR_D26-a)
DDR1_D19: U8.R5(DDR1_DQ19) U9.AF7(DDR_D27-a)
DDR1_D20: U8.U4(DDR1_DQ20) U9.AG8(DDR_D28-a)
DDR1_D21: U8.V1(DDR1_DQ21) U9.AF9(DDR_D29-a)
DDR1_D22: U8.U3(DDR1_DQ22) U9.AG9(DDR_D30-a)
DDR1_D23: U8.V2(DDR1_DQ23) U9.AF10(DDR_D31-a)
DDR1_D24: U8.B1(DDR1_DQ24) U9.C1(DDR_D16-a)
DDR1_D25: U8.B2(DDR1_DQ25) U9.C2(DDR_D17-a)
DDR1_D26: U8.E4(DDR1_DQ26) U9.D1(DDR_D18-a)
DDR1_D27: U8.G6(DDR1_DQ27) U9.E3(DDR_D19-a)
DDR1_D28: U8.E3(DDR1_DQ28) U9.E2(DDR_D20-a)
DDR1_D29: U8.F5(DDR1_DQ29) U9.F1(DDR_D21-a)
DDR1_D30: U8.C2(DDR1_DQ30) U9.G2(DDR_D22-a)
DDR1_D31: U8.H6(DDR1_DQ31) U9.G3(DDR_D23-a)
DDR1_DM0: U8.U5(DDR1_DM0) U9.W3(DDR_DM1-a)
DDR1_DM1: U8.G5(DDR1_DM1) U9.T1(DDR_DM0-a)
DDR1_DM2: U8.R3(DDR1_DM2) U9.AF3(DDR_DM3-a)
DDR1_DM3: U8.D3(DDR1_DM3) U9.J2(DDR_DM2-a)
DDR1_DQS0M: U8.AA1(DDR1_DQS0n) U9.Y1(DDR_DQS1n-a)
DDR1_DQS0P: U8.AA2(DDR1_DQS0) U9.Y2(DDR_DQS1-a)
DDR1_DQS1M: U8.G1(DDR1_DQS1n) U9.R2(DDR_DQS0n-a)
DDR1_DQS1P: U8.G2(DDR1_DQS1) U9.R3(DDR_DQS0-a)
DDR1_DQS2M: U8.U1(DDR1_DQS2n) U9.AF5(DDR_DQS3n-a)
DDR1_DQS2P: U8.U2(DDR1_DQS2) U9.AF4(DDR_DQS3-a)
DDR1_DQS3M: U8.D1(DDR1_DQS3n) U9.H2(DDR_DQS2n-a)
DDR1_DQS3P: U8.D2(DDR1_DQS3) U9.H1(DDR_DQS2-a)
DDR1_DTO0: T4.1 U8.U8(DDR1_DTO0)
DDR1_DTO1: T3.1 U8.R8(DDR1_DTO1)
DDR1_RETLE: R58.1 R59.1 U8.H7(DDR1_RETLE)
DDRIO_RETEN: R59.2 ; off-sheet DDRIO_RETEN
NetC138_1: C138.1 R52.2 U10.3(~{SHDN})
NetC139_1: C139.1 U10.4(BP)
NetR50_1: R50.1 U9.AE27(DDR_ZQ-a)
NetR53_1: R53.1 U8.U7(DDR1_PZQ)

Not connected (* = marked no-connect by the designer): U8 F2(DDR1_RESET) H1(DDR1_CASn) J1(DDR1_BA1) J2(DDR1_WEn) L4(DDR1_BA0) L5(DDR1_BA2) L6(DDR1_RASn) L7(NC6) M7(DDR1_ATO) N2(DDR1_A10) P2(DDR1_A14) P3(DDR1_A13) P4(DDR1_A11) P5(DDR1_ODT0) P6(DDR1_A12) P7(NC4) R1(DDR1_A15) R2(DDR1_ODT1) R7(NC5); U9 A1(NC2) A5(DDR_D29-b) A6(DDR_D28-b) A8(DDR_D25-b) A9(DDR_D24-b) A10(DDR_DQS3n-b) A11(DDR_DM3-b) A12(DDR_D15-b) A14(DDR_D13-b) A15(DDR_D11-b) A17(DDR_D9-b) A18(DDR_DQS1n-b) A19(DDR_DM1-b) A23(DDR_DQS0n-b) A24(DDR_D7-b) A27(NC1) AF14(DDR_A9-b) AF15(DDR_A7-b) AF19(DDR_CLK-b) AF20(DDR_CKE1-b) AF21(DDR_CS0-b) AF22(DDR_A4-b) AF24(DDR_A2-b) AF25(DDR_A0-b) AG1(NC4) AG12(DDR_ZQ-b) AG14(DDR_A8-b) AG15(DDR_A6-b) AG16(DDR_A5-b) AG19(DDR_CLKn-b) AG20(DDR_CKE0-b) AG21(DDR_CS1-b) AG23(DDR_A3-b) AG24(DDR_A1-b) AG27(NC3) B4(DDR_D31-b) B5(DDR_D30-b) B7(DDR_D27-b) B8(DDR_D26-b) B10(DDR_DQS3-b) B13(DDR_D14-b) B14(DDR_D12-b) B16(DDR_D10-b) B17(DDR_D8-b) B18(DDR_DQS1-b) B22(DDR_DM0-b) B23(DDR_DQS0-b) B25(DDR_D6-b) C26(DDR_D5-b) C27(DDR_D4-b) D27(DDR_D3-b) E25(DDR_D2-b) E26(DDR_D1-b) F27(DDR_D0-b) G25(DDR_DM2-b) G26(DDR_DQS2-b) H26(DDR_DQS2n-b) H27(DDR_D23-b) J25(DDR_D21-b) J26(DDR_D22-b) K27(DDR_D20-b) L25(DDR_D19-b) L26(DDR_D18-b) M27(DDR_D17-b) N25(DDR_D16-b)

### Notes on the sheet
- (near U9) VACC
- (near U9) VDD1
- (near U9) 1.8V
- (near U9) VDDQ
- (near U9) VDDCA
- (near U9) VDD2
- (near U9) VREFDQ
- (near U9) VCC_DDR
- (near U9) VCC18_DDR
- (near U9) VDDQ/2
- (near U9) 1.2V
- (near U9) 0.6V
- (near U9) VREFCA
- (near U9) VDDCA/2
- (in symbol K3PE0E000E_1) LPDDR2 ：双通道 POP封装  220-BALL; A通道; B通道

### Library data of the parts
C127 C129 C130 C132-C135 C144-C152 = CAP NP_0_Dup1
C128 C131 C140-C143 = CAP NP_4
C136 C137 = CAP NP_4: CAP,MLCC,10uF,+/-10%,X5R,6.3V,SMD0805; Supplier: MURATA; Supplier P/N: GRM21BR61C106K
C138 C139 = CAP NP_4: CAP,MLCC,100nF,+/-10%,X7R,6.3V,SMD0402
R50 R52-R59 = RESISTOR_0_Dup1: 贴片电阻
T3 T4 = TEST_0
U8 = MCU_RK3288_3
U9 = K3PE0E000E_1
U10 = DS8008_4: LDO,PT5108E23E-33,VINmax=5.5V,Vout=3.3V,+/-2%,500mA,SOT-23-5

## Sheet 13.SchDoc
size 297 x 209 mm
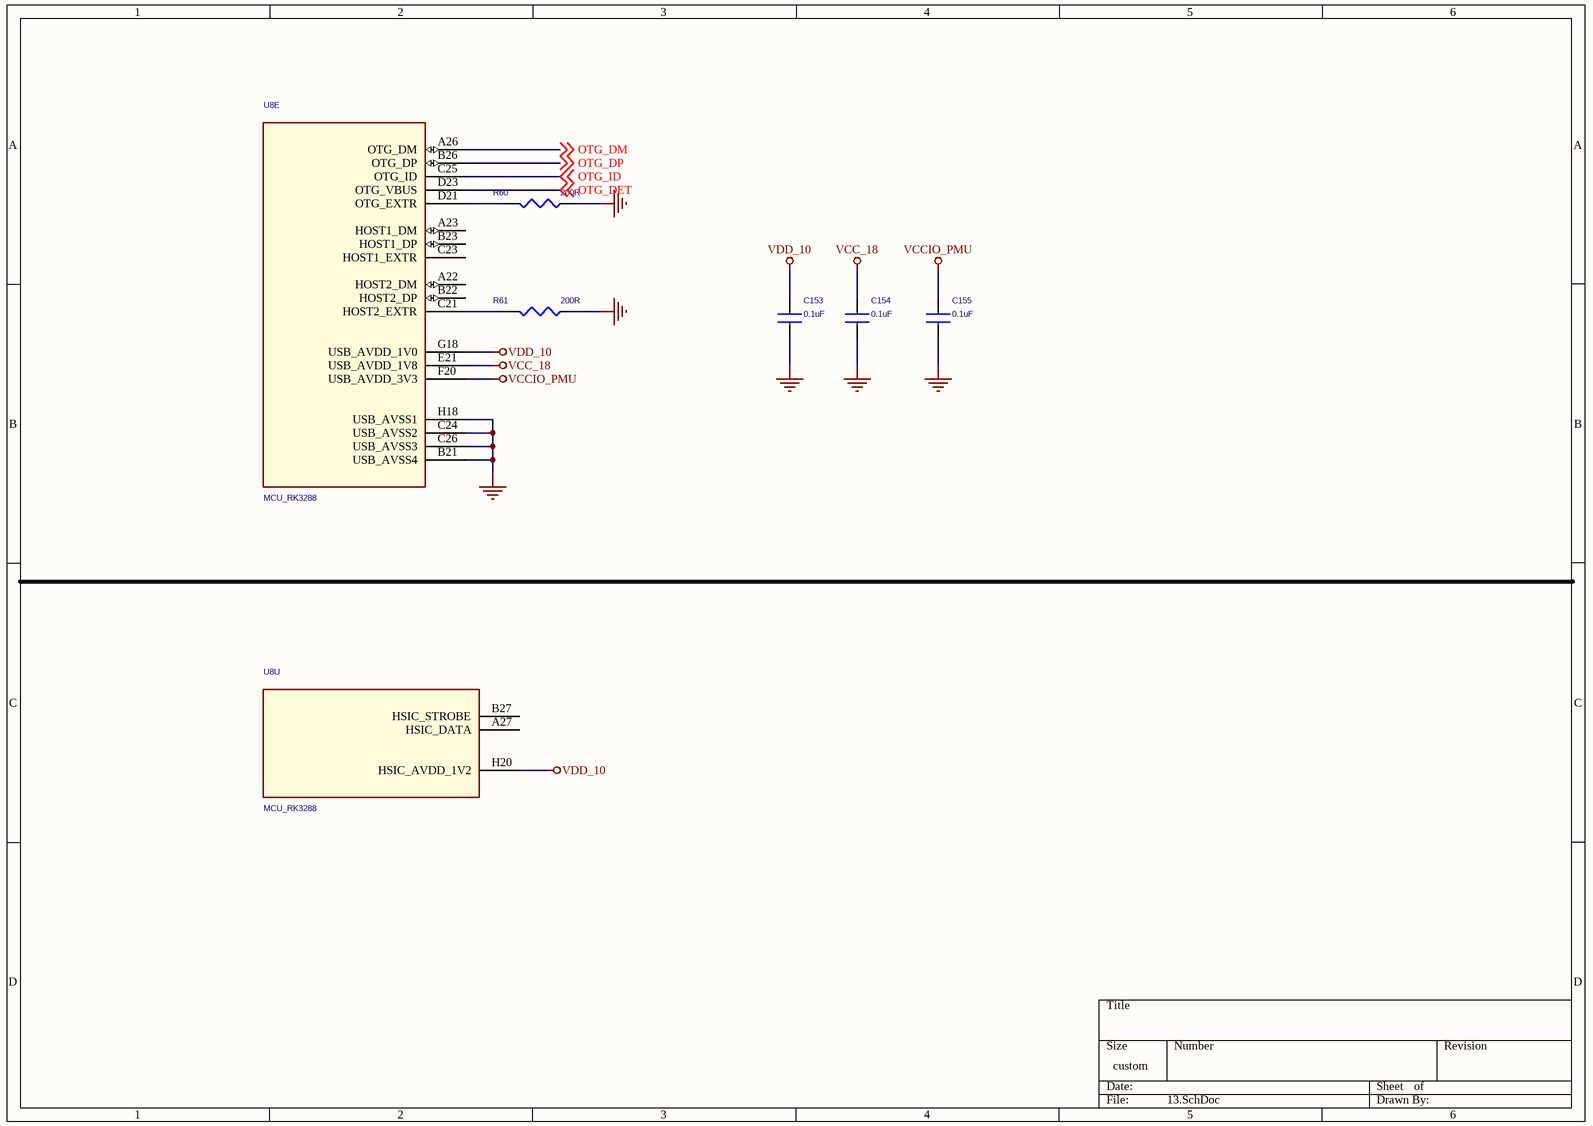
[diagram p13: 13.SchDoc]

### Parts
C153  0.1uF  [C0603]
C154  0.1uF  [C0603]
C155  0.1uF  [C0603]
R60  200R  [r0402]
R61  200R  [r0402]
U8  MCU_RK3288  [BGA453-19X19]  (parts E,U of 24)

### Nets
GND: C153.1 C154.1 C155.1 R60.1 R61.1 U8.B21(USB_AVSS4) U8.C24(USB_AVSS2) U8.C26(USB_AVSS3) U8.H18(USB_AVSS1)
VCC_18: C154.2 U8.E21(USB_AVDD_1V8)
VCCIO_PMU: C155.2 U8.F20(USB_AVDD_3V3)
VDD_10: C153.2 U8.G18(USB_AVDD_1V0) U8.H20(HSIC_AVDD_1V2)
OTG_DET: U8.D23(OTG_VBUS) ; off-sheet OTG_DET
OTG_DM: U8.A26(OTG_DM) ; off-sheet OTG_DM
OTG_DP: U8.B26(OTG_DP) ; off-sheet OTG_DP
OTG_ID: U8.C25(OTG_ID) ; off-sheet OTG_ID
NetR60_2: R60.2 U8.D21(OTG_EXTR)
NetR61_2: R61.2 U8.C21(HOST2_EXTR)

Not connected (* = marked no-connect by the designer): U8 A22(HOST2_DM) A23(HOST1_DM) A27(HSIC_DATA) B22(HOST2_DP) B23(HOST1_DP) B27(HSIC_STROBE) C23(HOST1_EXTR)

### Library data of the parts
C153 C154 = CAP NP_Dup3: 贴片电容; MARK: 106; ROOM: USB+5V
C155 = CAP NP_Dup3: 贴片电容; ROOM: USB+5V; MARK: 106
R60 R61 = RESISTOR_1_Dup2
U8 = MCU_RK3288_3

## Sheet 14.SchDoc
size 297 x 209 mm
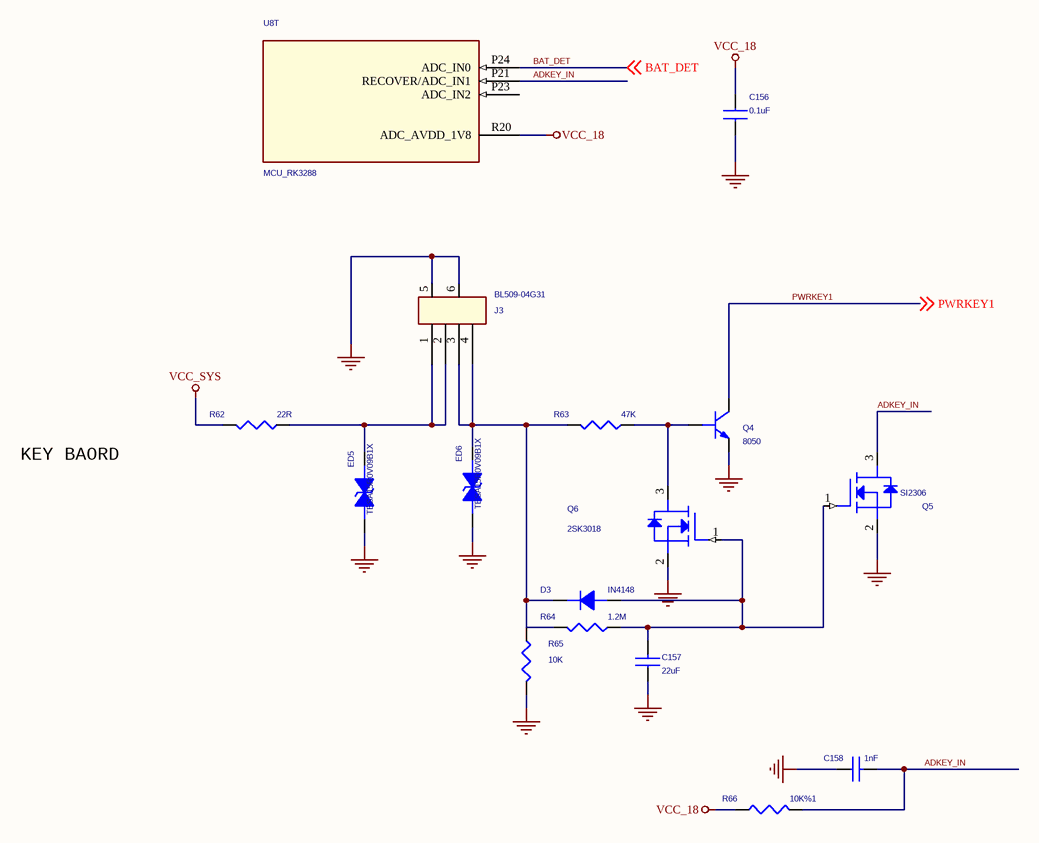
[diagram p14: 14.SchDoc]

### Parts
C156  0.1uF  [C0603]
C157  22uF  [C0402]
C158  1nF  [C0402]
D3  IN4148  [SOD323]
ED5  TESA15R0V09B1X  [E0402N]
ED6  TESA15R0V09B1X  [E0402N]
J3  BL509-04G31  [BL509-04G31]
Q4  8050  [SOT23]
Q5  SI2306  [SOT23]
Q6  2SK3018  [SOT23]
R62  22R  [R0402]
R63  47K  [R0402]
R64  1.2M  [R0402]
R65  10K  [R0402]
R66  10K%1  [R0402]
U8  MCU_RK3288  [BGA453-19X19]  (part T of 24)

### Nets
GND: C156.1 C157.1 C158.1 ED5.2 ED6.2 J3.5 J3.6 Q4.2(E) Q5.2(SOURCE) Q6.2(SOURCE) R65.2
VCC_18: C156.2 R66.1 U8.R20(ADC_AVDD_1V8)
VCC_SYS: R62.2
ADKEY_IN: C158.2 Q5.3(DRAIN) R66.2 U8.P21(RECOVER/ADC_IN1)
BAT_DET: U8.P24(ADC_IN0) ; off-sheet BAT_DET
PWRKEY1: Q4.3(C) ; off-sheet PWRKEY1
NetC157_2: C157.2 D3.1(A) Q5.1(GATE) Q6.1(GATE) R64.1
NetD3_2: D3.2(K) ED6.1 J3.3 J3.4 R63.2 R64.2 R65.1
NetED5_1: ED5.1 J3.1 J3.2 R62.1
NetQ4_1: Q4.1(B) Q6.3(DRAIN) R63.1

Not connected (* = marked no-connect by the designer): U8 P23(ADC_IN2)

### Notes on the sheet
- KEY BAORD

### Library data of the parts
C156 = CAP NP_Dup3: 贴片电容; MARK: 106; ROOM: USB+5V
C157 = CAP NP_Dup2: RoHS CHIP CAP 4.7uF 25V +10/-10% 16V X7R; MARK: 106; ROOM: USB+5V
C158 = CAP NP_Dup2: RoHS CHIP CAP 1nF +10/-10% X7R
D3 = DIODE_Dup1: Diode,Schottky,1N5819HW,40V,500mA,450mV,SOD-323; Supplier P/N: 1N5819HW; Supplier: DIODES
ED5 ED6 = TVS: ESD Component,5V,30P,SMD,0402
J3 = CON4_0
Q4 = 40852_1: Trans NPN,SS8050,25V,1500mA,10~60@Vce=1V,Ic=500mA, SOT-23
Q5 Q6 = MOSFET N: MOSFET-N,WNM2021 ,20V,+/-8V,0.8A,300m Ohm@Vgs=4.5V,SOT23
R62-R65 = RESISTOR_Dup1: ROHS CHIP RES 51K 1/16W ±5%
R66 = RESISTOR_Dup1: ROHS CHIP RES 10K 1/16W +/-1%
U8 = MCU_RK3288_3

## Sheet 15.SchDoc
size 297 x 209 mm
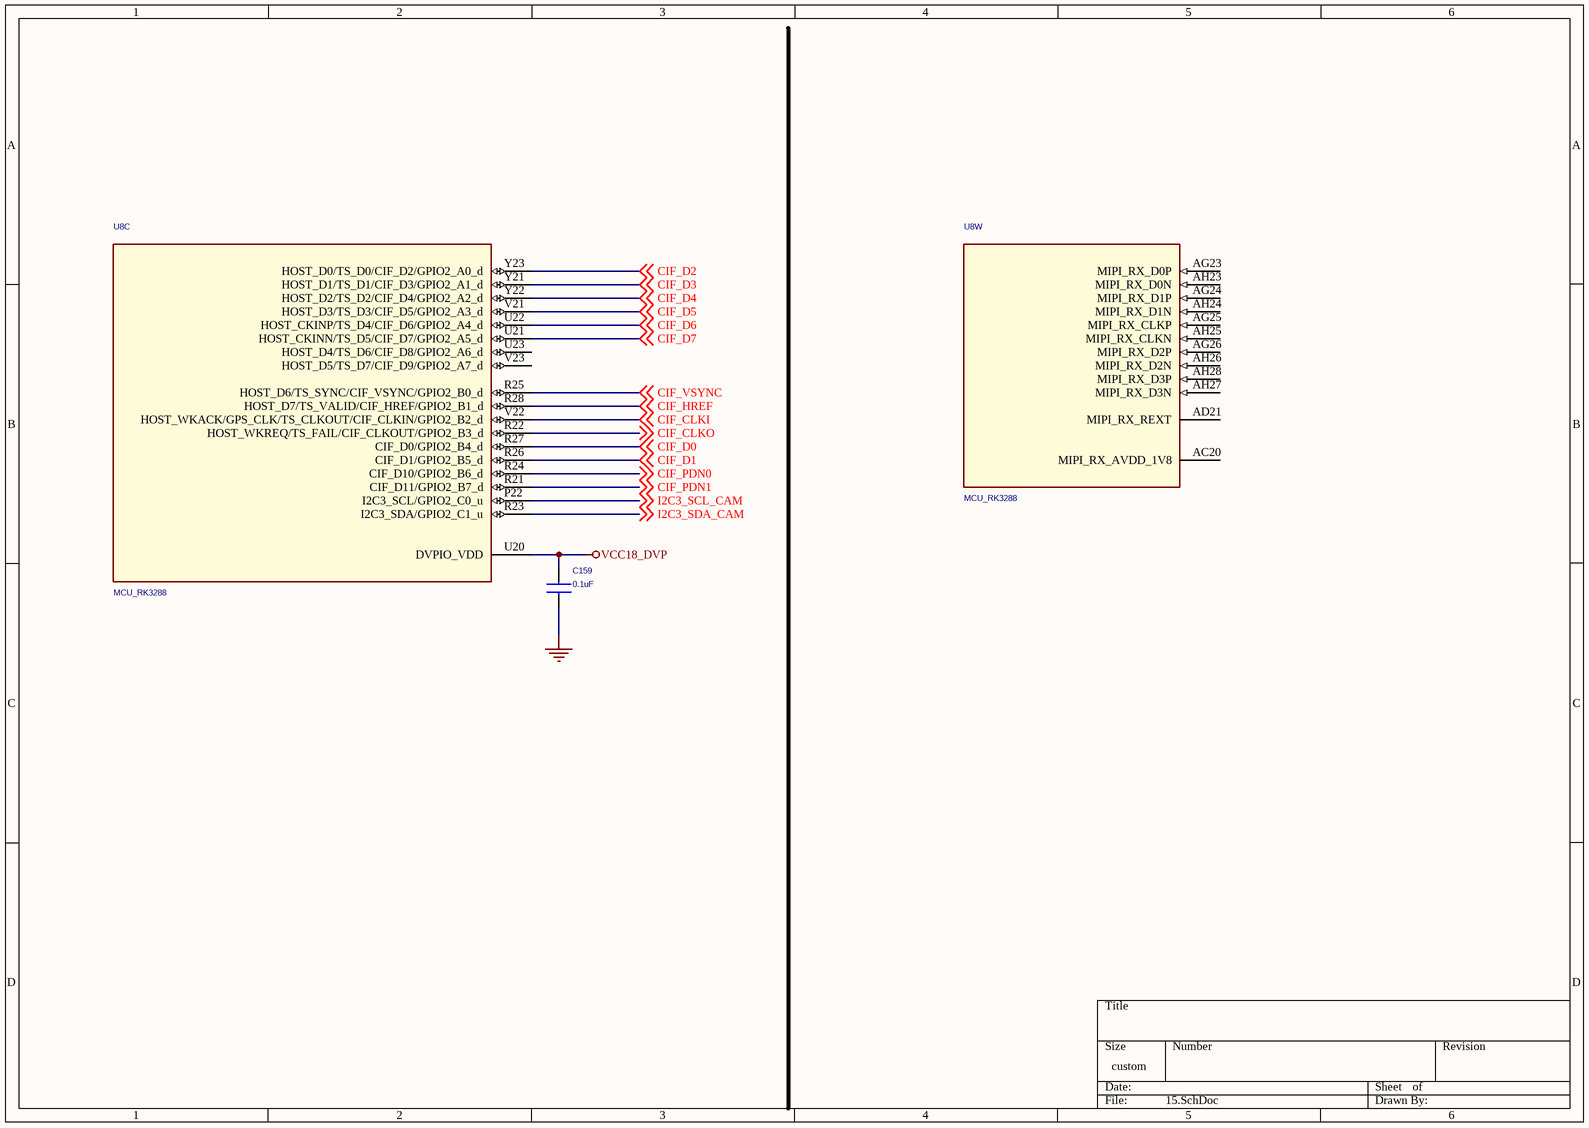
[diagram p15: 15.SchDoc]

### Parts
C159  0.1uF  [C0603]
U8  MCU_RK3288  [BGA453-19X19]  (parts C,W of 24)

### Nets
GND: C159.2
VCC18_DVP: C159.1 U8.U20(DVPIO_VDD)
CIF_CLKI: U8.V22(HOST_WKACK/GPS_CLK/TS_CLKOUT/CIF_CLKIN/GPIO2_B2_d) ; off-sheet CIF_CLKI
CIF_CLKO: U8.R22(HOST_WKREQ/TS_FAIL/CIF_CLKOUT/GPIO2_B3_d) ; off-sheet CIF_CLKO
CIF_D0: U8.R27(CIF_D0/GPIO2_B4_d) ; off-sheet CIF_D0
CIF_D1: U8.R26(CIF_D1/GPIO2_B5_d) ; off-sheet CIF_D1
CIF_D2: U8.Y23(HOST_D0/TS_D0/CIF_D2/GPIO2_A0_d) ; off-sheet CIF_D2
CIF_D3: U8.Y21(HOST_D1/TS_D1/CIF_D3/GPIO2_A1_d) ; off-sheet CIF_D3
CIF_D4: U8.Y22(HOST_D2/TS_D2/CIF_D4/GPIO2_A2_d) ; off-sheet CIF_D4
CIF_D5: U8.V21(HOST_D3/TS_D3/CIF_D5/GPIO2_A3_d) ; off-sheet CIF_D5
CIF_D6: U8.U22(HOST_CKINP/TS_D4/CIF_D6/GPIO2_A4_d) ; off-sheet CIF_D6
CIF_D7: U8.U21(HOST_CKINN/TS_D5/CIF_D7/GPIO2_A5_d) ; off-sheet CIF_D7
CIF_HREF: U8.R28(HOST_D7/TS_VALID/CIF_HREF/GPIO2_B1_d) ; off-sheet CIF_HREF
CIF_PDN0: U8.R24(CIF_D10/GPIO2_B6_d) ; off-sheet CIF_PDN0
CIF_PDN1: U8.R21(CIF_D11/GPIO2_B7_d) ; off-sheet CIF_PDN1
CIF_VSYNC: U8.R25(HOST_D6/TS_SYNC/CIF_VSYNC/GPIO2_B0_d) ; off-sheet CIF_VSYNC
I2C3_SCL_CAM: U8.P22(I2C3_SCL/GPIO2_C0_u) ; off-sheet I2C3_SCL_CAM
I2C3_SDA_CAM: U8.R23(I2C3_SDA/GPIO2_C1_u) ; off-sheet I2C3_SDA_CAM

Not connected (* = marked no-connect by the designer): U8 AC20(MIPI_RX_AVDD_1V8) AD21(MIPI_RX_REXT) AG23(MIPI_RX_D0P) AG24(MIPI_RX_D1P) AG25(MIPI_RX_CLKP) AG26(MIPI_RX_D2P) AH23(MIPI_RX_D0N) AH24(MIPI_RX_D1N) AH25(MIPI_RX_CLKN) AH26(MIPI_RX_D2N) AH27(MIPI_RX_D3N) AH28(MIPI_RX_D3P) U23(HOST_D4/TS_D6/CIF_D8/GPIO2_A6_d) V23(HOST_D5/TS_D7/CIF_D9/GPIO2_A7_d)

### Library data of the parts
C159 = CAP NP_Dup3: CAP,MLCC,1uF,+/-10%,X5R,6.3V,SMD0402
U8 = MCU_RK3288_3

## Sheet 16.SchDoc
size 420 x 297 mm
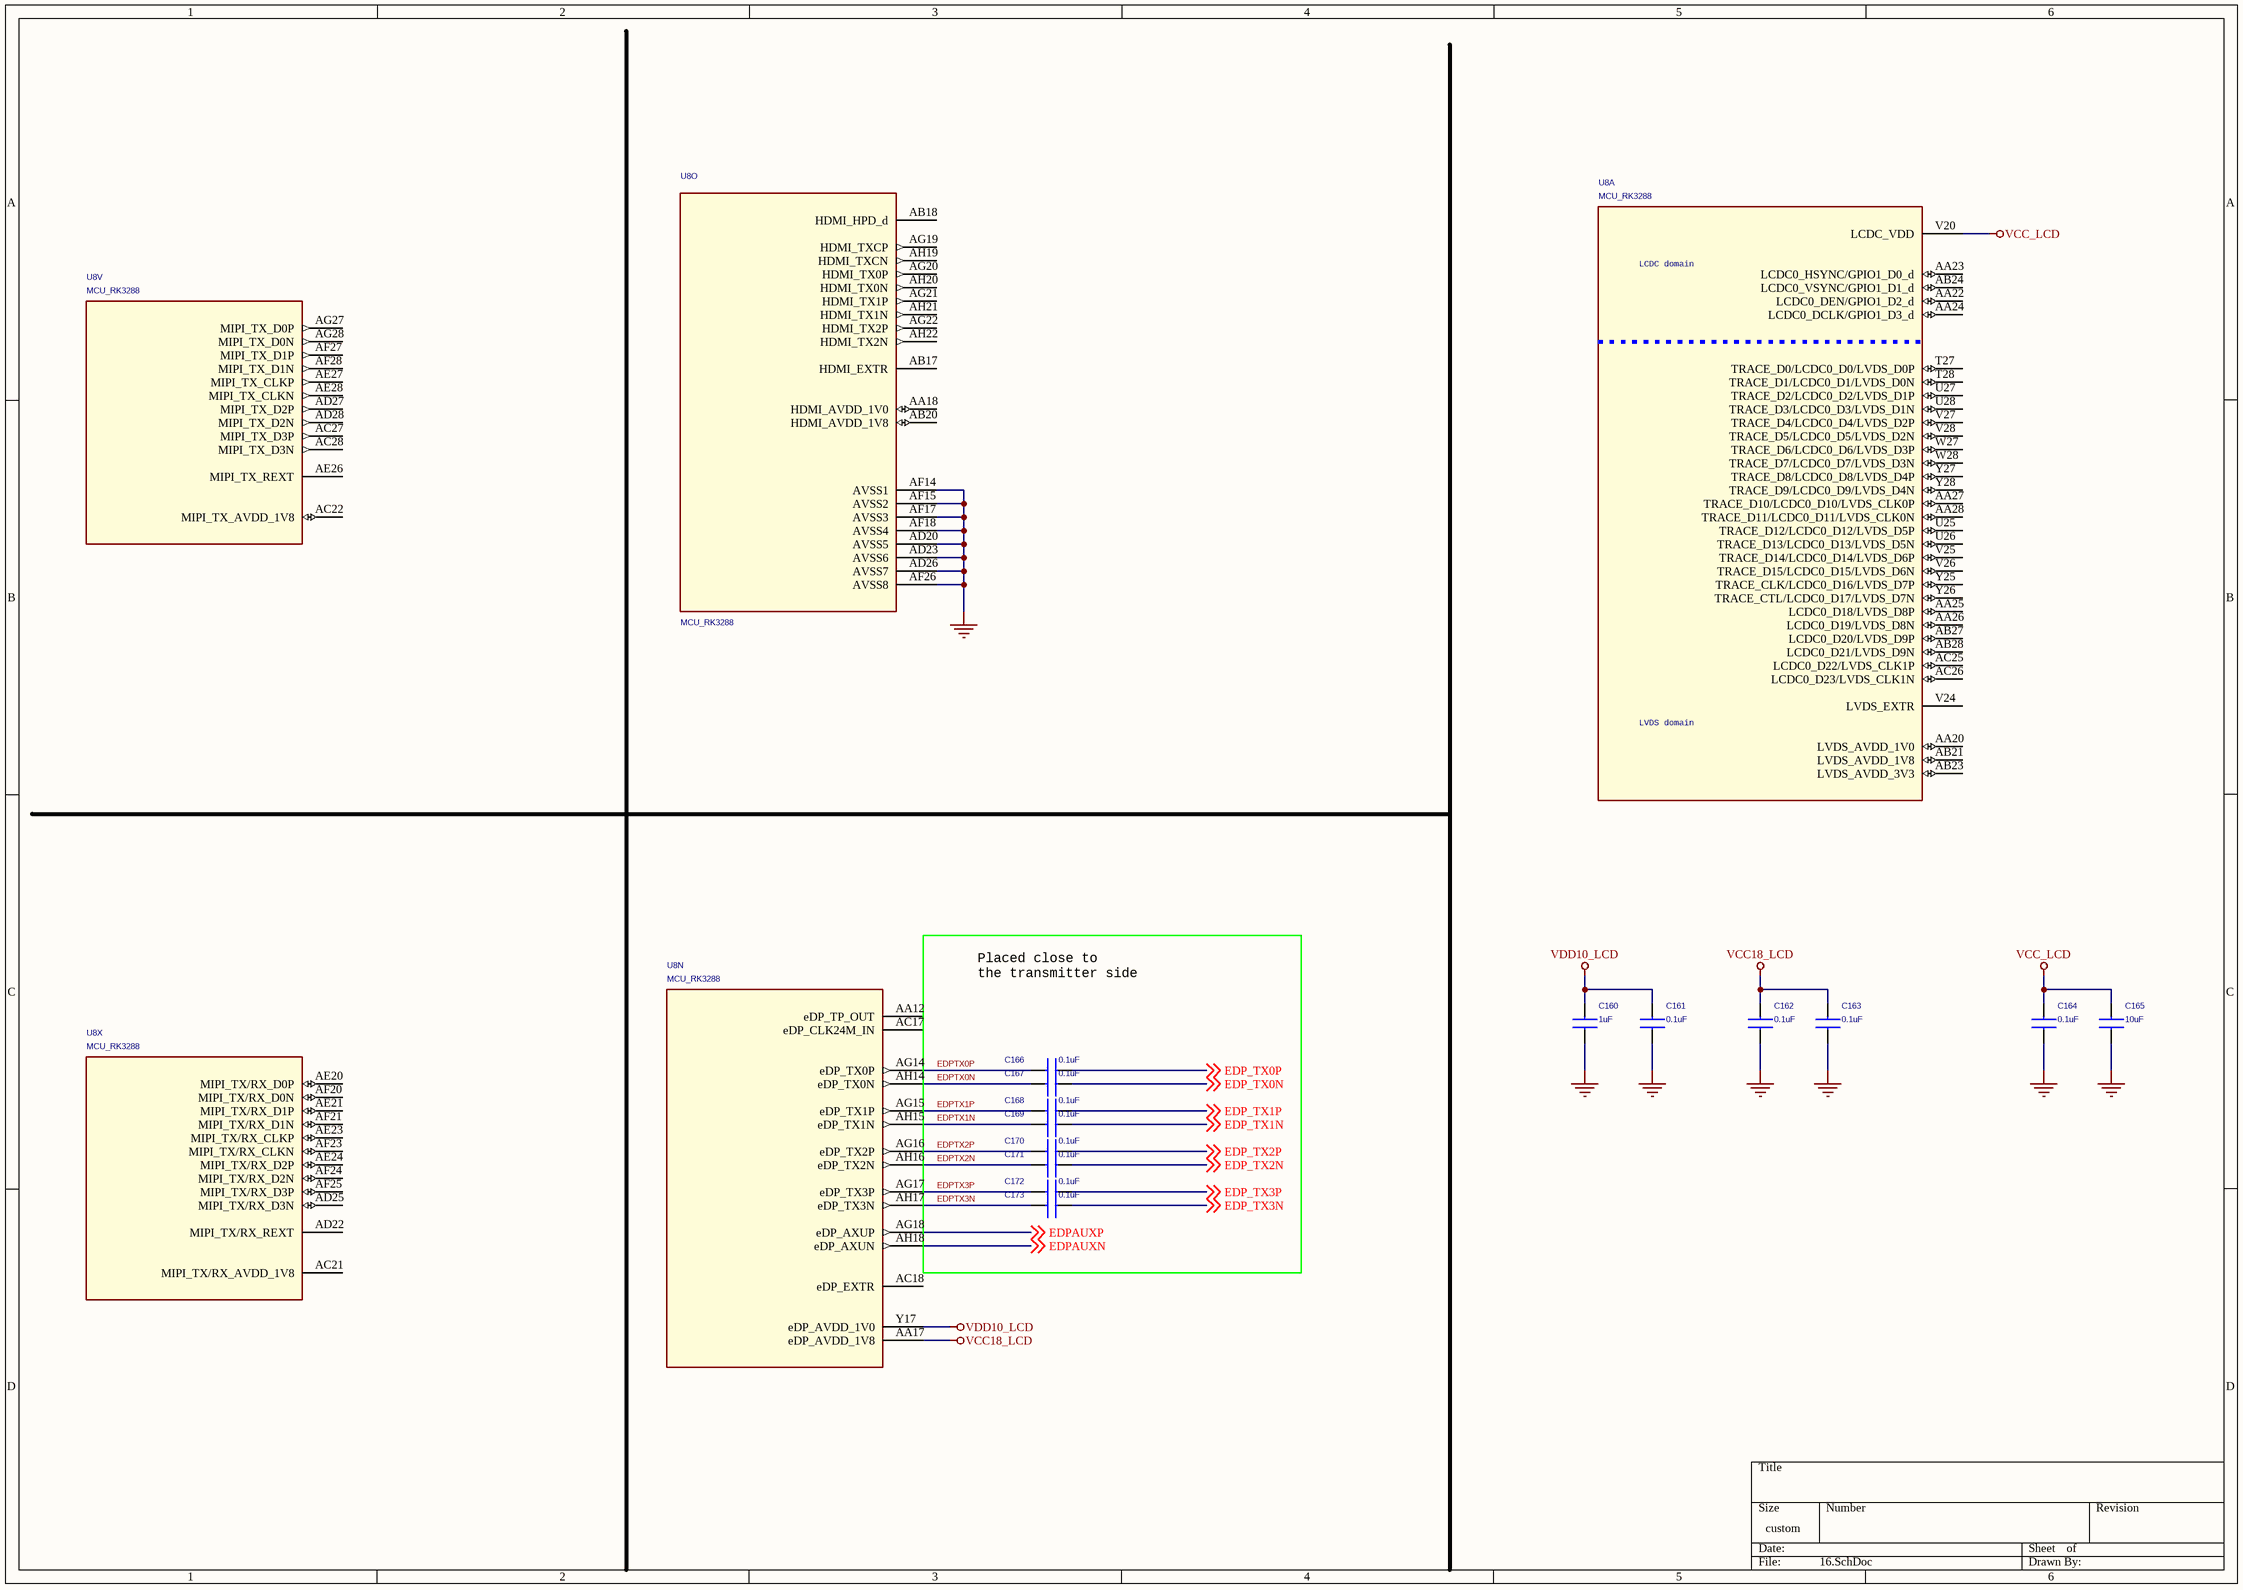
[diagram p16: 16.SchDoc]

### Parts
C160  1uF  [C0603]
C161  0.1uF  [C0603]
C162  0.1uF  [C0603]
C163  0.1uF  [C0603]
C164  0.1uF  [C0603]
C165  10uF  [C0603]
C166  0.1uF  [C0603]
C167  0.1uF  [C0603]
C168  0.1uF  [C0603]
C169  0.1uF  [C0603]
C170  0.1uF  [C0603]
C171  0.1uF  [C0603]
C172  0.1uF  [C0603]
C173  0.1uF  [C0603]
U8  MCU_RK3288  [BGA453-19X19]  (parts A,N,O,V,X of 24)

### Nets
GND: C160.2 C161.2 C162.2 C163.2 C164.2 C165.2 U8.AD20(AVSS5) U8.AD23(AVSS6) U8.AD26(AVSS7) U8.AF14(AVSS1) U8.AF15(AVSS2) U8.AF17(AVSS3) U8.AF18(AVSS4) U8.AF26(AVSS8)
VCC18_LCD: C162.1 C163.1 U8.AA17(eDP_AVDD_1V8)
VCC_LCD: C164.1 C165.1 U8.V20(LCDC_VDD)
VDD10_LCD: C160.1 C161.1 U8.Y17(eDP_AVDD_1V0)
EDP_TX0N: C167.2 ; off-sheet EDP_TX0N
EDP_TX0P: C166.2 ; off-sheet EDP_TX0P
EDP_TX1N: C169.2 ; off-sheet EDP_TX1N
EDP_TX1P: C168.2 ; off-sheet EDP_TX1P
EDP_TX2N: C171.2 ; off-sheet EDP_TX2N
EDP_TX2P: C170.2 ; off-sheet EDP_TX2P
EDP_TX3N: C173.2 ; off-sheet EDP_TX3N
EDP_TX3P: C172.2 ; off-sheet EDP_TX3P
EDPAUXN: U8.AH18(eDP_AXUN) ; off-sheet EDPAUXN
EDPAUXP: U8.AG18(eDP_AXUP) ; off-sheet EDPAUXP
EDPTX0N: C167.1 U8.AH14(eDP_TX0N)
EDPTX0P: C166.1 U8.AG14(eDP_TX0P)
EDPTX1N: C169.1 U8.AH15(eDP_TX1N)
EDPTX1P: C168.1 U8.AG15(eDP_TX1P)
EDPTX2N: C171.1 U8.AH16(eDP_TX2N)
EDPTX2P: C170.1 U8.AG16(eDP_TX2P)
EDPTX3N: C173.1 U8.AH17(eDP_TX3N)
EDPTX3P: C172.1 U8.AG17(eDP_TX3P)

Not connected (* = marked no-connect by the designer): U8 AA12(eDP_TP_OUT) AA18(HDMI_AVDD_1V0) AA20(LVDS_AVDD_1V0) AA22(LCDC0_DEN/GPIO1_D2_d) AA23(LCDC0_HSYNC/GPIO1_D0_d) AA24(LCDC0_DCLK/GPIO1_D3_d) AA25(LCDC0_D18/LVDS_D8P) AA26(LCDC0_D19/LVDS_D8N) AA27(TRACE_D10/LCDC0_D10/LVDS_CLK0P) AA28(TRACE_D11/LCDC0_D11/LVDS_CLK0N) AB17(HDMI_EXTR) AB18(HDMI_HPD_d) AB20(HDMI_AVDD_1V8) AB21(LVDS_AVDD_1V8) AB23(LVDS_AVDD_3V3) AB24(LCDC0_VSYNC/GPIO1_D1_d) AB27(LCDC0_D20/LVDS_D9P) AB28(LCDC0_D21/LVDS_D9N) AC17(eDP_CLK24M_IN) AC18(eDP_EXTR) AC21(MIPI_TX/RX_AVDD_1V8) AC22(MIPI_TX_AVDD_1V8) AC25(LCDC0_D22/LVDS_CLK1P) AC26(LCDC0_D23/LVDS_CLK1N) AC27(MIPI_TX_D3P) AC28(MIPI_TX_D3N) AD22(MIPI_TX/RX_REXT) AD25(MIPI_TX/RX_D3N) AD27(MIPI_TX_D2P) AD28(MIPI_TX_D2N) AE20(MIPI_TX/RX_D0P) AE21(MIPI_TX/RX_D1P) AE23(MIPI_TX/RX_CLKP) AE24(MIPI_TX/RX_D2P) AE26(MIPI_TX_REXT) AE27(MIPI_TX_CLKP) AE28(MIPI_TX_CLKN) AF20(MIPI_TX/RX_D0N) AF21(MIPI_TX/RX_D1N) AF23(MIPI_TX/RX_CLKN) AF24(MIPI_TX/RX_D2N) AF25(MIPI_TX/RX_D3P) AF27(MIPI_TX_D1P) AF28(MIPI_TX_D1N) AG19(HDMI_TXCP) AG20(HDMI_TX0P) AG21(HDMI_TX1P) AG22(HDMI_TX2P) AG27(MIPI_TX_D0P) AG28(MIPI_TX_D0N) AH19(HDMI_TXCN) AH20(HDMI_TX0N) AH21(HDMI_TX1N) AH22(HDMI_TX2N) T27(TRACE_D0/LCDC0_D0/LVDS_D0P) T28(TRACE_D1/LCDC0_D1/LVDS_D0N) U25(TRACE_D12/LCDC0_D12/LVDS_D5P) U26(TRACE_D13/LCDC0_D13/LVDS_D5N) U27(TRACE_D2/LCDC0_D2/LVDS_D1P) U28(TRACE_D3/LCDC0_D3/LVDS_D1N) V24(LVDS_EXTR) V25(TRACE_D14/LCDC0_D14/LVDS_D6P) V26(TRACE_D15/LCDC0_D15/LVDS_D6N) V27(TRACE_D4/LCDC0_D4/LVDS_D2P) V28(TRACE_D5/LCDC0_D5/LVDS_D2N) W27(TRACE_D6/LCDC0_D6/LVDS_D3P) W28(TRACE_D7/LCDC0_D7/LVDS_D3N) Y25(TRACE_CLK/LCDC0_D16/LVDS_D7P) Y26(TRACE_CTL/LCDC0_D17/LVDS_D7N) Y27(TRACE_D8/LCDC0_D8/LVDS_D4P) Y28(TRACE_D9/LCDC0_D9/LVDS_D4N)

### Notes on the sheet
- Placed close to
  the transmitter side
- (in symbol MCU_RK3288_3, part A) LCDC domain; LVDS domain

### Library data of the parts
C160-C164 C166-C173 = CAP NP_Dup3: CAP,MLCC,100nF,+/-10%,X7R,6.3V,SMD0402
C165 = CAP NP_Dup3: CAP,MLCC,4.7uF,+/-10%,X5R,6.3V,SMD0603
U8 = MCU_RK3288_3

## Sheet 17.SchDoc
size 297 x 209 mm
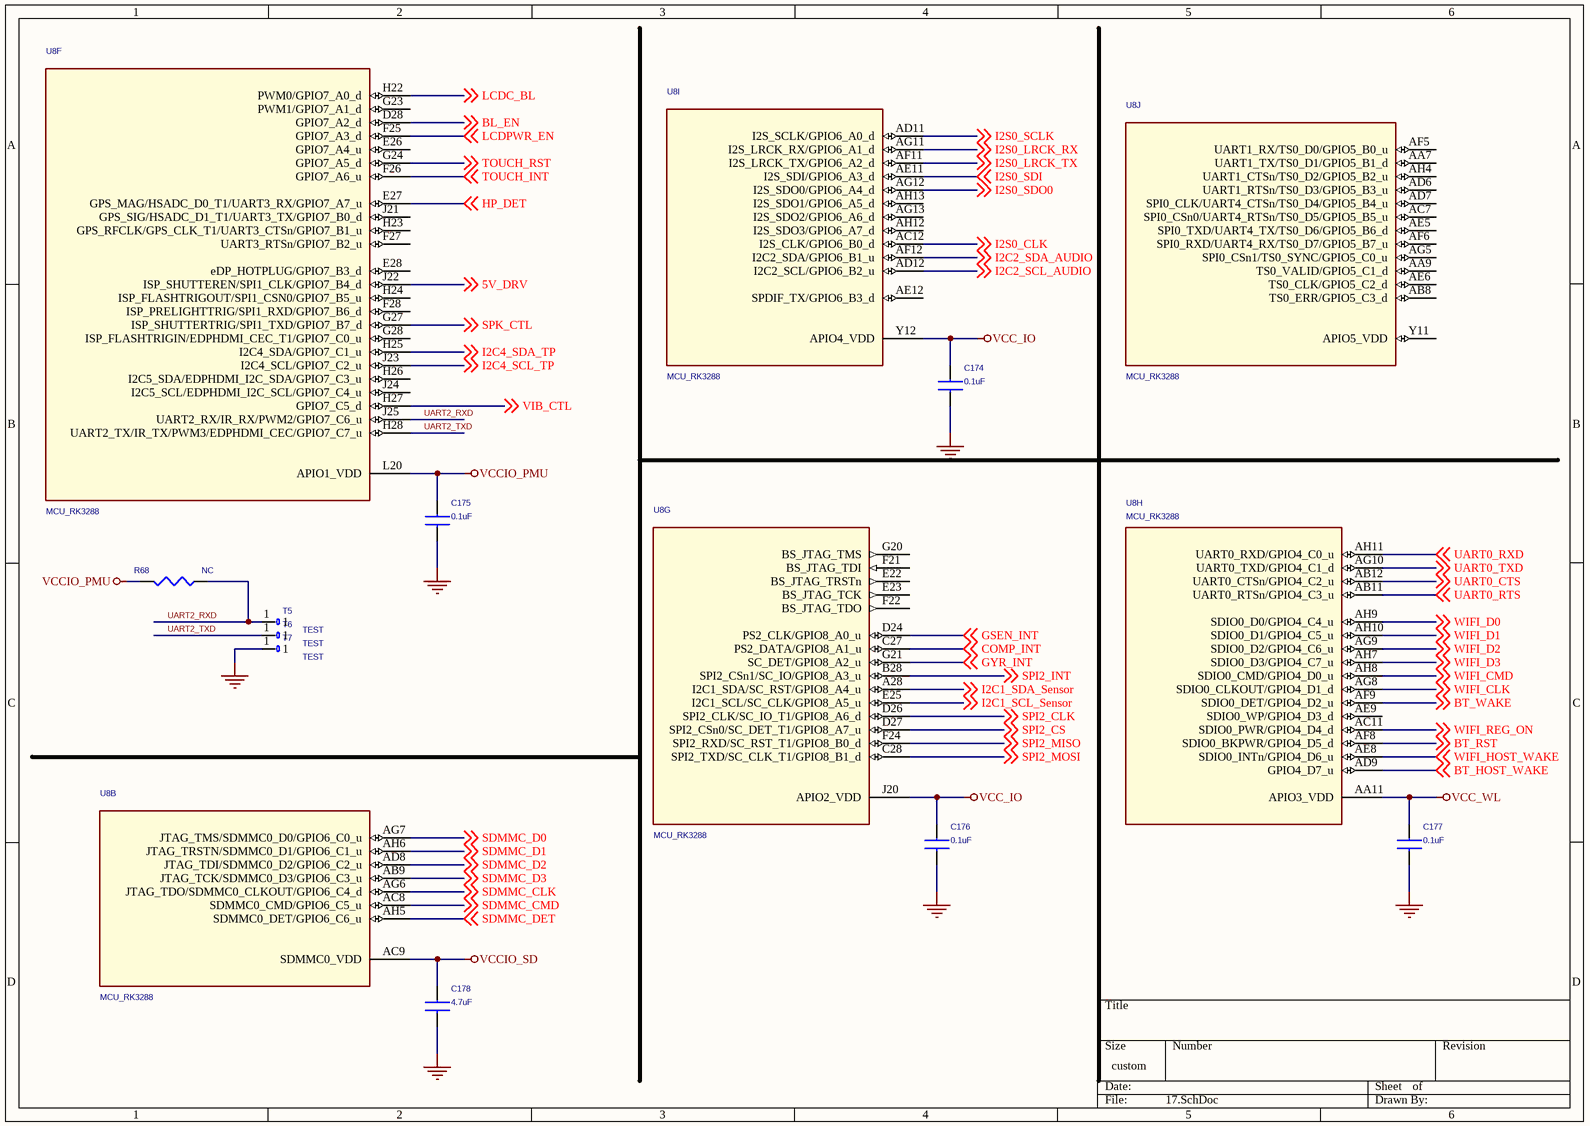
[diagram p17: 17.SchDoc]

### Parts
C174  0.1uF  [C0603]
C175  0.1uF  [C0603]
C176  0.1uF  [C0603]
C177  0.1uF  [C0603]
C178  4.7uF  [C0603]
R68  NC  [r0402]
T5  TEST  [TEST]
T6  TEST  [TEST]
T7  TEST  [TEST]
U8  MCU_RK3288  [BGA453-19X19]  (parts B,F,G,H,I,J of 24)

### Nets
GND: C174.1 C175.1 C176.2 C177.1 C178.2 T7.1
VCC_IO: C174.2 C176.1 U8.J20(APIO2_VDD) U8.Y12(APIO4_VDD)
VCC_WL: C177.2 U8.AA11(APIO3_VDD)
VCCIO_PMU: C175.2 R68.2 U8.L20(APIO1_VDD)
VCCIO_SD: C178.1 U8.AC9(SDMMC0_VDD)
5V_DRV: U8.J22(ISP_SHUTTEREN/SPI1_CLK/GPIO7_B4_d) ; off-sheet 5V_DRV
BL_EN: U8.D28(GPIO7_A2_d) ; off-sheet BL_EN
BT_HOST_WAKE: U8.AD9(GPIO4_D7_u) ; off-sheet BT_HOST_WAKE
BT_RST: U8.AF8(SDIO0_BKPWR/GPIO4_D5_d) ; off-sheet BT_RST
BT_WAKE: U8.AF9(SDIO0_DET/GPIO4_D2_u) ; off-sheet BT_WAKE
COMP_INT: U8.C27(PS2_DATA/GPIO8_A1_u) ; off-sheet COMP_INT
GSEN_INT: U8.D24(PS2_CLK/GPIO8_A0_u) ; off-sheet GSEN_INT
GYR_INT: U8.G21(SC_DET/GPIO8_A2_u) ; off-sheet GYR_INT
HP_DET: U8.E27(GPS_MAG/HSADC_D0_T1/UART3_RX/GPIO7_A7_u) ; off-sheet HP_DET
I2C1_SCL_Sensor: U8.E25(I2C1_SCL/SC_CLK/GPIO8_A5_u) ; off-sheet I2C1_SCL_Sensor
I2C1_SDA_Sensor: U8.A28(I2C1_SDA/SC_RST/GPIO8_A4_u) ; off-sheet I2C1_SDA_Sensor
I2C2_SCL_AUDIO: U8.AD12(I2C2_SCL/GPIO6_B2_u) ; off-sheet I2C2_SCL_AUDIO
I2C2_SDA_AUDIO: U8.AF12(I2C2_SDA/GPIO6_B1_u) ; off-sheet I2C2_SDA_AUDIO
I2C4_SCL_TP: U8.J23(I2C4_SCL/GPIO7_C2_u) ; off-sheet I2C4_SCL_TP
I2C4_SDA_TP: U8.H25(I2C4_SDA/GPIO7_C1_u) ; off-sheet I2C4_SDA_TP
I2S0_CLK: U8.AC12(I2S_CLK/GPIO6_B0_d) ; off-sheet I2S0_CLK
I2S0_LRCK_RX: U8.AG11(I2S_LRCK_RX/GPIO6_A1_d) ; off-sheet I2S0_LRCK_RX
I2S0_LRCK_TX: U8.AF11(I2S_LRCK_TX/GPIO6_A2_d) ; off-sheet I2S0_LRCK_TX
I2S0_SCLK: U8.AD11(I2S_SCLK/GPIO6_A0_d) ; off-sheet I2S0_SCLK
I2S0_SDI: U8.AE11(I2S_SDI/GPIO6_A3_d) ; off-sheet I2S0_SDI
I2S0_SDO0: U8.AG12(I2S_SDO0/GPIO6_A4_d) ; off-sheet I2S0_SDO0
LCDC_BL: U8.H22(PWM0/GPIO7_A0_d) ; off-sheet LCDC_BL
LCDPWR_EN: U8.F25(GPIO7_A3_d) ; off-sheet LCDPWR_EN
SDMMC_CLK: U8.AG6(JTAG_TDO/SDMMC0_CLKOUT/GPIO6_C4_d) ; off-sheet SDMMC_CLK
SDMMC_CMD: U8.AC8(SDMMC0_CMD/GPIO6_C5_u) ; off-sheet SDMMC_CMD
SDMMC_D0: U8.AG7(JTAG_TMS/SDMMC0_D0/GPIO6_C0_u) ; off-sheet SDMMC_D0
SDMMC_D1: U8.AH6(JTAG_TRSTN/SDMMC0_D1/GPIO6_C1_u) ; off-sheet SDMMC_D1
SDMMC_D2: U8.AD8(JTAG_TDI/SDMMC0_D2/GPIO6_C2_u) ; off-sheet SDMMC_D2
SDMMC_D3: U8.AB9(JTAG_TCK/SDMMC0_D3/GPIO6_C3_u) ; off-sheet SDMMC_D3
SDMMC_DET: U8.AH5(SDMMC0_DET/GPIO6_C6_u) ; off-sheet SDMMC_DET
SPI2_CLK: U8.D26(SPI2_CLK/SC_IO_T1/GPIO8_A6_d) ; off-sheet SPI2_CLK
SPI2_CS: U8.D27(SPI2_CSn0/SC_DET_T1/GPIO8_A7_u) ; off-sheet SPI2_CS
SPI2_INT: U8.B28(SPI2_CSn1/SC_IO/GPIO8_A3_u) ; off-sheet SPI2_INT
SPI2_MISO: U8.F24(SPI2_RXD/SC_RST_T1/GPIO8_B0_d) ; off-sheet SPI2_MISO
SPI2_MOSI: U8.C28(SPI2_TXD/SC_CLK_T1/GPIO8_B1_d) ; off-sheet SPI2_MOSI
SPK_CTL: U8.G27(ISP_SHUTTERTRIG/SPI1_TXD/GPIO7_B7_d) ; off-sheet SPK_CTL
TOUCH_INT: U8.F26(GPIO7_A6_u) ; off-sheet TOUCH_INT
TOUCH_RST: U8.G24(GPIO7_A5_d) ; off-sheet TOUCH_RST
UART0_CTS: U8.AB12(UART0_CTSn/GPIO4_C2_u) ; off-sheet UART0_CTS
UART0_RTS: U8.AB11(UART0_RTSn/GPIO4_C3_u) ; off-sheet UART0_RTS
UART0_RXD: U8.AH11(UART0_RXD/GPIO4_C0_u) ; off-sheet UART0_RXD
UART0_TXD: U8.AG10(UART0_TXD/GPIO4_C1_d) ; off-sheet UART0_TXD
UART2_RXD: R68.1 T5.1 U8.J25(UART2_RX/IR_RX/PWM2/GPIO7_C6_u)
UART2_TXD: T6.1 U8.H28(UART2_TX/IR_TX/PWM3/EDPHDMI_CEC/GPIO7_C7_u)
VIB_CTL: U8.H27(GPIO7_C5_d) ; off-sheet VIB_CTL
WIFI_CLK: U8.AG8(SDIO0_CLKOUT/GPIO4_D1_d) ; off-sheet WIFI_CLK
WIFI_CMD: U8.AH8(SDIO0_CMD/GPIO4_D0_u) ; off-sheet WIFI_CMD
WIFI_D0: U8.AH9(SDIO0_D0/GPIO4_C4_u) ; off-sheet WIFI_D0
WIFI_D1: U8.AH10(SDIO0_D1/GPIO4_C5_u) ; off-sheet WIFI_D1
WIFI_D2: U8.AG9(SDIO0_D2/GPIO4_C6_u) ; off-sheet WIFI_D2
WIFI_D3: U8.AH7(SDIO0_D3/GPIO4_C7_u) ; off-sheet WIFI_D3
WIFI_HOST_WAKE: U8.AE8(SDIO0_INTn/GPIO4_D6_u) ; off-sheet WIFI_HOST_WAKE
WIFI_REG_ON: U8.AC11(SDIO0_PWR/GPIO4_D4_d) ; off-sheet WIFI_REG_ON

Not connected (* = marked no-connect by the designer): U8 AA7(UART1_TX/TS0_D1/GPIO5_B1_d) AA9(TS0_VALID/GPIO5_C1_d) AB8(TS0_ERR/GPIO5_C3_d) AC7(SPI0_CSn0/UART4_RTSn/TS0_D5/GPIO5_B5_u) AD6(UART1_RTSn/TS0_D3/GPIO5_B3_u) AD7(SPI0_CLK/UART4_CTSn/TS0_D4/GPIO5_B4_u) AE5(SPI0_TXD/UART4_TX/TS0_D6/GPIO5_B6_d) AE6(TS0_CLK/GPIO5_C2_d) AE9(SDIO0_WP/GPIO4_D3_d) AE12(SPDIF_TX/GPIO6_B3_d) AF5(UART1_RX/TS0_D0/GPIO5_B0_u) AF6(SPI0_RXD/UART4_RX/TS0_D7/GPIO5_B7_u) AG5(SPI0_CSn1/TS0_SYNC/GPIO5_C0_u) AG13(I2S_SDO2/GPIO6_A6_d) AH4(UART1_CTSn/TS0_D2/GPIO5_B2_u) AH12(I2S_SDO3/GPIO6_A7_d) AH13(I2S_SDO1/GPIO6_A5_d) E22(BS_JTAG_TRSTn) E23(BS_JTAG_TCK) E26(GPIO7_A4_u) E28(eDP_HOTPLUG/GPIO7_B3_d) F21(BS_JTAG_TDI) F22(BS_JTAG_TDO) F27(UART3_RTSn/GPIO7_B2_u) F28(ISP_PRELIGHTTRIG/SPI1_RXD/GPIO7_B6_d) G20(BS_JTAG_TMS) G23(PWM1/GPIO7_A1_d) G28(ISP_FLASHTRIGIN/EDPHDMI_CEC_T1/GPIO7_C0_u) H23(GPS_RFCLK/GPS_CLK_T1/UART3_CTSn/GPIO7_B1_u) H24(ISP_FLASHTRIGOUT/SPI1_CSN0/GPIO7_B5_u) H26(I2C5_SDA/EDPHDMI_I2C_SDA/GPIO7_C3_u) J21(GPS_SIG/HSADC_D1_T1/UART3_TX/GPIO7_B0_d) J24(I2C5_SCL/EDPHDMI_I2C_SCL/GPIO7_C4_u) Y11(APIO5_VDD)

### Library data of the parts
C174 C175 C177 C178 = CAP NP_Dup3: CAP,MLCC,100nF,+/-10%,X7R,6.3V,SMD0402
C176 = CAP NP_Dup3
R68 = RESISTOR_0_Dup3: as R33 on sheet 08
T5-T7 = TEST_0
U8 = MCU_RK3288_3

## Sheet 18.SchDoc
size 420 x 297 mm
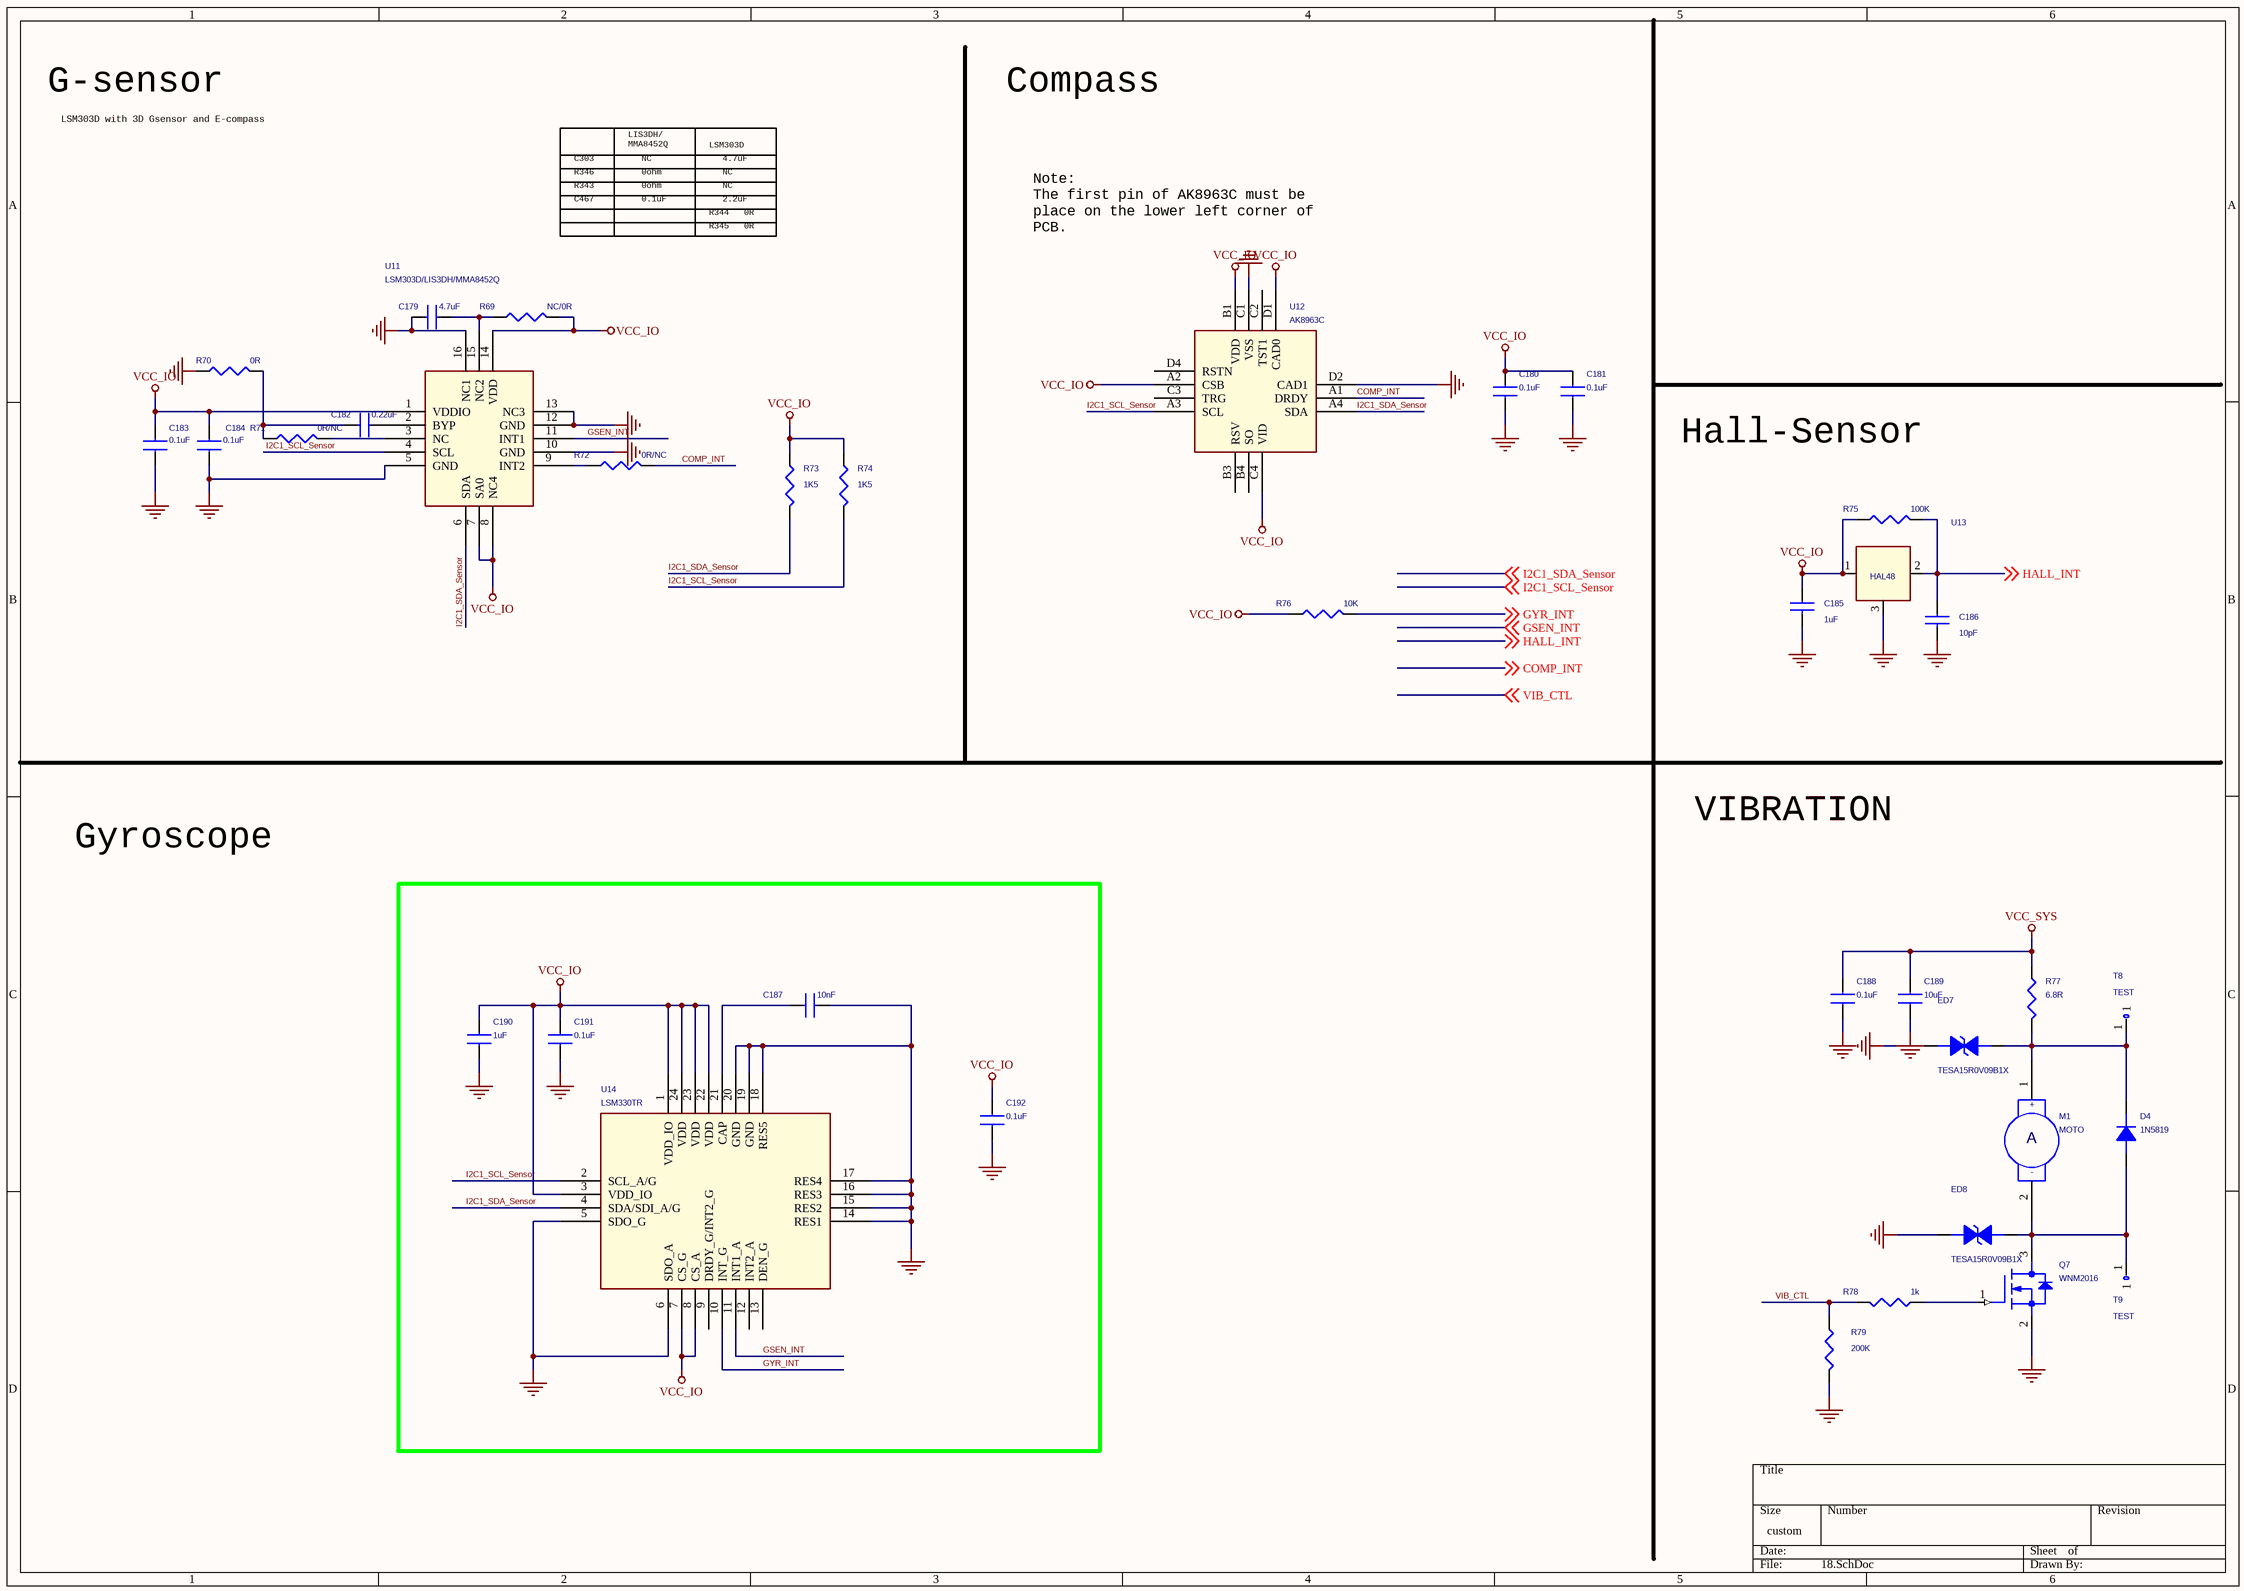
[diagram p18: 18.SchDoc]

### Parts
C179  4.7uF  [C0603]
C180  0.1uF  [C0603]
C181  0.1uF  [C0603]
C182  0.22uF  [C0603]
C183  0.1uF  [C0603]
C184  0.1uF  [C0603]
C185  1uF  [C0402]
C186  10pF  [C0402]
C187  10nF  [C0603]
C188  0.1uF  [C0603]
C189  10uF  [C0603]
C190  1uF  [C0603]
C191  0.1uF  [C0603]
C192  0.1uF  [C0603]
D4  1N5819  [SOD323]
ED7  TESA15R0V09B1X  [E0402N]
ED8  TESA15R0V09B1X  [E0402N]
M1  MOTO  [R1206]
Q7  WNM2016  [SOT23]
R69  NC/0R  [R0402]
R70  0R  [R0402]
R71  0R/NC  [R0402]
R72  0R/NC  [R0402]
R73  1K5  [r0402]
R74  1K5  [r0402]
R75  100K  [R0402]
R76  10K  [r0402]
R77  6.8R  [R0603]
R78  1k  [r0402]
R79  200K  [r0402]
T8  TEST  [TEST]
T9  TEST  [TEST]
U11  LSM303D/LIS3DH/MMA8452Q  [QFN16_COL]
U12  AK8963C  [AK8975B]
U13  HAL48  [SOT23]
U14  LSM330TR  [L3G4200D]

### Nets
GND: C179.2 C180.1 C181.1 C183.1 C184.1 C185.2 C186.2 C187.1 C188.1 C189.1 C190.1 C191.1 C192.1 ED7.1 ED8.1 Q7.2(SOURCE) R70.1 R79.2 U11.5(GND) U11.10(GND) U11.12(GND) U11.13(NC3) U11.16(NC1) U12.C1(VSS) U12.D2(CAD1) U13.3 U14.5(SDO_G) U14.6(SDO_A) U14.14(RES1) U14.15(RES2) U14.16(RES3) U14.17(RES4) U14.18(RES5) U14.19(GND) U14.20(GND)
VCC_IO: C180.2 C181.2 C183.2 C184.2 C185.1 C190.2 C191.2 C192.2 R69.2 R73.1 R74.1 R75.1 R76.1 U11.1(VDDIO) U11.7(SA0) U11.8(NC4) U11.14(VDD) U12.A2(CSB) U12.B1(VDD) U12.C4(VID) U12.D1(CAD0) U13.1 U14.1(VDD_IO) U14.3(VDD_IO) U14.7(CS_G) U14.8(CS_A) U14.22(VDD) U14.23(VDD) U14.24(VDD)
VCC_SYS: C188.2 C189.2 R77.1
COMP_INT: R72.2 U12.A1(DRDY) ; off-sheet COMP_INT
GSEN_INT: U11.11(INT1) U14.11(INT1_A) ; off-sheet GSEN_INT
GYR_INT: R76.2 U14.10(INT_G) ; off-sheet GYR_INT
HALL_INT: C186.1 R75.2 U13.2 ; off-sheet HALL_INT
I2C1_SCL_Sensor: R74.2 U11.4(SCL) U12.A3(SCL) U14.2(SCL_A/G) ; off-sheet I2C1_SCL_Sensor
I2C1_SDA_Sensor: R73.2 U11.6(SDA) U12.A4(SDA) U14.4(SDA/SDI_A/G) ; off-sheet I2C1_SDA_Sensor
VIB_CTL: R78.2 R79.1 ; off-sheet VIB_CTL
NetC179_1: C179.1 R69.1 U11.15(NC2)
NetC182_1: C182.1 U11.2(BYP)
NetC182_2: C182.2 R70.2 R71.1
NetC187_2: C187.2 U14.21(CAP)
NetD4_1: D4.1(A) ED8.2 M1.2(-) Q7.3(DRAIN) T9.1
NetD4_2: D4.2(K) ED7.2 M1.1(+) R77.2 T8.1
NetQ7_1: Q7.1(GATE) R78.1
NetR71_2: R71.2 U11.3(NC)
NetR72_1: R72.1 U11.9(INT2)

Not connected (* = marked no-connect by the designer): U12 B3(RSV) B4(SO) C2(TST1) C3(TRG) D4(RSTN); U14 9(DRDY_G/INT2_G) 12(INT2_A) 13(DEN_G)

### Notes on the sheet
- G-sensor
- LSM303D with 3D Gsensor and E-compass
- Compass
- R346
- R343
- C303
- LIS3DH/
  MMA8452Q
- 0ohm
- NC
- LSM303D
- 4.7uF
- C467
- 0.1uF
- R345   0R
- R344   0R
- 2.2uF
- Note:
  The first pin of AK8963C must be
  place on the lower left corner of
  PCB.
- Hall-Sensor
- Gyroscope
- VIBRATION
- (in symbol MOTOR SERVO) A

### Library data of the parts
C179 = CAP NP_Dup3: RoHS CHIP CAP 4.7uF +10/-10% X5R
C180 C181 = CAP NP_Dup3
C182 = CAP NP_Dup3: RoHS CHIP CAP 0.22uF +10/-10% X7R
C183 C184 = CAP NP_Dup3: RoHS CHIP CAP 0.1uF +10/-10% X7R
C185 C186 = CAP NP_Dup2: RoHS CHIP CAP 0.1uF +10/-10% X7R
C187 C191 C192 = CAP NP: CAP,MLCC,100nF,+/-10%,X7R,6.3V,SMD0402
C188 = CAP NP_Dup3: CAP,MLCC,100nF,+/-10%,X7R,6.3V,SMD0402
C189 = CAP NP_Dup3: CAP,MLCC,10uF,+/-10%,X5R,6.3V,SMD0805; MARK: 105
C190 = CAP NP: CAP,MLCC,10uF,+/-10%,X5R,6.3V,SMD0805
D4 = DIODE_Dup2: Diode,Schottky,1N5819HW,40V,1A,SOD-123
ED7 ED8 = TVS: ESD Component,5V,30P,SMD,0402
M1 = MOTOR SERVO: Vibration,R1206,SMT
Q7 = FET N MOS
R69 R71 R72 = RESISTOR_Dup1: NC/ROHS CHIP RES 0R 1/16W +/-5%
R70 = RESISTOR_Dup1: ROHS CHIP RES 0 Ohm 1/16W +/-5%
R73 R74 = RESISTOR_0_Dup3
R75 = RESISTOR_Dup1: ROHS CHIP RES 10K 1/16W 1%
R76 = RES 1B
R77 = RESISTOR_0: RES,thick film,43Ohm,+/-1%,1/8W,SMD0805
R78 R79 = RESISTOR_0_Dup3: RES,thick film,47KOhm,+/-5%,1/16W,SMD0402
T8 T9 = TEST_0
U11 = MMA8452Q_0: G_Sensor,LIS3DH/MMA8452Q,1.95V~3.6V,LGA-16,3X3X1.0,-40°C ~ +85°C
U12 = AK8975C_0: 3-axis Electronic Compoass,AK8963C,2.4V~3.6V,BGA14,-40°C~ +85  °C
U13 = NPN_0: Trans NPN,SS8050,25V,1500mA,10~60@Vce=1V,Ic=500mA, SOT-23
U14 = LSM330